# EAGLE schematic module_Rnx_ctrl (EAGLE 6.5.0)

## Sheet 1 of 21
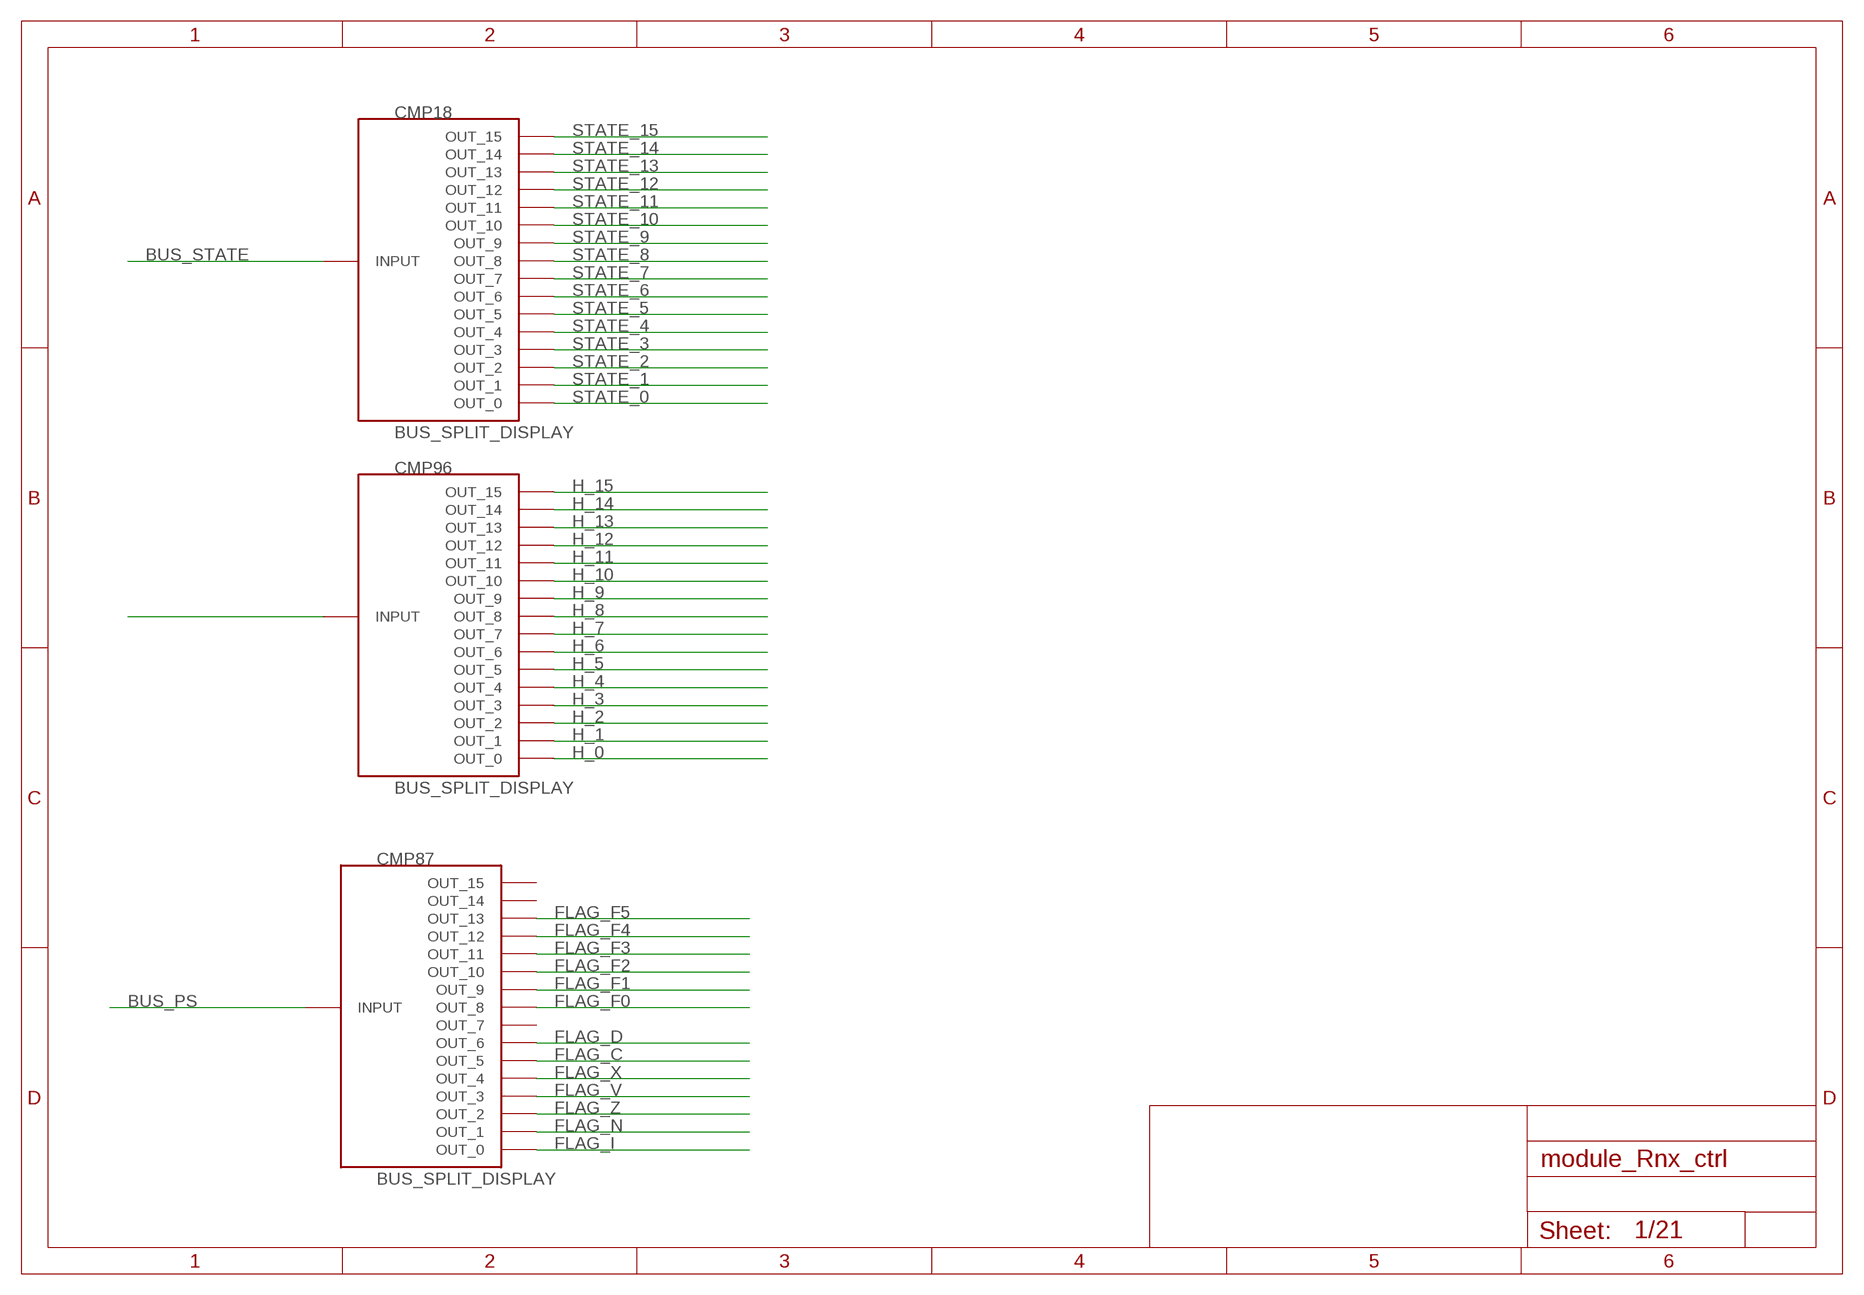
[diagram p0: schematic, sheet 1]

### Parts
CMP18  BUS_SPLIT_DISPLAY  [BUS_SPLIT_DISPLAY]
CMP87  BUS_SPLIT_DISPLAY  [BUS_SPLIT_DISPLAY]
CMP96  BUS_SPLIT_DISPLAY  [BUS_SPLIT_DISPLAY]

### Nets
BUS_H_D1: CMP96.INPUT
BUS_PS: CMP87.INPUT
BUS_STATE: CMP18.INPUT
FLAG_C: CMP87.P$6(OUT_5)
FLAG_D: CMP87.P$7(OUT_6) ; also sheet 8,19
FLAG_F0: CMP87.P$9(OUT_8) ; also sheet 7
FLAG_F1: CMP87.P$10(OUT_9)
FLAG_F2: CMP87.P$11(OUT_10)
FLAG_F3: CMP87.P$12(OUT_11)
FLAG_F4: CMP87.P$13(OUT_12)
FLAG_F5: CMP87.P$14(OUT_13)
FLAG_I: CMP87.P$1(OUT_0)
FLAG_N: CMP87.P$2(OUT_1)
FLAG_V: CMP87.P$4(OUT_3)
FLAG_X: CMP87.P$5(OUT_4)
FLAG_Z: CMP87.P$3(OUT_2)
H_0: CMP96.P$1(OUT_0) ; also sheet 6,7,17
H_1: CMP96.P$2(OUT_1) ; also sheet 6
H_2: CMP96.P$3(OUT_2)
H_3: CMP96.P$4(OUT_3)
H_4: CMP96.P$5(OUT_4)
H_5: CMP96.P$6(OUT_5)
H_6: CMP96.P$7(OUT_6)
H_7: CMP96.P$8(OUT_7)
H_8: CMP96.P$9(OUT_8)
H_9: CMP96.P$10(OUT_9)
H_10: CMP96.P$11(OUT_10)
H_11: CMP96.P$12(OUT_11)
H_12: CMP96.P$13(OUT_12)
H_13: CMP96.P$14(OUT_13)
H_14: CMP96.P$15(OUT_14)
H_15: CMP96.P$16(OUT_15)
STATE_0: CMP18.P$1(OUT_0) ; also sheet 7,9,11,14,15,16,19,20
STATE_1: CMP18.P$2(OUT_1) ; also sheet 11
STATE_2: CMP18.P$3(OUT_2)
STATE_3: CMP18.P$4(OUT_3) ; also sheet 8,12,19,20
STATE_4: CMP18.P$5(OUT_4) ; also sheet 7,11,15
STATE_5: CMP18.P$6(OUT_5) ; also sheet 11
STATE_6: CMP18.P$7(OUT_6) ; also sheet 7,14
STATE_7: CMP18.P$8(OUT_7) ; also sheet 14
STATE_8: CMP18.P$9(OUT_8) ; also sheet 15
STATE_9: CMP18.P$10(OUT_9)
STATE_10: CMP18.P$11(OUT_10) ; also sheet 7,17
STATE_11: CMP18.P$12(OUT_11) ; also sheet 4,9,12,15,20,21
STATE_12: CMP18.P$13(OUT_12) ; also sheet 7,8,12,15
STATE_13: CMP18.P$14(OUT_13) ; also sheet 4,9,19
STATE_14: CMP18.P$15(OUT_14) ; also sheet 15,17
STATE_15: CMP18.P$16(OUT_15) ; also sheet 14
Unconnected: CMP87.P$8(OUT_7) CMP87.P$15(OUT_14) CMP87.P$16(OUT_15)

## Sheet 2 of 21
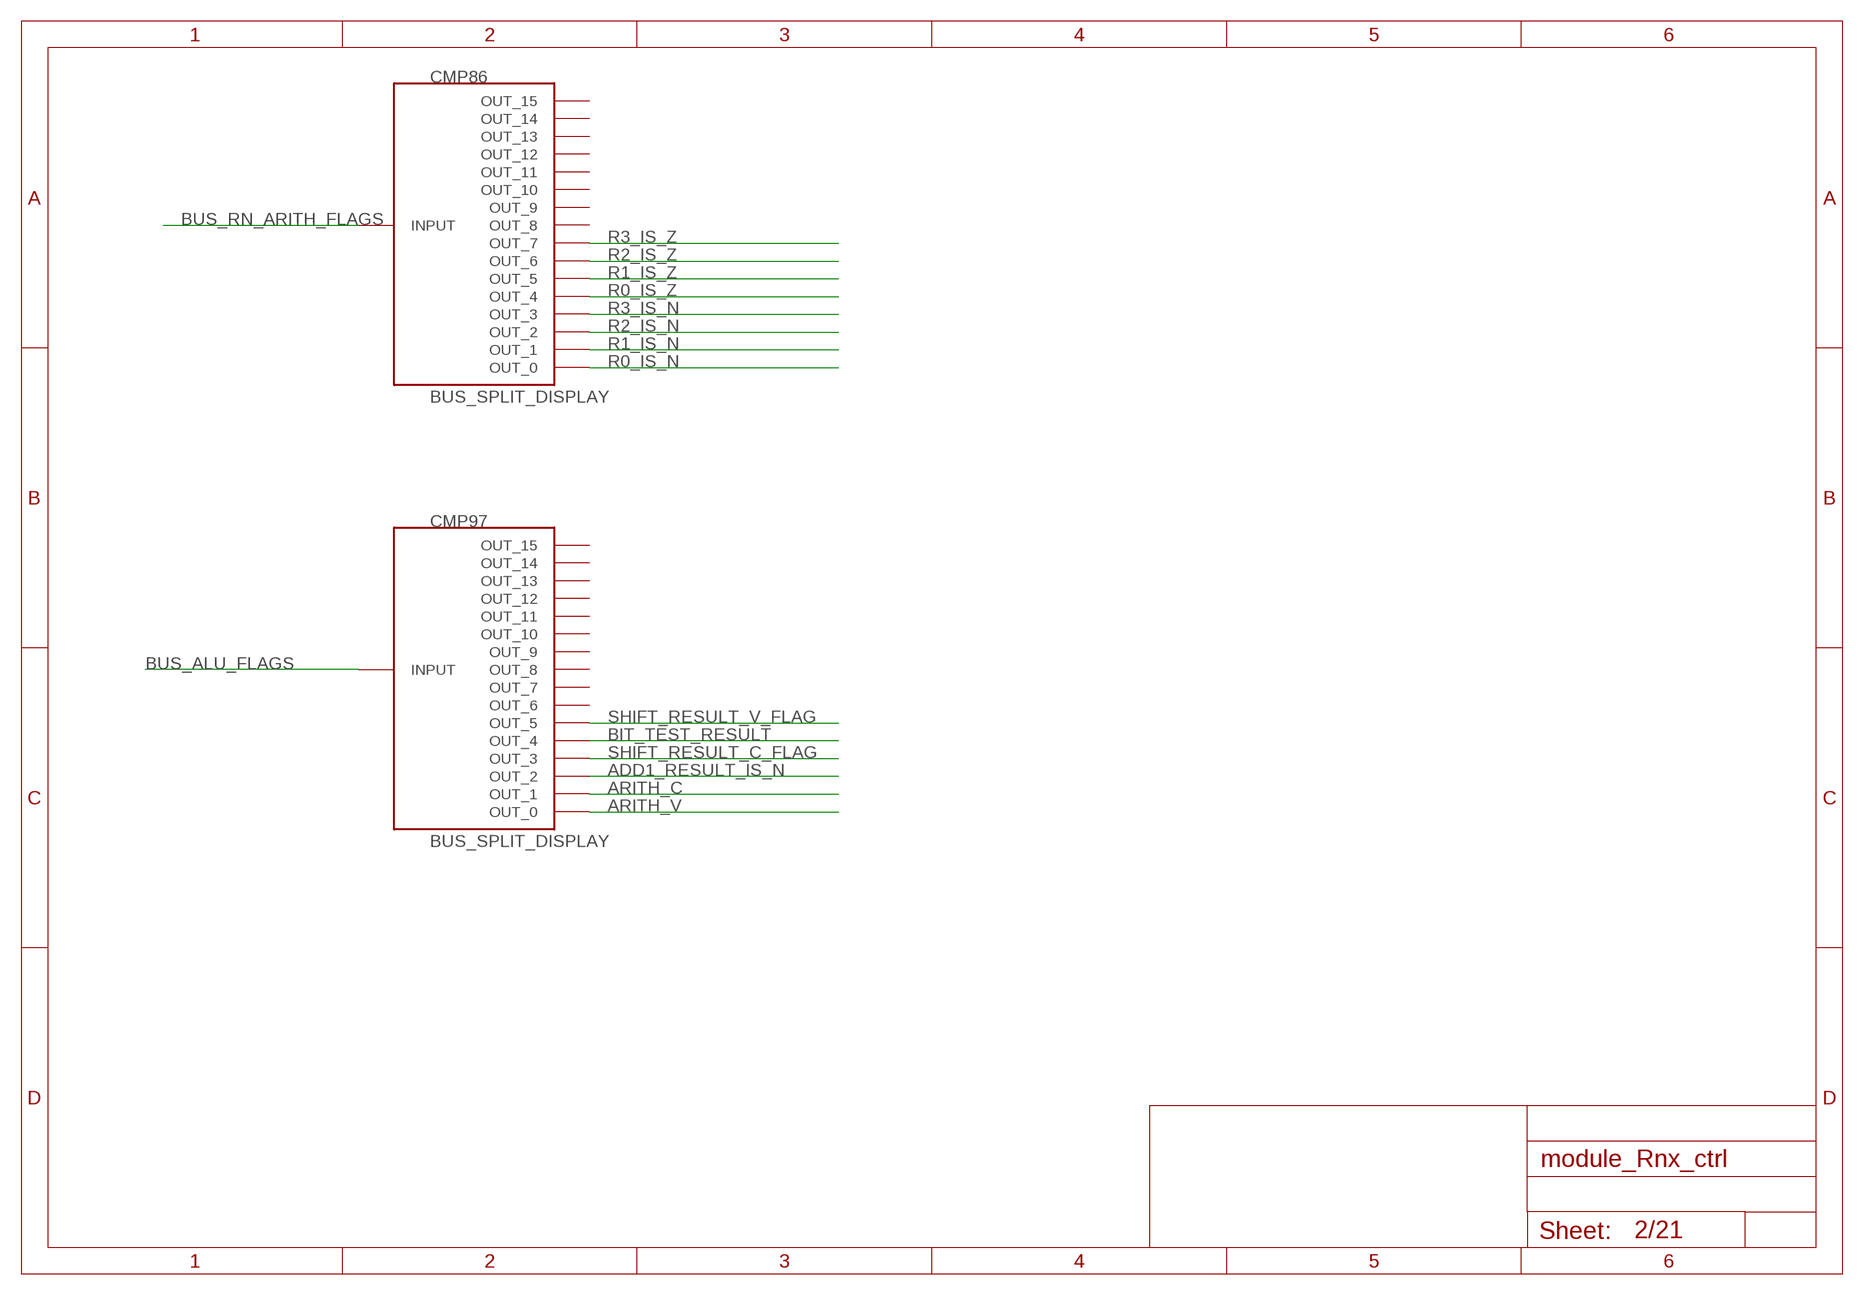
[diagram p1: schematic, sheet 2]

### Parts
CMP86  BUS_SPLIT_DISPLAY  [BUS_SPLIT_DISPLAY]
CMP97  BUS_SPLIT_DISPLAY  [BUS_SPLIT_DISPLAY]

### Nets
ADD1_RESULT_IS_N: CMP97.P$3(OUT_2) ; also sheet 17
ARITH_C: CMP97.P$2(OUT_1) ; also sheet 20,21
ARITH_V: CMP97.P$1(OUT_0)
BIT_TEST_RESULT: CMP97.P$5(OUT_4)
BUS_ALU_FLAGS: CMP97.INPUT
BUS_RN_ARITH_FLAGS: CMP86.INPUT
R0_IS_N: CMP86.P$1(OUT_0)
R0_IS_Z: CMP86.P$5(OUT_4)
R1_IS_N: CMP86.P$2(OUT_1) ; also sheet 8,17
R1_IS_Z: CMP86.P$6(OUT_5)
R2_IS_N: CMP86.P$3(OUT_2)
R2_IS_Z: CMP86.P$7(OUT_6)
R3_IS_N: CMP86.P$4(OUT_3)
R3_IS_Z: CMP86.P$8(OUT_7) ; also sheet 7
SHIFT_RESULT_C_FLAG: CMP97.P$4(OUT_3)
SHIFT_RESULT_V_FLAG: CMP97.P$6(OUT_5)
Unconnected: CMP86.P$9(OUT_8) CMP86.P$10(OUT_9) CMP86.P$11(OUT_10) CMP86.P$12(OUT_11) CMP86.P$13(OUT_12) CMP86.P$14(OUT_13) CMP86.P$15(OUT_14) CMP86.P$16(OUT_15) CMP97.P$7(OUT_6) CMP97.P$8(OUT_7) CMP97.P$9(OUT_8) CMP97.P$10(OUT_9) CMP97.P$11(OUT_10) CMP97.P$12(OUT_11) CMP97.P$13(OUT_12) CMP97.P$14(OUT_13) CMP97.P$15(OUT_14) CMP97.P$16(OUT_15)

## Sheet 3 of 21
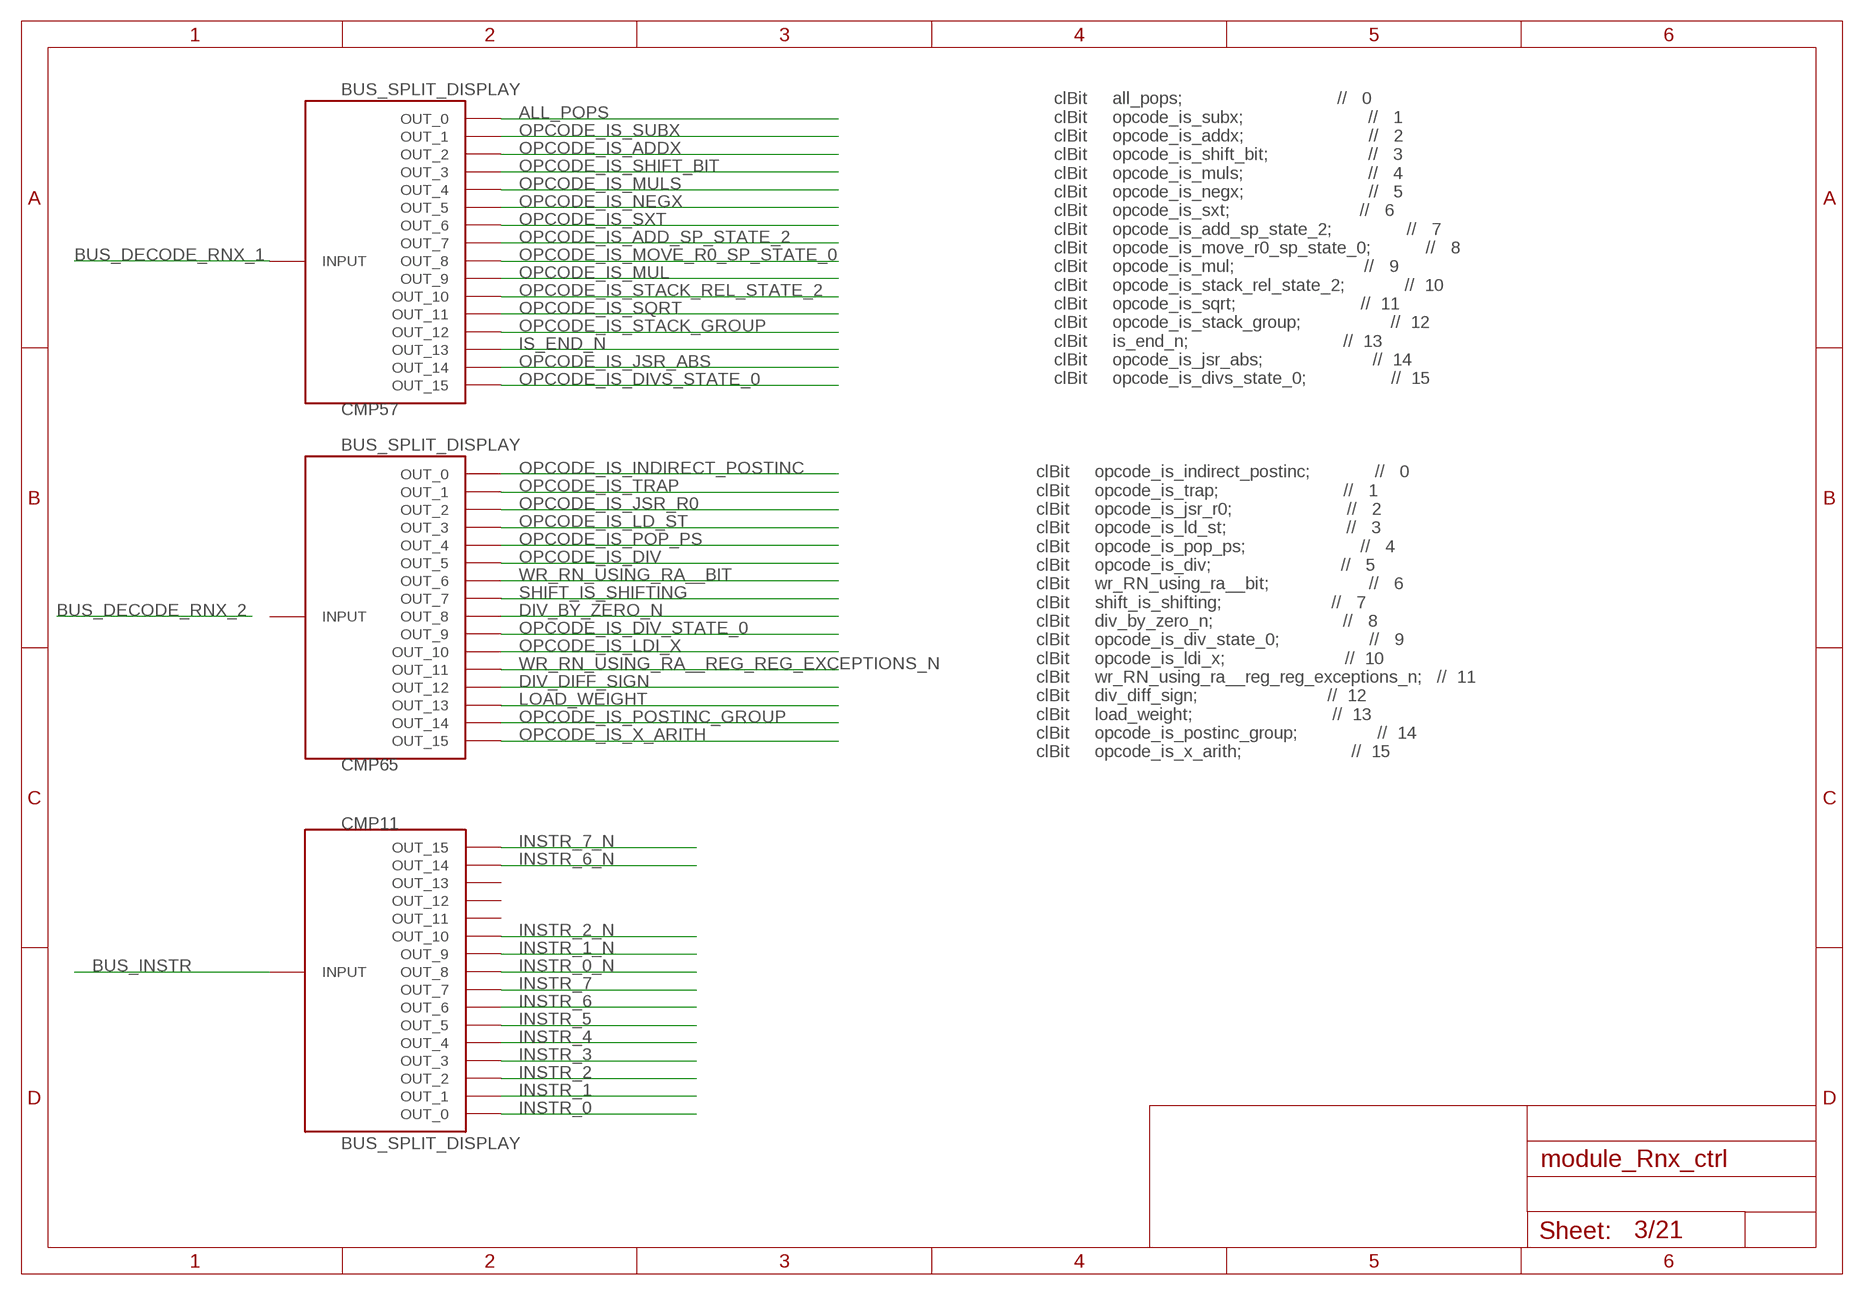
[diagram p2: schematic, sheet 3]

### Parts
CMP11  BUS_SPLIT_DISPLAY  [BUS_SPLIT_DISPLAY]
CMP57  BUS_SPLIT_DISPLAY  [BUS_SPLIT_DISPLAY]
CMP65  BUS_SPLIT_DISPLAY  [BUS_SPLIT_DISPLAY]

### Nets
ALL_POPS: CMP57.P$1(OUT_0) ; also sheet 15
BUS_DECODE_RNX_1: CMP57.INPUT
BUS_INSTR: CMP11.INPUT
DIV_BY_ZERO_N: CMP65.P$9(OUT_8) ; also sheet 19,20
DIV_DIFF_SIGN: CMP65.P$13(OUT_12) ; also sheet 19
INSTR_0: CMP11.P$1(OUT_0) ; also sheet 6,10
INSTR_0_N: CMP11.P$9(OUT_8) ; also sheet 10
INSTR_1: CMP11.P$2(OUT_1) ; also sheet 6,16,20
INSTR_1_N: CMP11.P$10(OUT_9) ; also sheet 15,19
INSTR_2: CMP11.P$3(OUT_2) ; also sheet 6,16
INSTR_2_N: CMP11.P$11(OUT_10) ; also sheet 16
INSTR_3: CMP11.P$4(OUT_3) ; also sheet 6
INSTR_4: CMP11.P$5(OUT_4)
INSTR_5: CMP11.P$6(OUT_5)
INSTR_6: CMP11.P$7(OUT_6)
INSTR_6_N: CMP11.P$15(OUT_14) ; also sheet 14
INSTR_7: CMP11.P$8(OUT_7) ; also sheet 14
INSTR_7_N: CMP11.P$16(OUT_15) ; also sheet 11,16
IS_END_N: CMP57.P$14(OUT_13) ; also sheet 14
LOAD_WEIGHT: CMP65.P$14(OUT_13) ; also sheet 18,19,20
OPCODE_IS_ADD_SP_STATE_2: CMP57.P$8(OUT_7) ; also sheet 14
OPCODE_IS_ADDX: CMP57.P$3(OUT_2) ; also sheet 9,12
OPCODE_IS_DIV: CMP65.P$6(OUT_5) ; also sheet 8,16
OPCODE_IS_DIV_STATE_0: CMP65.P$10(OUT_9) ; also sheet 19,20
OPCODE_IS_DIVS_STATE_0: CMP57.P$16(OUT_15) ; also sheet 8,12
OPCODE_IS_INDIRECT_POSTINC: CMP65.P$1(OUT_0) ; also sheet 10
OPCODE_IS_JSR_ABS: CMP57.P$15(OUT_14) ; also sheet 14
OPCODE_IS_JSR_R0: CMP65.P$3(OUT_2) ; also sheet 14
OPCODE_IS_LD_ST: CMP65.P$4(OUT_3) ; also sheet 11,16
OPCODE_IS_LDI_X: CMP65.P$11(OUT_10) ; also sheet 11
OPCODE_IS_MOVE_R0_SP_STATE_0: CMP57.P$9(OUT_8) ; also sheet 14,18
OPCODE_IS_MUL: CMP57.P$10(OUT_9) ; also sheet 9,16,19,20
OPCODE_IS_MULS: CMP57.P$5(OUT_4) ; also sheet 12
OPCODE_IS_NEGX: CMP57.P$6(OUT_5) ; also sheet 12
OPCODE_IS_POP_PS: CMP65.P$5(OUT_4) ; also sheet 16
OPCODE_IS_POSTINC_GROUP: CMP65.P$15(OUT_14) ; also sheet 16
OPCODE_IS_SHIFT_BIT: CMP57.P$4(OUT_3) ; also sheet 6,12,16
OPCODE_IS_SQRT: CMP57.P$12(OUT_11) ; also sheet 7,9,12,16,20
OPCODE_IS_STACK_GROUP: CMP57.P$13(OUT_12) ; also sheet 14
OPCODE_IS_STACK_REL_STATE_2: CMP57.P$11(OUT_10) ; also sheet 14
OPCODE_IS_SUBX: CMP57.P$2(OUT_1) ; also sheet 9,12
OPCODE_IS_SXT: CMP57.P$7(OUT_6) ; also sheet 4,16
OPCODE_IS_TRAP: CMP65.P$2(OUT_1) ; also sheet 14
OPCODE_IS_X_ARITH: CMP65.P$16(OUT_15) ; also sheet 16,18
SHIFT_IS_SHIFTING: CMP65.P$8(OUT_7) ; also sheet 11
WR_RN_USING_RA__BIT: CMP65.P$7(OUT_6) ; also sheet 11
WR_RN_USING_RA__REG_REG_EXCEPTIONS_N: CMP65.P$12(OUT_11) ; also sheet 11
Unconnected: CMP11.P$12(OUT_11) CMP11.P$13(OUT_12) CMP11.P$14(OUT_13) CMP65.INPUT

### Notes on the sheet
- clBit     all_pops;                               //   0
      clBit     opcode_is_subx;                         //   1
      clBit     opcode_is_addx;                         //   2
      clBit     opcode_is_shift_bit;                    //   3
      clBit     opcode_is_muls;                         //   4
      clBit     opcode_is_negx;                         //   5
      clBit     opcode_is_sxt;                          //   6
      clBit     opcode_is_add_sp_state_2;               //   7
      clBit     opcode_is_move_r0_sp_state_0;           //   8
      clBit     opcode_is_mul;                          //   9
      clBit     opcode_is_stack_rel_state_2;            //  10
      clBit     opcode_is_sqrt;                         //  11
      clBit     opcode_is_stack_group;                  //  12
      clBit     is_end_n;                               //  13
      clBit     opcode_is_jsr_abs;                      //  14
      clBit     opcode_is_divs_state_0;                 //  15
- clBit     opcode_is_indirect_postinc;             //   0
      clBit     opcode_is_trap;                         //   1
      clBit     opcode_is_jsr_r0;                       //   2
      clBit     opcode_is_ld_st;                        //   3
      clBit     opcode_is_pop_ps;                       //   4
      clBit     opcode_is_div;                          //   5
      clBit     wr_RN_using_ra__bit;                    //   6
      clBit     shift_is_shifting;                      //   7
      clBit     div_by_zero_n;                          //   8
      clBit     opcode_is_div_state_0;                  //   9
      clBit     opcode_is_ldi_x;                        //  10
      clBit     wr_RN_using_ra__reg_reg_exceptions_n;   //  11
      clBit     div_diff_sign;                          //  12
      clBit     load_weight;                            //  13
      clBit     opcode_is_postinc_group;                //  14
      clBit     opcode_is_x_arith;                      //  15

## Sheet 4 of 21
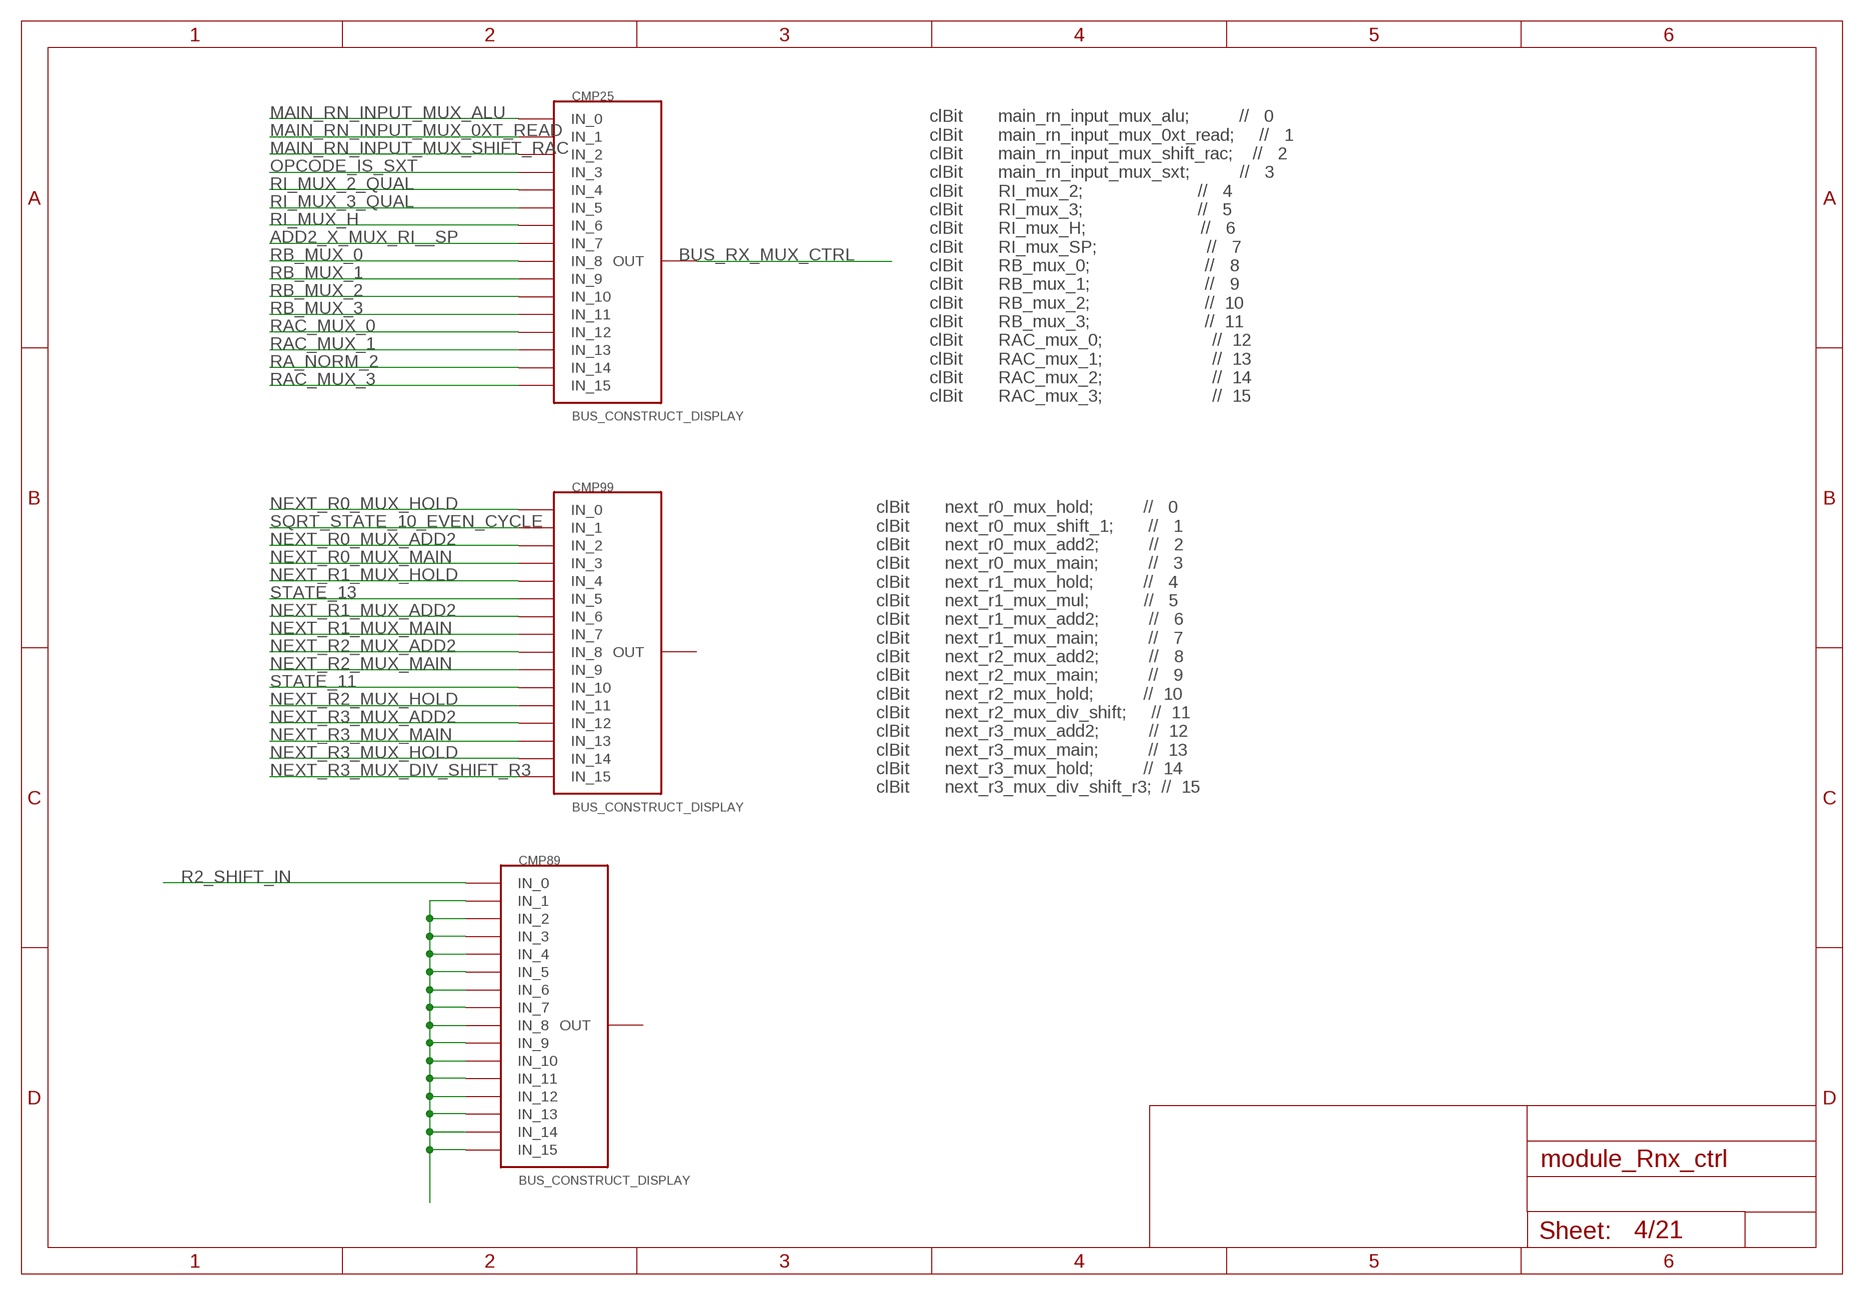
[diagram p3: schematic, sheet 4]

### Parts
CMP25  BUS_CONSTRUCT_DISPLAY  [BUS_SPLIT_DISPLAY]
CMP89  BUS_CONSTRUCT_DISPLAY  [BUS_SPLIT_DISPLAY]
CMP99  BUS_CONSTRUCT_DISPLAY  [BUS_SPLIT_DISPLAY]

### Nets
ADD2_X_MUX_RI__SP: CMP25.P$8(IN_7) ; also sheet 5,14,15
BUS_RX_MUX_CTRL: CMP25.INPUT(OUT)
MAIN_RN_INPUT_MUX_0XT_READ: CMP25.P$2(IN_1) ; also sheet 16
MAIN_RN_INPUT_MUX_ALU: CMP25.P$1(IN_0) ; also sheet 16
MAIN_RN_INPUT_MUX_SHIFT_RAC: CMP25.P$3(IN_2) ; also sheet 16
N$3: CMP89.P$2(IN_1) CMP89.P$3(IN_2) CMP89.P$4(IN_3) CMP89.P$5(IN_4) CMP89.P$6(IN_5) CMP89.P$7(IN_6) CMP89.P$8(IN_7) CMP89.P$9(IN_8) CMP89.P$10(IN_9) CMP89.P$11(IN_10) CMP89.P$12(IN_11) CMP89.P$13(IN_12) CMP89.P$14(IN_13) CMP89.P$15(IN_14) CMP89.P$16(IN_15)
NEXT_R0_MUX_ADD2: CMP99.P$3(IN_2) ; also sheet 18
NEXT_R0_MUX_HOLD: CMP99.P$1(IN_0) ; also sheet 18
NEXT_R0_MUX_MAIN: CMP99.P$4(IN_3) ; also sheet 18
NEXT_R1_MUX_ADD2: CMP99.P$7(IN_6) ; also sheet 18,19
NEXT_R1_MUX_HOLD: CMP99.P$5(IN_4) ; also sheet 19
NEXT_R1_MUX_MAIN: CMP99.P$8(IN_7) ; also sheet 18,19
NEXT_R2_MUX_ADD2: CMP99.P$9(IN_8) ; also sheet 19,20
NEXT_R2_MUX_HOLD: CMP99.P$12(IN_11) ; also sheet 20
NEXT_R2_MUX_MAIN: CMP99.P$10(IN_9) ; also sheet 19,20
NEXT_R3_MUX_ADD2: CMP99.P$13(IN_12) ; also sheet 21
NEXT_R3_MUX_DIV_SHIFT_R3: CMP99.P$16(IN_15) ; also sheet 21
NEXT_R3_MUX_HOLD: CMP99.P$15(IN_14) ; also sheet 21
NEXT_R3_MUX_MAIN: CMP99.P$14(IN_13) ; also sheet 20,21
OPCODE_IS_SXT: CMP25.P$4(IN_3) ; also sheet 3,16
R2_SHIFT_IN: CMP89.P$1(IN_0) ; also sheet 21
RA_NORM_2: CMP25.P$15(IN_14) ; also sheet 6,19
RAC_MUX_0: CMP25.P$13(IN_12) ; also sheet 10,18
RAC_MUX_1: CMP25.P$14(IN_13) ; also sheet 10,18
RAC_MUX_3: CMP25.P$16(IN_15) ; also sheet 10,20
RB_MUX_0: CMP25.P$9(IN_8) ; also sheet 13
RB_MUX_1: CMP25.P$10(IN_9) ; also sheet 13
RB_MUX_2: CMP25.P$11(IN_10) ; also sheet 13
RB_MUX_3: CMP25.P$12(IN_11) ; also sheet 13
RI_MUX_2_QUAL: CMP25.P$5(IN_4) ; also sheet 15
RI_MUX_3_QUAL: CMP25.P$6(IN_5) ; also sheet 16
RI_MUX_H: CMP25.P$7(IN_6) ; also sheet 15
SQRT_STATE_10_EVEN_CYCLE: CMP99.P$2(IN_1) ; also sheet 7,18,21
STATE_11: CMP99.P$11(IN_10) ; also sheet 1,9,12,15,20,21
STATE_13: CMP99.P$6(IN_5) ; also sheet 1,9,19
Unconnected: CMP89.INPUT(OUT) CMP99.INPUT(OUT)

### Notes on the sheet
- clBit       main_rn_input_mux_alu;          //   0
      clBit       main_rn_input_mux_0xt_read;     //   1
      clBit       main_rn_input_mux_shift_rac;    //   2
      clBit       main_rn_input_mux_sxt;          //   3
      clBit       RI_mux_2;                       //   4
      clBit       RI_mux_3;                       //   5
      clBit       RI_mux_H;                       //   6
      clBit       RI_mux_SP;                      //   7
      clBit       RB_mux_0;                       //   8
      clBit       RB_mux_1;                       //   9
      clBit       RB_mux_2;                       //  10
      clBit       RB_mux_3;                       //  11
      clBit       RAC_mux_0;                      //  12
      clBit       RAC_mux_1;                      //  13
      clBit       RAC_mux_2;                      //  14
      clBit       RAC_mux_3;                      //  15
- clBit       next_r0_mux_hold;          //   0
      clBit       next_r0_mux_shift_1;       //   1
      clBit       next_r0_mux_add2;          //   2
      clBit       next_r0_mux_main;          //   3
      clBit       next_r1_mux_hold;          //   4
      clBit       next_r1_mux_mul;           //   5
      clBit       next_r1_mux_add2;          //   6
      clBit       next_r1_mux_main;          //   7
      clBit       next_r2_mux_add2;          //   8
      clBit       next_r2_mux_main;          //   9
      clBit       next_r2_mux_hold;          //  10
      clBit       next_r2_mux_div_shift;     //  11
      clBit       next_r3_mux_add2;          //  12
      clBit       next_r3_mux_main;          //  13
      clBit       next_r3_mux_hold;          //  14
      clBit       next_r3_mux_div_shift_r3;  //  15

## Sheet 5 of 21
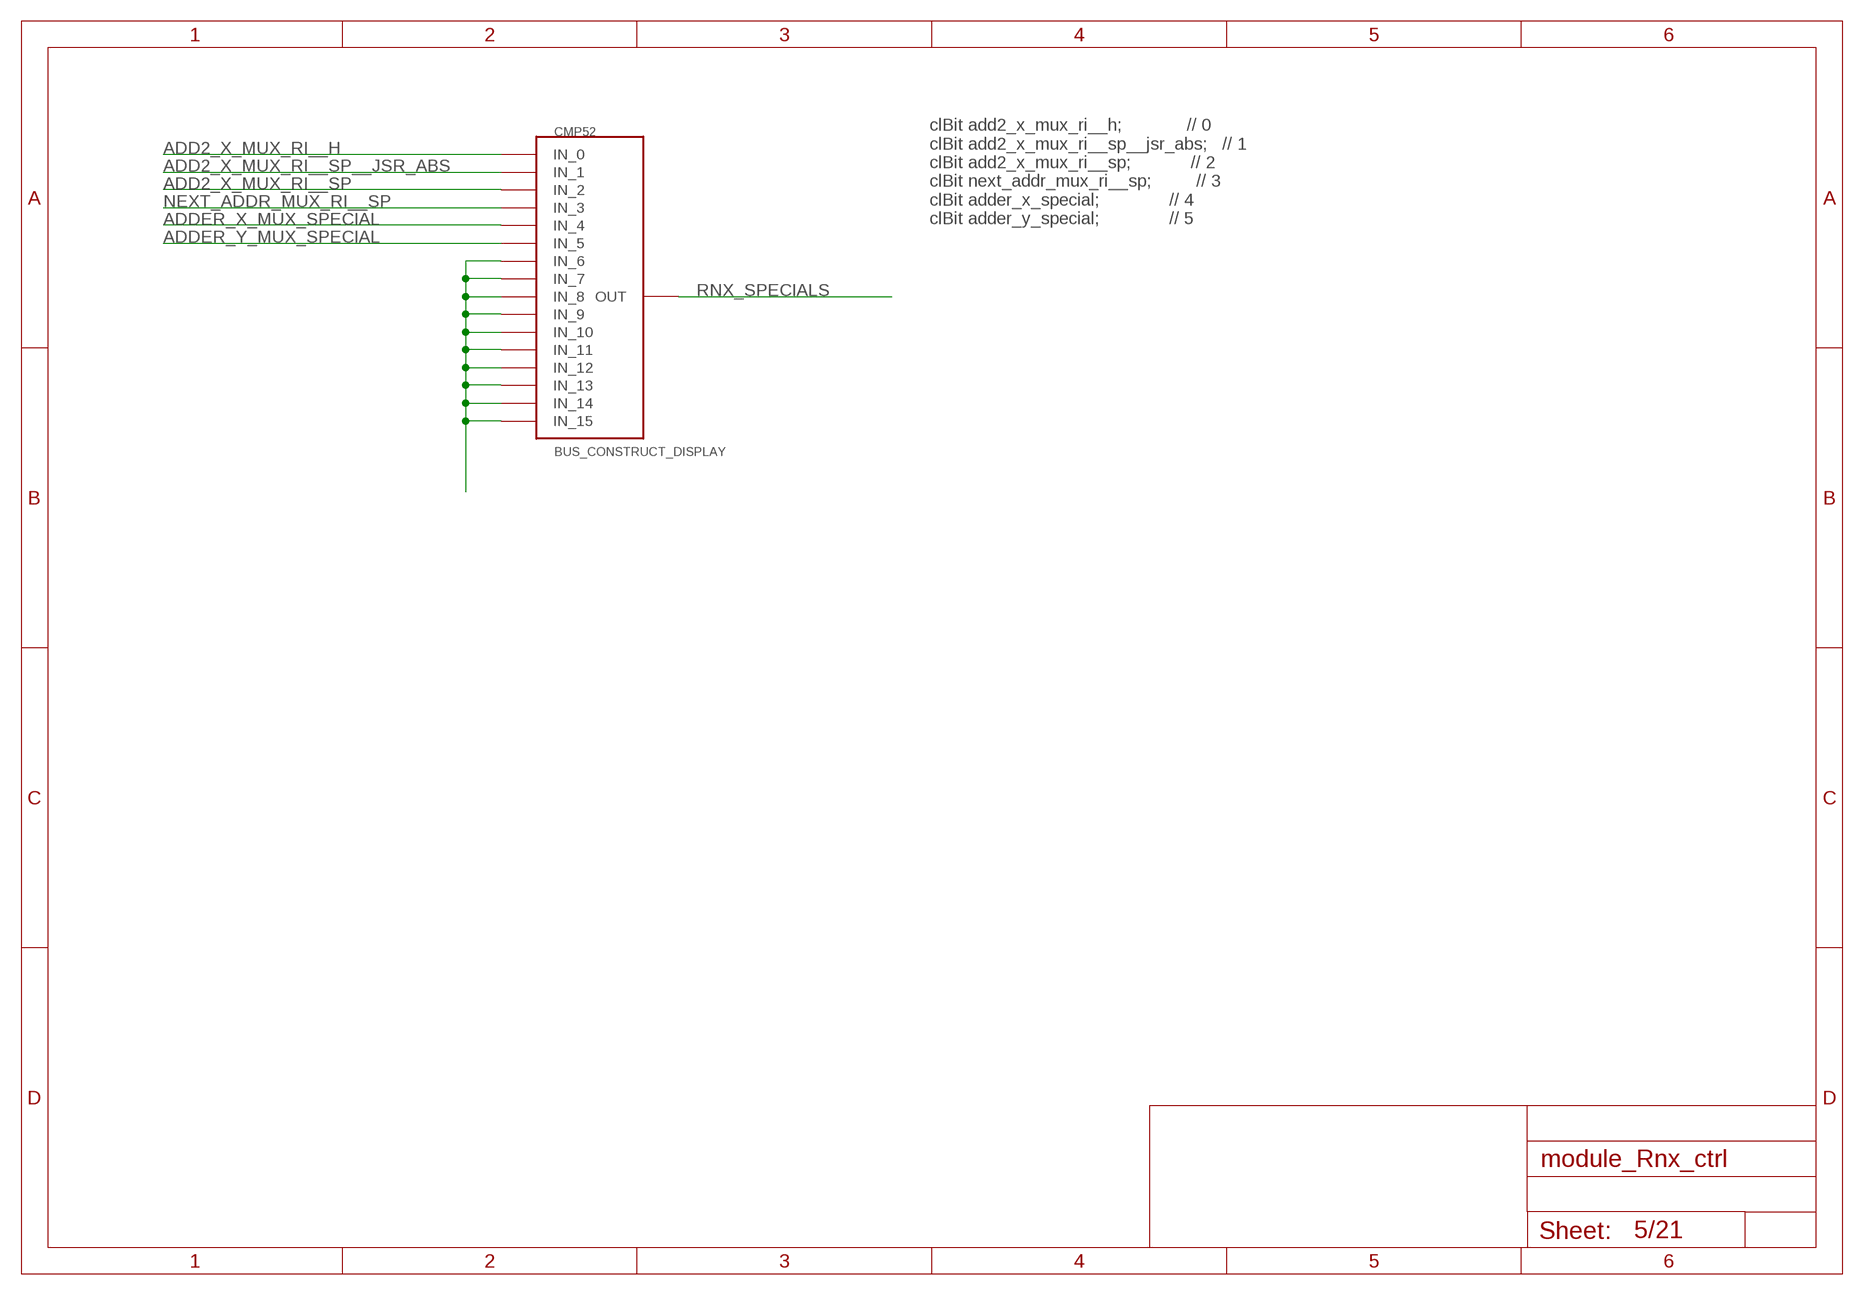
[diagram p4: schematic, sheet 5]

### Parts
CMP52  BUS_CONSTRUCT_DISPLAY  [BUS_SPLIT_DISPLAY]

### Nets
ADD2_X_MUX_RI__H: CMP52.P$1(IN_0) ; also sheet 14,15
ADD2_X_MUX_RI__SP: CMP52.P$3(IN_2) ; also sheet 4,14,15
ADD2_X_MUX_RI__SP__JSR_ABS: CMP52.P$2(IN_1) ; also sheet 14
ADDER_X_MUX_SPECIAL: CMP52.P$5(IN_4) ; also sheet 9,10
ADDER_Y_MUX_SPECIAL: CMP52.P$6(IN_5) ; also sheet 12
N$2: CMP52.P$7(IN_6) CMP52.P$8(IN_7) CMP52.P$9(IN_8) CMP52.P$10(IN_9) CMP52.P$11(IN_10) CMP52.P$12(IN_11) CMP52.P$13(IN_12) CMP52.P$14(IN_13) CMP52.P$15(IN_14) CMP52.P$16(IN_15)
NEXT_ADDR_MUX_RI__SP: CMP52.P$4(IN_3) ; also sheet 15
RNX_SPECIALS: CMP52.INPUT(OUT)

### Notes on the sheet
- clBit add2_x_mux_ri__h;             // 0
      clBit add2_x_mux_ri__sp__jsr_abs;   // 1
      clBit add2_x_mux_ri__sp;            // 2
      clBit next_addr_mux_ri__sp;         // 3
      clBit adder_x_special;              // 4
      clBit adder_y_special;              // 5

## Sheet 6 of 21
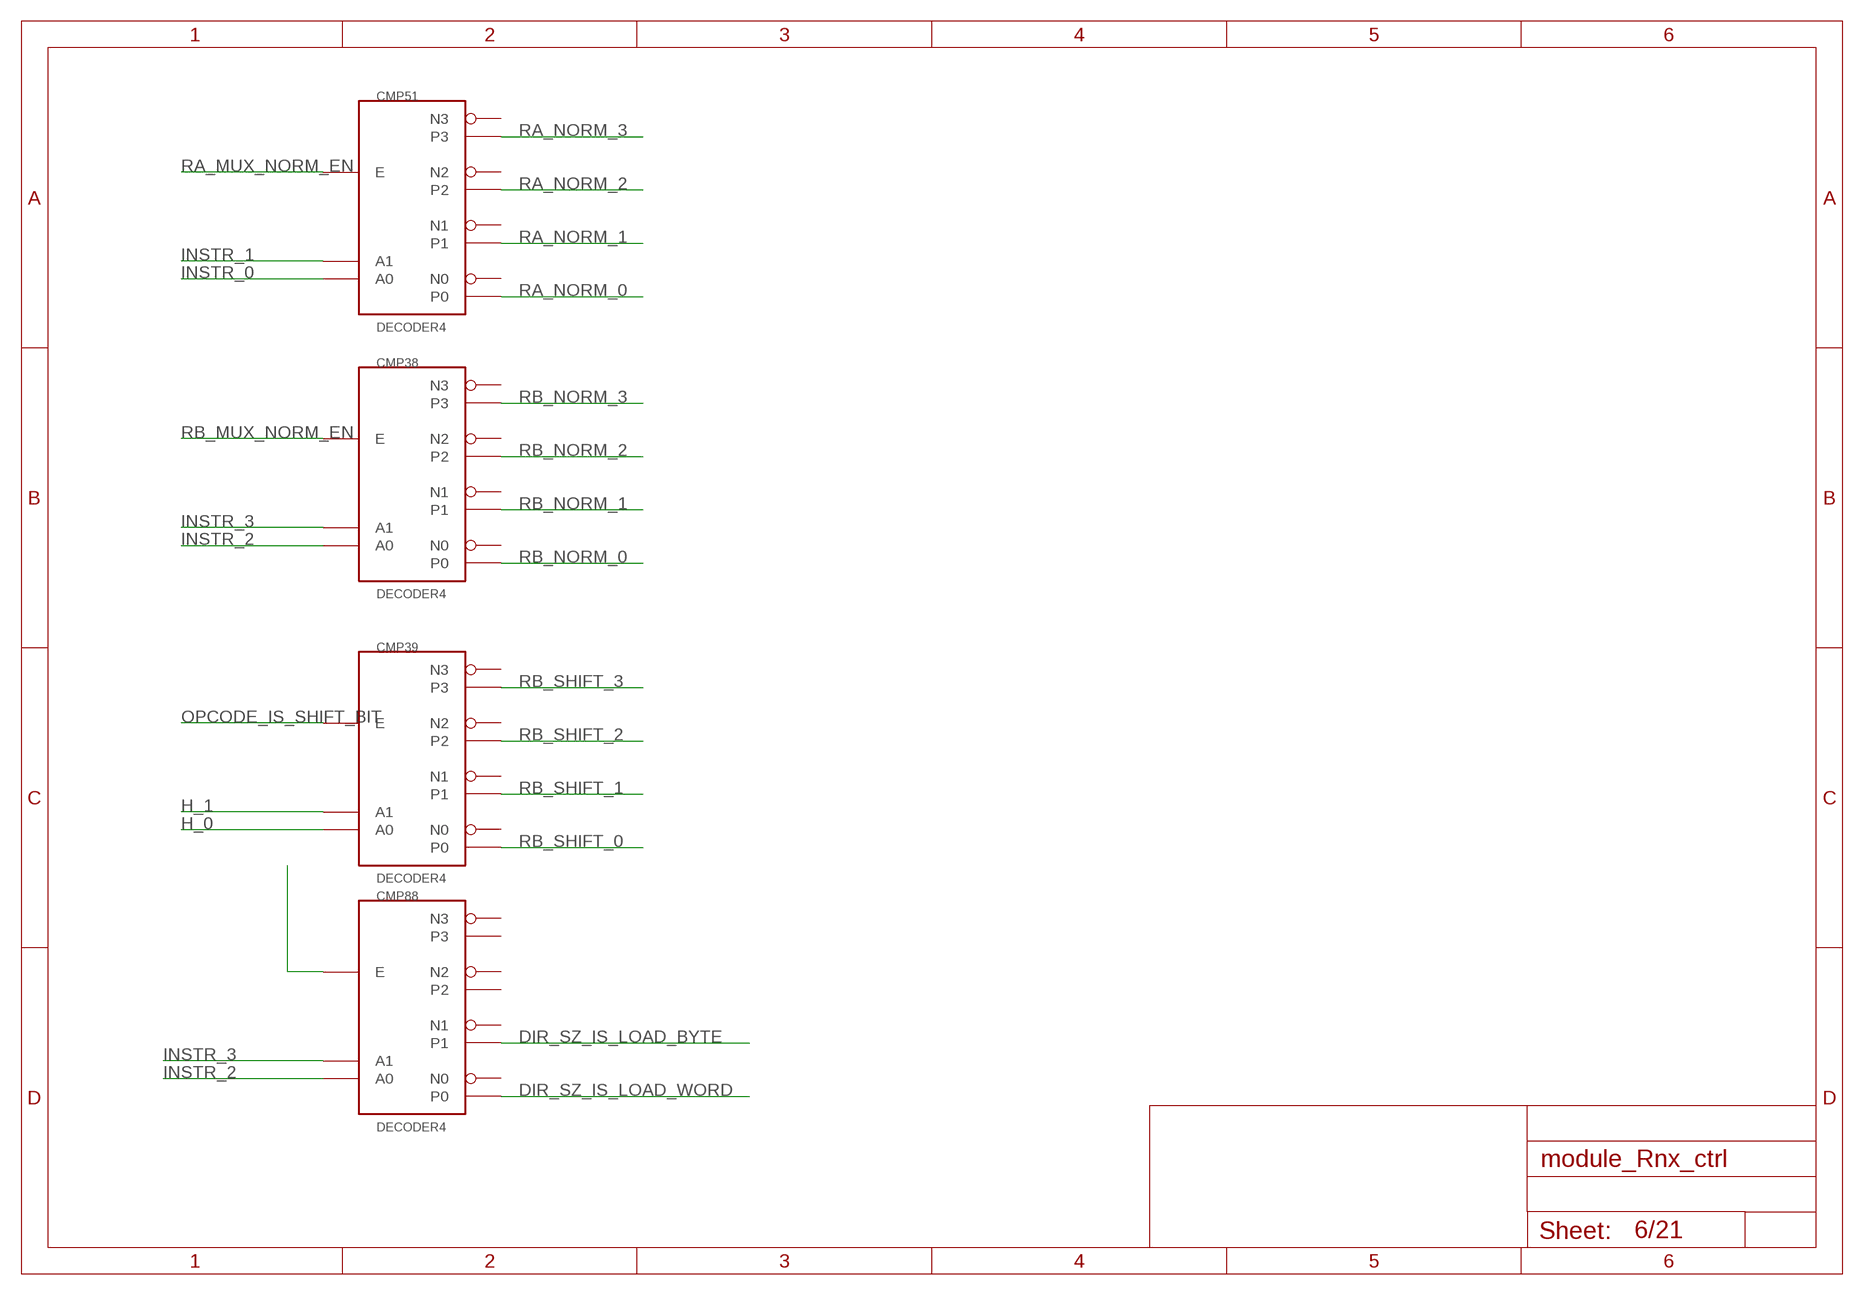
[diagram p5: schematic, sheet 6]

### Parts
CMP38  DECODER4  [DECODER4]
CMP39  DECODER4  [DECODER4]
CMP51  DECODER4  [DECODER4]
CMP88  DECODER4  [DECODER4]

### Nets
DIR_SZ_IS_LOAD_BYTE: CMP88.P1 ; also sheet 16
DIR_SZ_IS_LOAD_WORD: CMP88.P0 ; also sheet 16
H_0: CMP39.A0 ; also sheet 1,7,17
H_1: CMP39.A1 ; also sheet 1
INSTR_0: CMP51.A0 ; also sheet 3,10
INSTR_1: CMP51.A1 ; also sheet 3,16,20
INSTR_2: CMP38.A0 CMP88.A0 ; also sheet 3,16
INSTR_3: CMP38.A1 CMP88.A1 ; also sheet 3
N$1: CMP88.E
OPCODE_IS_SHIFT_BIT: CMP39.E ; also sheet 3,12,16
RA_MUX_NORM_EN: CMP51.E ; also sheet 10
RA_NORM_0: CMP51.P0 ; also sheet 10
RA_NORM_1: CMP51.P1 ; also sheet 10
RA_NORM_2: CMP51.P2 ; also sheet 4,19
RA_NORM_3: CMP51.P3 ; also sheet 10
RB_MUX_NORM_EN: CMP38.E ; also sheet 12
RB_NORM_0: CMP38.P0 ; also sheet 13
RB_NORM_1: CMP38.P1 ; also sheet 13
RB_NORM_2: CMP38.P2 ; also sheet 13
RB_NORM_3: CMP38.P3 ; also sheet 13
RB_SHIFT_0: CMP39.P0 ; also sheet 13
RB_SHIFT_1: CMP39.P1 ; also sheet 13
RB_SHIFT_2: CMP39.P2 ; also sheet 13
RB_SHIFT_3: CMP39.P3 ; also sheet 13
Unconnected: CMP38.N0 CMP38.N1 CMP38.N2 CMP38.N3 CMP39.N0 CMP39.N1 CMP39.N2 CMP39.N3 CMP51.N0 CMP51.N1 CMP51.N2 CMP51.N3 CMP88.N0 CMP88.N1 CMP88.N2 CMP88.N3 CMP88.P2 CMP88.P3

## Sheet 7 of 21
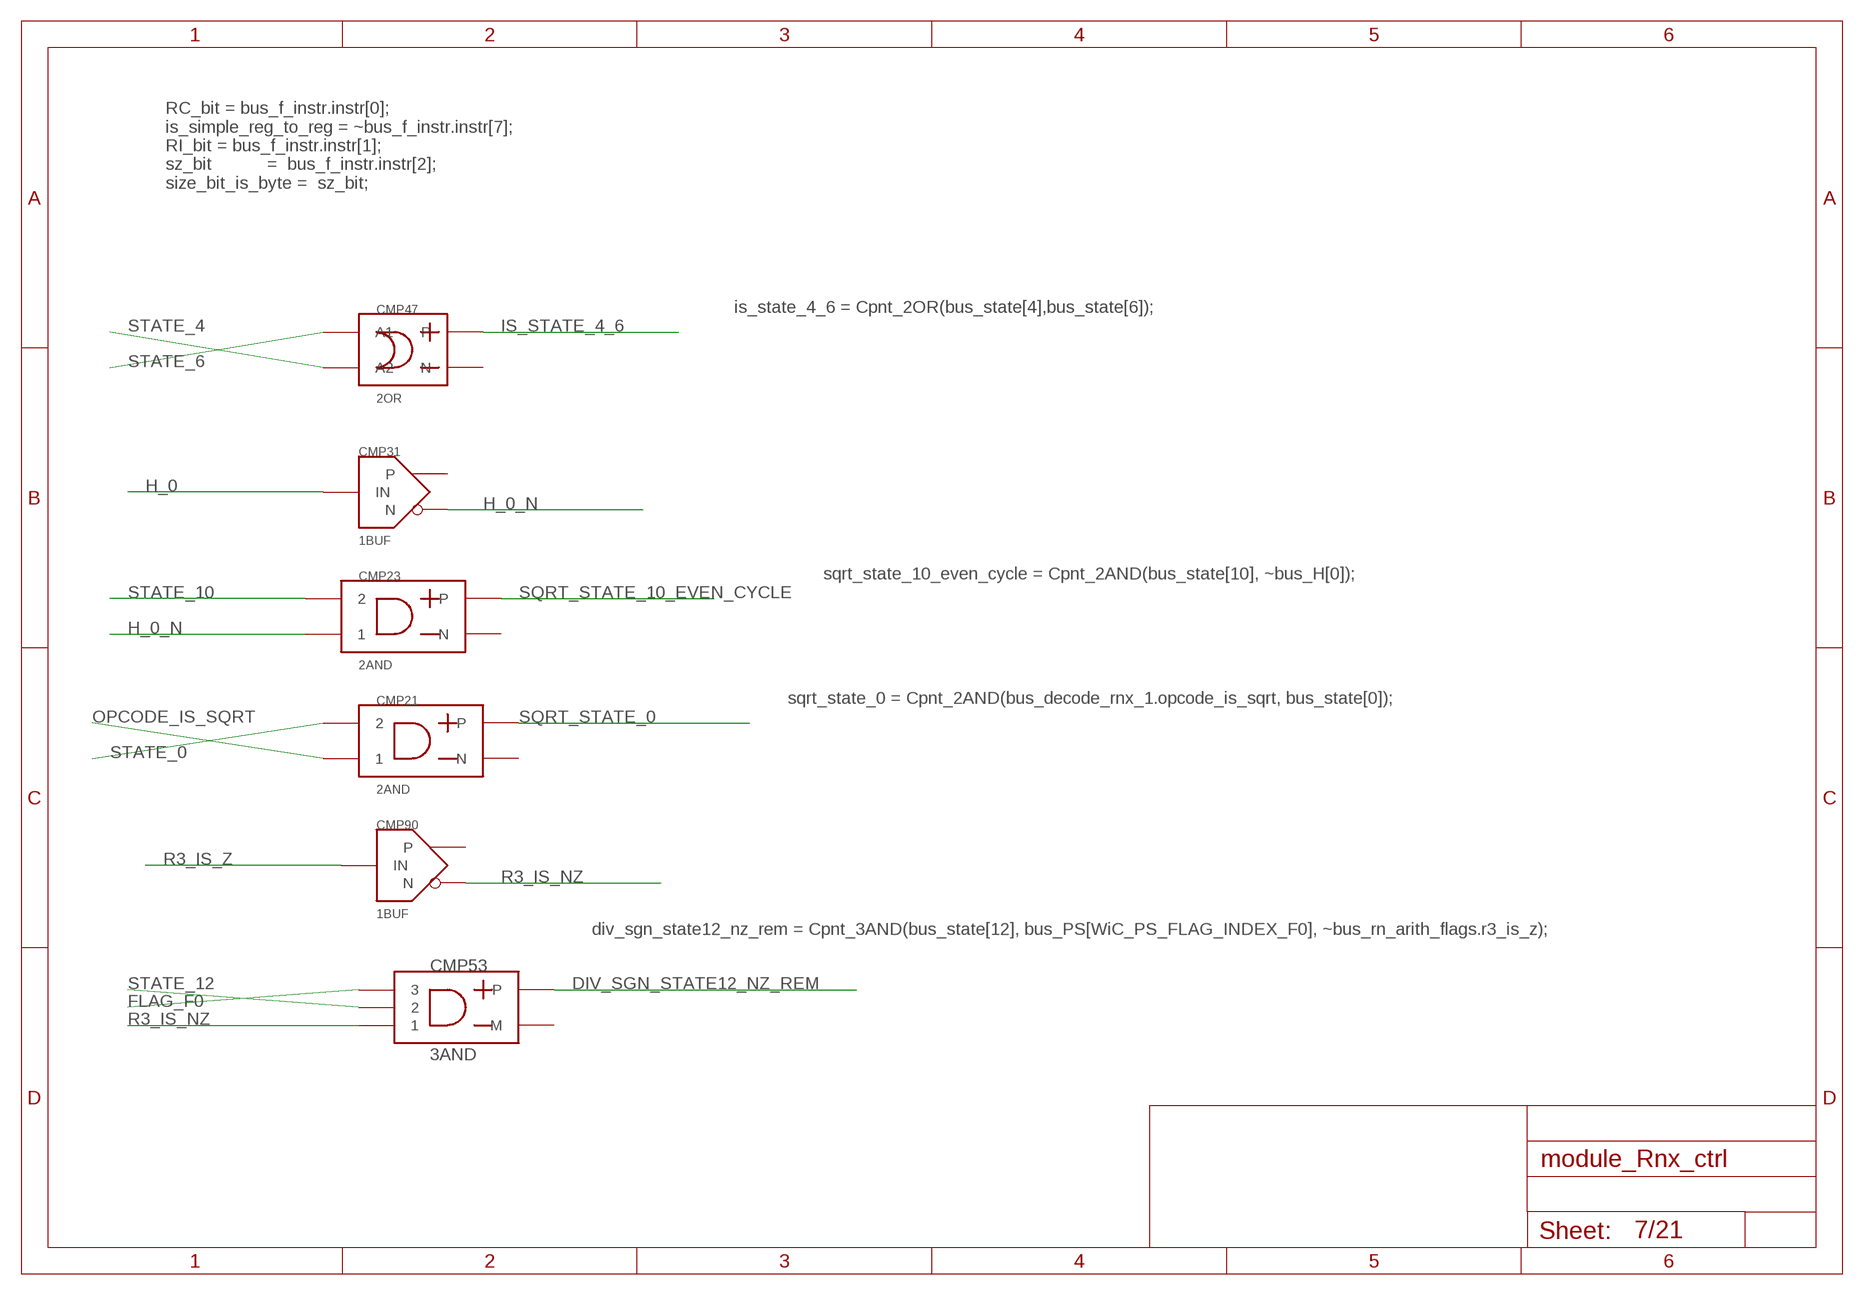
[diagram p6: schematic, sheet 7]

### Parts
CMP21  2AND  [2AND]
CMP23  2AND  [2AND]
CMP31  1BUF  [1BUF]
CMP47  2OR  [2OR]
CMP53  3AND  [3AND]
CMP90  1BUF  [1BUF]

### Nets
DIV_SGN_STATE12_NZ_REM: CMP53.OUT_P(P) ; also sheet 19,20
FLAG_F0: CMP53.P$3 ; also sheet 1
H_0: CMP31.IN ; also sheet 1,6,17
H_0_N: CMP23.P$1 CMP31.N
IS_STATE_4_6: CMP47.OUT_P(P) ; also sheet 14,16
OPCODE_IS_SQRT: CMP21.P$1 ; also sheet 3,9,12,16,20
R3_IS_NZ: CMP53.P$1 CMP90.N
R3_IS_Z: CMP90.IN ; also sheet 2
SQRT_STATE_0: CMP21.OUT_P(P) ; also sheet 18
SQRT_STATE_10_EVEN_CYCLE: CMP23.OUT_P(P) ; also sheet 4,18,21
STATE_0: CMP21.P$2 ; also sheet 1,9,11,14,15,16,19,20
STATE_4: CMP47.P$1(A2) ; also sheet 1,11,15
STATE_6: CMP47.P$2(A1) ; also sheet 1,14
STATE_10: CMP23.P$2 ; also sheet 1,17
STATE_12: CMP53.P$2 ; also sheet 1,8,12,15
Unconnected: CMP21.OUT_M(N) CMP23.OUT_M(N) CMP31.P CMP47.OUT_M(N) CMP53.OUT_M(M) CMP90.P

### Notes on the sheet
- RC_bit = bus_f_instr.instr[0];
      is_simple_reg_to_reg = ~bus_f_instr.instr[7];
      RI_bit = bus_f_instr.instr[1];
      sz_bit           =  bus_f_instr.instr[2];
      size_bit_is_byte =  sz_bit;
- is_state_4_6 = Cpnt_2OR(bus_state[4],bus_state[6]);
- sqrt_state_10_even_cycle = Cpnt_2AND(bus_state[10], ~bus_H[0]);
- sqrt_state_0 = Cpnt_2AND(bus_decode_rnx_1.opcode_is_sqrt, bus_state[0]);
- div_sgn_state12_nz_rem = Cpnt_3AND(bus_state[12], bus_PS[WiC_PS_FLAG_INDEX_F0], ~bus_rn_arith_flags.r3_is_z);

## Sheet 8 of 21
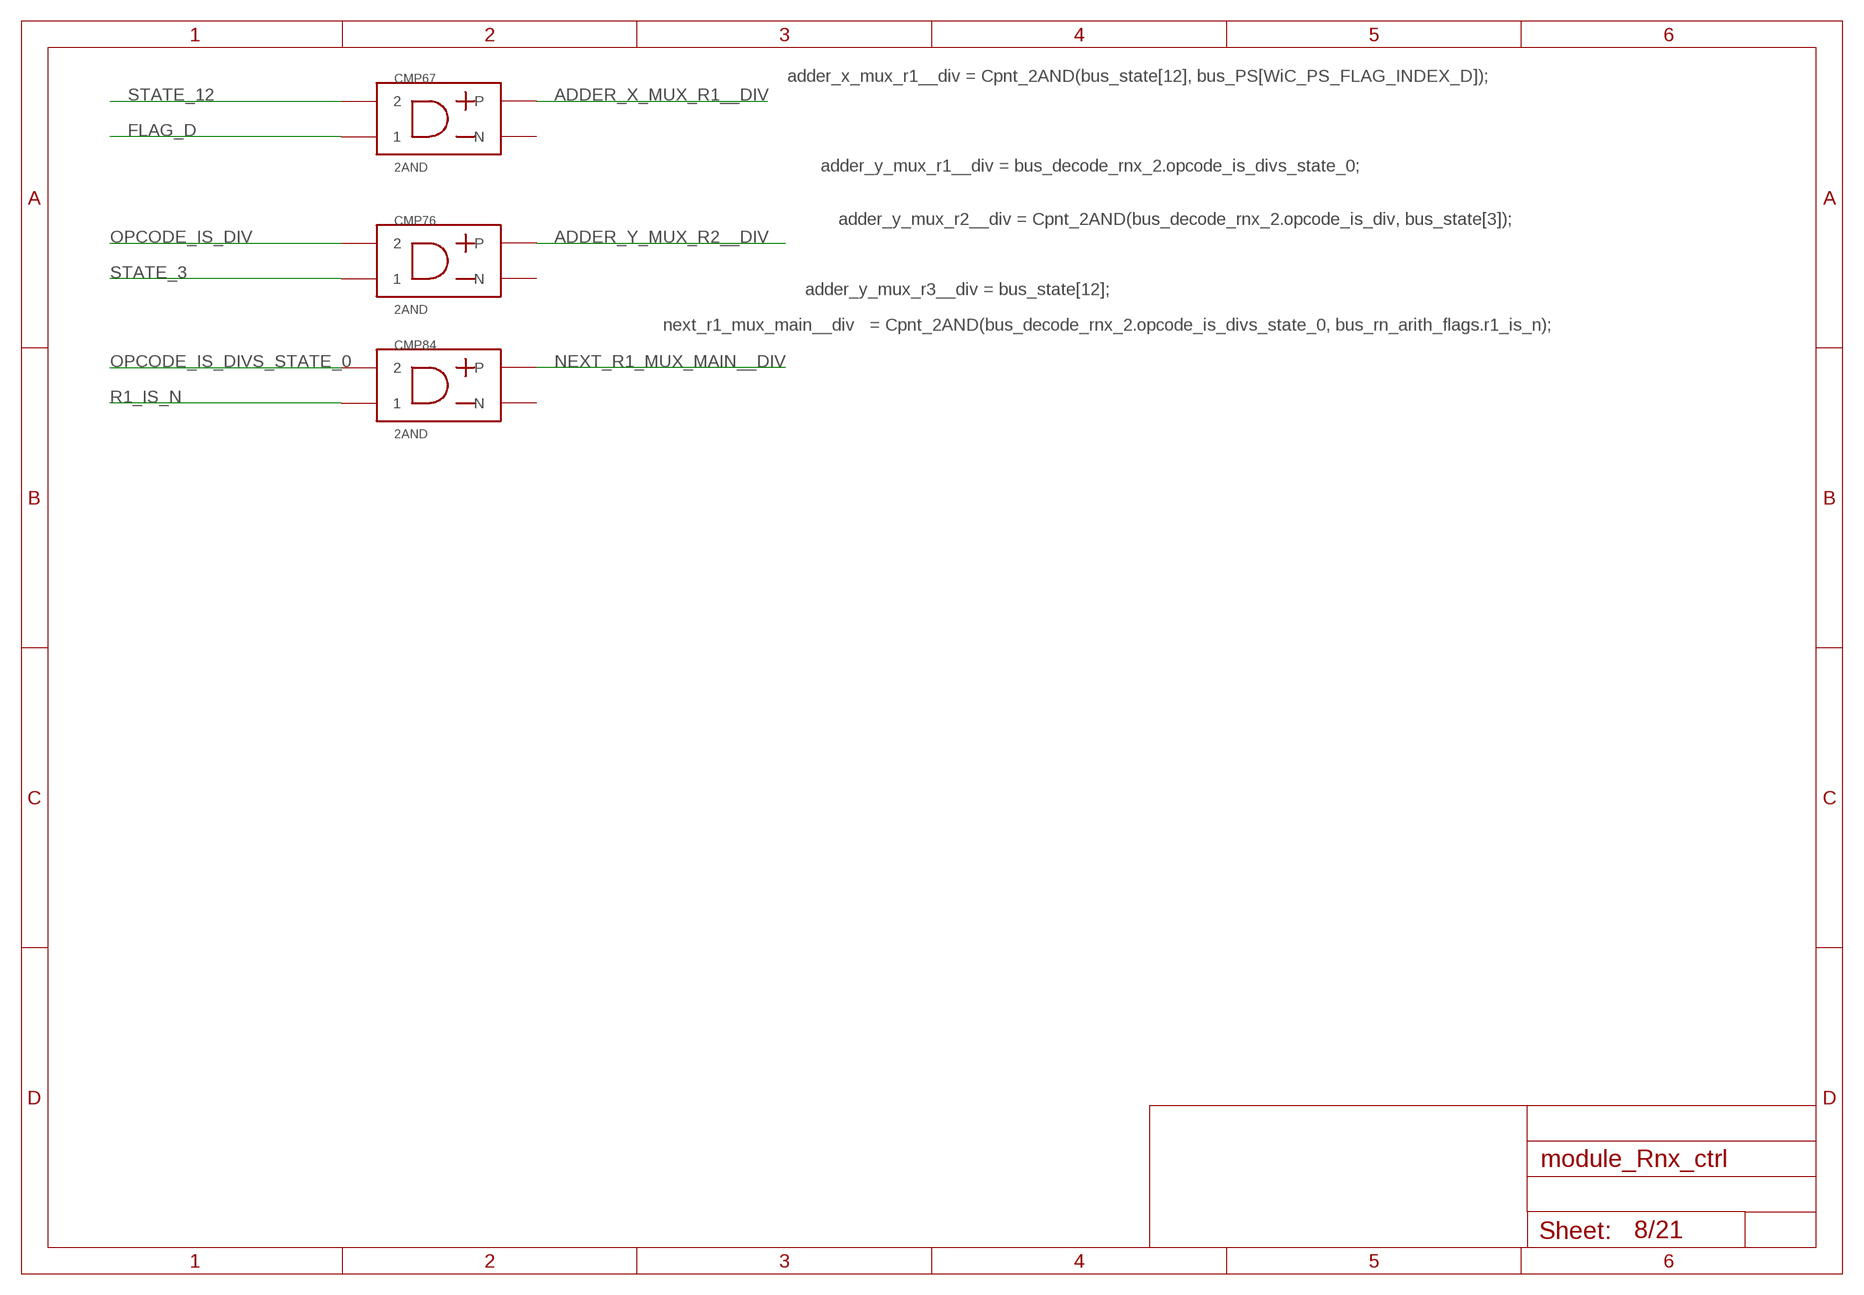
[diagram p7: schematic, sheet 8]

### Parts
CMP67  2AND  [2AND]
CMP76  2AND  [2AND]
CMP84  2AND  [2AND]

### Nets
ADDER_X_MUX_R1__DIV: CMP67.OUT_P(P) ; also sheet 9
ADDER_Y_MUX_R2__DIV: CMP76.OUT_P(P) ; also sheet 12,13
FLAG_D: CMP67.P$1 ; also sheet 1,19
NEXT_R1_MUX_MAIN__DIV: CMP84.OUT_P(P) ; also sheet 18
OPCODE_IS_DIV: CMP76.P$2 ; also sheet 3,16
OPCODE_IS_DIVS_STATE_0: CMP84.P$2 ; also sheet 3,12
R1_IS_N: CMP84.P$1 ; also sheet 2,17
STATE_3: CMP76.P$1 ; also sheet 1,12,19,20
STATE_12: CMP67.P$2 ; also sheet 1,7,12,15
Unconnected: CMP67.OUT_M(N) CMP76.OUT_M(N) CMP84.OUT_M(N)

### Notes on the sheet
- adder_x_mux_r1__div = Cpnt_2AND(bus_state[12], bus_PS[WiC_PS_FLAG_INDEX_D]);
- adder_y_mux_r1__div = bus_decode_rnx_2.opcode_is_divs_state_0;
- adder_y_mux_r2__div = Cpnt_2AND(bus_decode_rnx_2.opcode_is_div, bus_state[3]);
- adder_y_mux_r3__div = bus_state[12];
- next_r1_mux_main__div   = Cpnt_2AND(bus_decode_rnx_2.opcode_is_divs_state_0, bus_rn_arith_flags.r1_is_n);

## Sheet 9 of 21
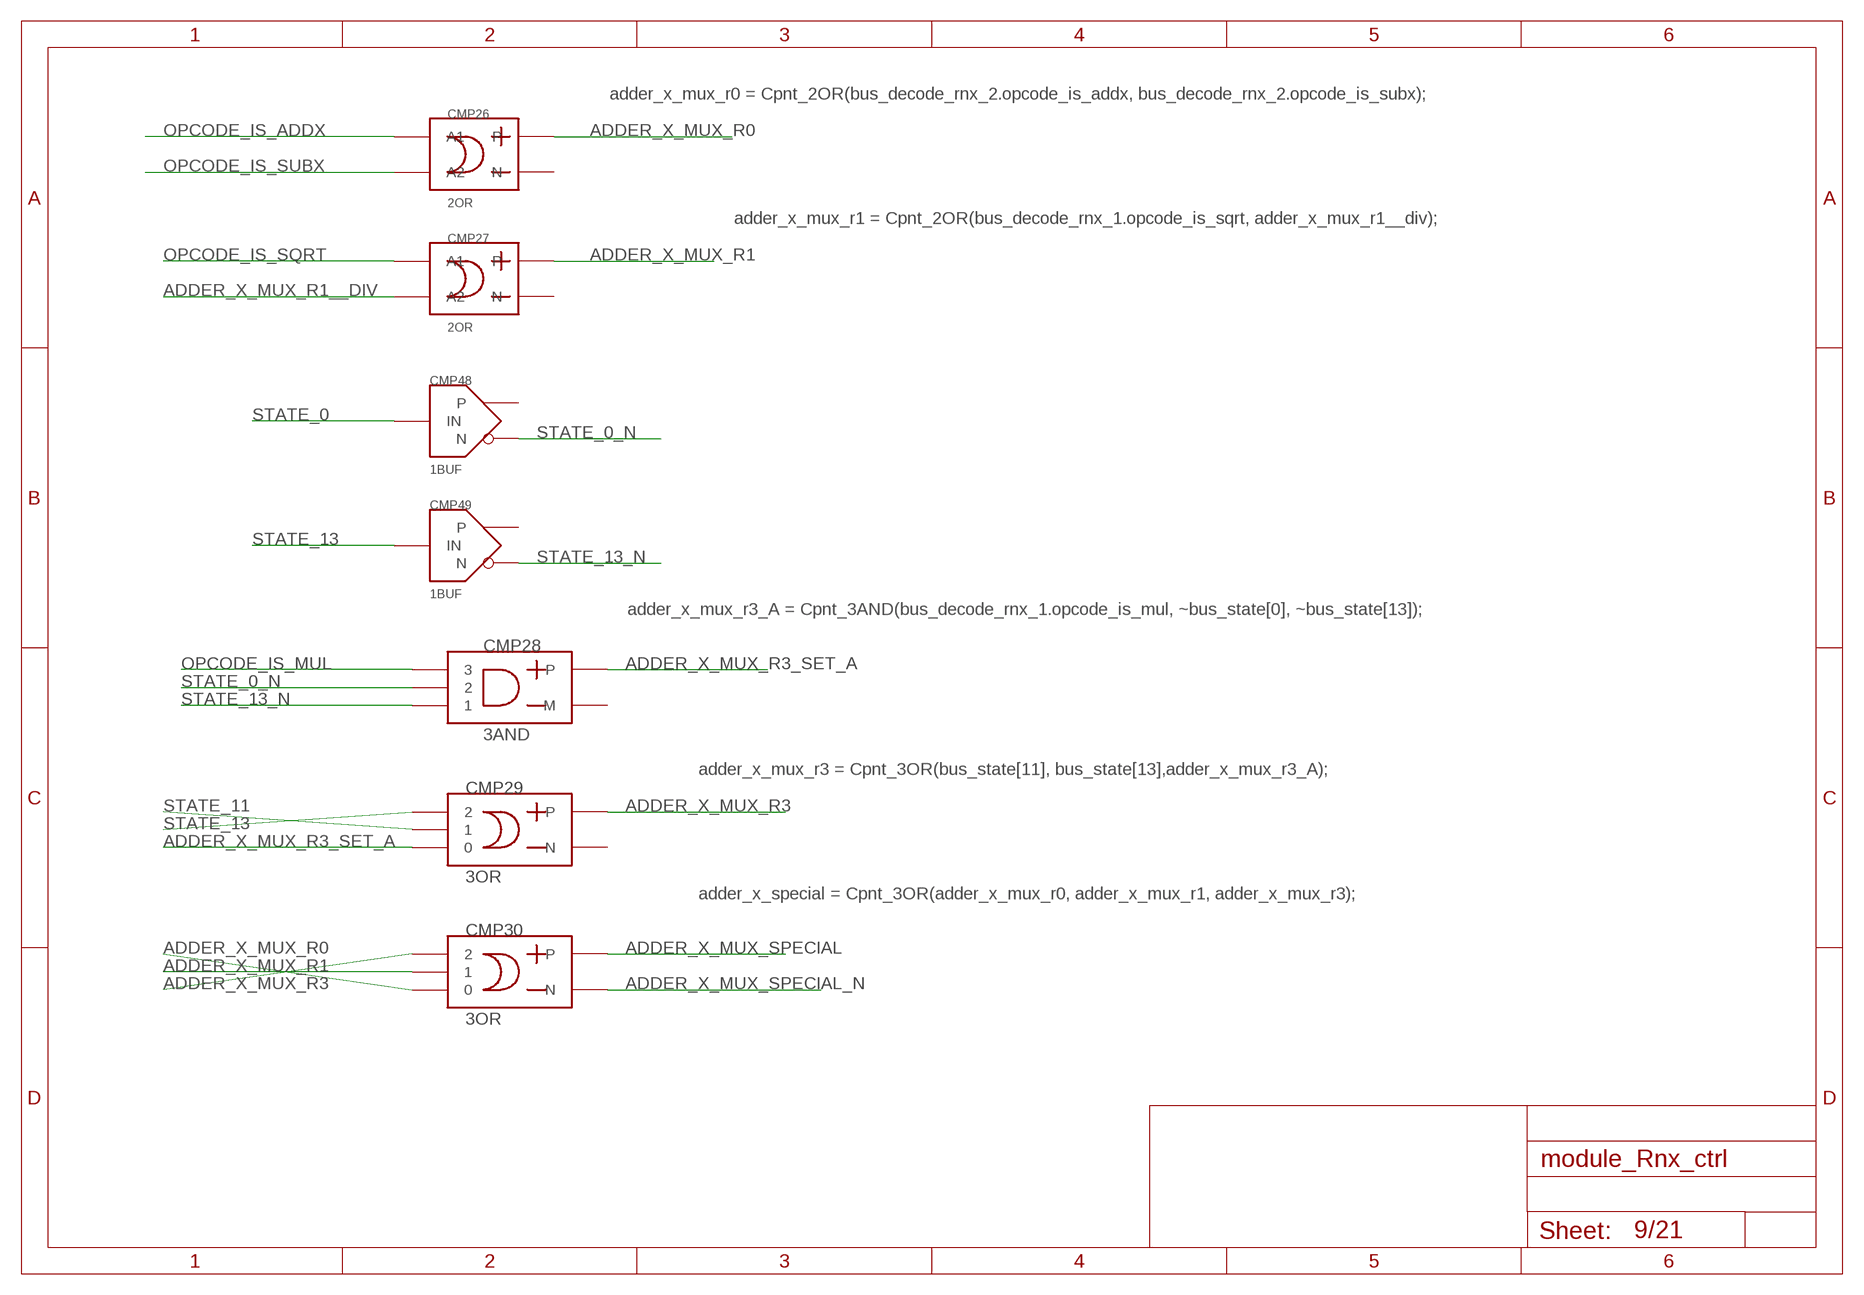
[diagram p8: schematic, sheet 9]

### Parts
CMP26  2OR  [2OR]
CMP27  2OR  [2OR]
CMP28  3AND  [3AND]
CMP29  3OR  [3OR]
CMP30  3OR  [3OR]
CMP48  1BUF  [1BUF]
CMP49  1BUF  [1BUF]

### Nets
ADDER_X_MUX_R0: CMP26.OUT_P(P) CMP30.P$1 ; also sheet 10
ADDER_X_MUX_R1: CMP27.OUT_P(P) CMP30.P$2 ; also sheet 10
ADDER_X_MUX_R1__DIV: CMP27.P$1(A2) ; also sheet 8
ADDER_X_MUX_R3: CMP29.OUT_P(P) CMP30.P$3 ; also sheet 10
ADDER_X_MUX_R3_SET_A: CMP28.OUT_P(P) CMP29.P$1
ADDER_X_MUX_SPECIAL: CMP30.OUT_P(P) ; also sheet 5,10
ADDER_X_MUX_SPECIAL_N: CMP30.OUT_M(N)
OPCODE_IS_ADDX: CMP26.P$2(A1) ; also sheet 3,12
OPCODE_IS_MUL: CMP28.P$3 ; also sheet 3,16,19,20
OPCODE_IS_SQRT: CMP27.P$2(A1) ; also sheet 3,7,12,16,20
OPCODE_IS_SUBX: CMP26.P$1(A2) ; also sheet 3,12
STATE_0: CMP48.IN ; also sheet 1,7,11,14,15,16,19,20
STATE_0_N: CMP28.P$2 CMP48.N ; also sheet 16,20
STATE_11: CMP29.P$2 ; also sheet 1,4,12,15,20,21
STATE_13: CMP29.P$3 CMP49.IN ; also sheet 1,4,19
STATE_13_N: CMP28.P$1 CMP49.N
Unconnected: CMP26.OUT_M(N) CMP27.OUT_M(N) CMP28.OUT_M(M) CMP29.OUT_M(N) CMP48.P CMP49.P

### Notes on the sheet
- adder_x_mux_r0 = Cpnt_2OR(bus_decode_rnx_2.opcode_is_addx, bus_decode_rnx_2.opcode_is_subx);
- adder_x_mux_r1 = Cpnt_2OR(bus_decode_rnx_1.opcode_is_sqrt, adder_x_mux_r1__div);
- adder_x_mux_r3_A = Cpnt_3AND(bus_decode_rnx_1.opcode_is_mul, ~bus_state[0], ~bus_state[13]);
- adder_x_mux_r3 = Cpnt_3OR(bus_state[11], bus_state[13],adder_x_mux_r3_A);
- adder_x_special = Cpnt_3OR(adder_x_mux_r0, adder_x_mux_r1, adder_x_mux_r3);

## Sheet 10 of 21
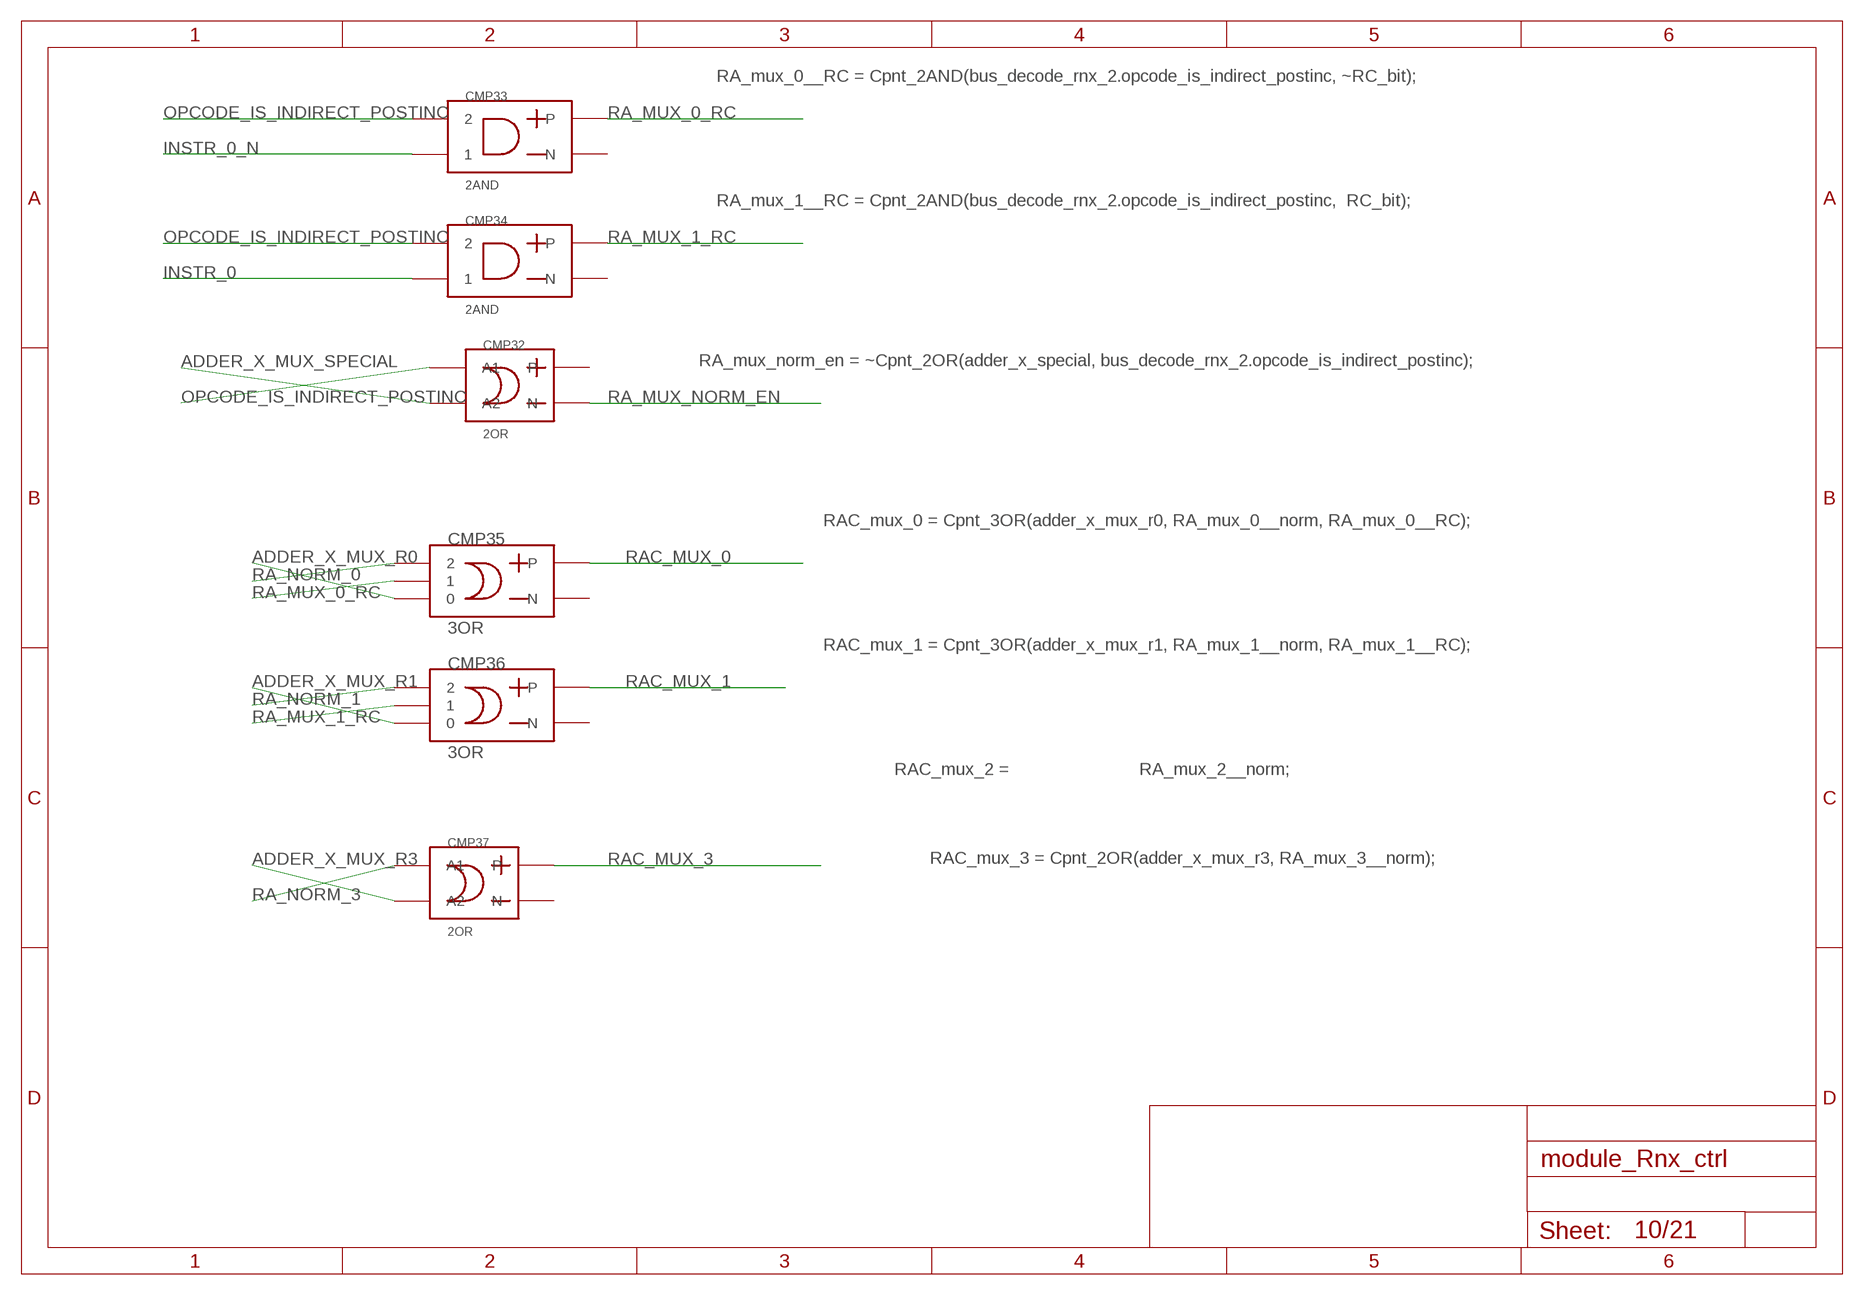
[diagram p9: schematic, sheet 10]

### Parts
CMP32  2OR  [2OR]
CMP33  2AND  [2AND]
CMP34  2AND  [2AND]
CMP35  3OR  [3OR]
CMP36  3OR  [3OR]
CMP37  2OR  [2OR]

### Nets
ADDER_X_MUX_R0: CMP35.P$1 ; also sheet 9
ADDER_X_MUX_R1: CMP36.P$1 ; also sheet 9
ADDER_X_MUX_R3: CMP37.P$1(A2) ; also sheet 9
ADDER_X_MUX_SPECIAL: CMP32.P$1(A2) ; also sheet 5,9
INSTR_0: CMP34.P$1 ; also sheet 3,6
INSTR_0_N: CMP33.P$1 ; also sheet 3
OPCODE_IS_INDIRECT_POSTINC: CMP32.P$2(A1) CMP33.P$2 CMP34.P$2 ; also sheet 3
RA_MUX_0_RC: CMP33.OUT_P(P) CMP35.P$2
RA_MUX_1_RC: CMP34.OUT_P(P) CMP36.P$2
RA_MUX_NORM_EN: CMP32.OUT_M(N) ; also sheet 6
RA_NORM_0: CMP35.P$3 ; also sheet 6
RA_NORM_1: CMP36.P$3 ; also sheet 6
RA_NORM_3: CMP37.P$2(A1) ; also sheet 6
RAC_MUX_0: CMP35.OUT_P(P) ; also sheet 4,18
RAC_MUX_1: CMP36.OUT_P(P) ; also sheet 4,18
RAC_MUX_3: CMP37.OUT_P(P) ; also sheet 4,20
Unconnected: CMP32.OUT_P(P) CMP33.OUT_M(N) CMP34.OUT_M(N) CMP35.OUT_M(N) CMP36.OUT_M(N) CMP37.OUT_M(N)

### Notes on the sheet
- RA_mux_0__RC = Cpnt_2AND(bus_decode_rnx_2.opcode_is_indirect_postinc, ~RC_bit);
- RA_mux_1__RC = Cpnt_2AND(bus_decode_rnx_2.opcode_is_indirect_postinc,  RC_bit);
- RA_mux_norm_en = ~Cpnt_2OR(adder_x_special, bus_decode_rnx_2.opcode_is_indirect_postinc);
- RAC_mux_0 = Cpnt_3OR(adder_x_mux_r0, RA_mux_0__norm, RA_mux_0__RC);
- RAC_mux_1 = Cpnt_3OR(adder_x_mux_r1, RA_mux_1__norm, RA_mux_1__RC);
- RAC_mux_2 =                          RA_mux_2__norm;
- RAC_mux_3 = Cpnt_2OR(adder_x_mux_r3, RA_mux_3__norm);

## Sheet 11 of 21
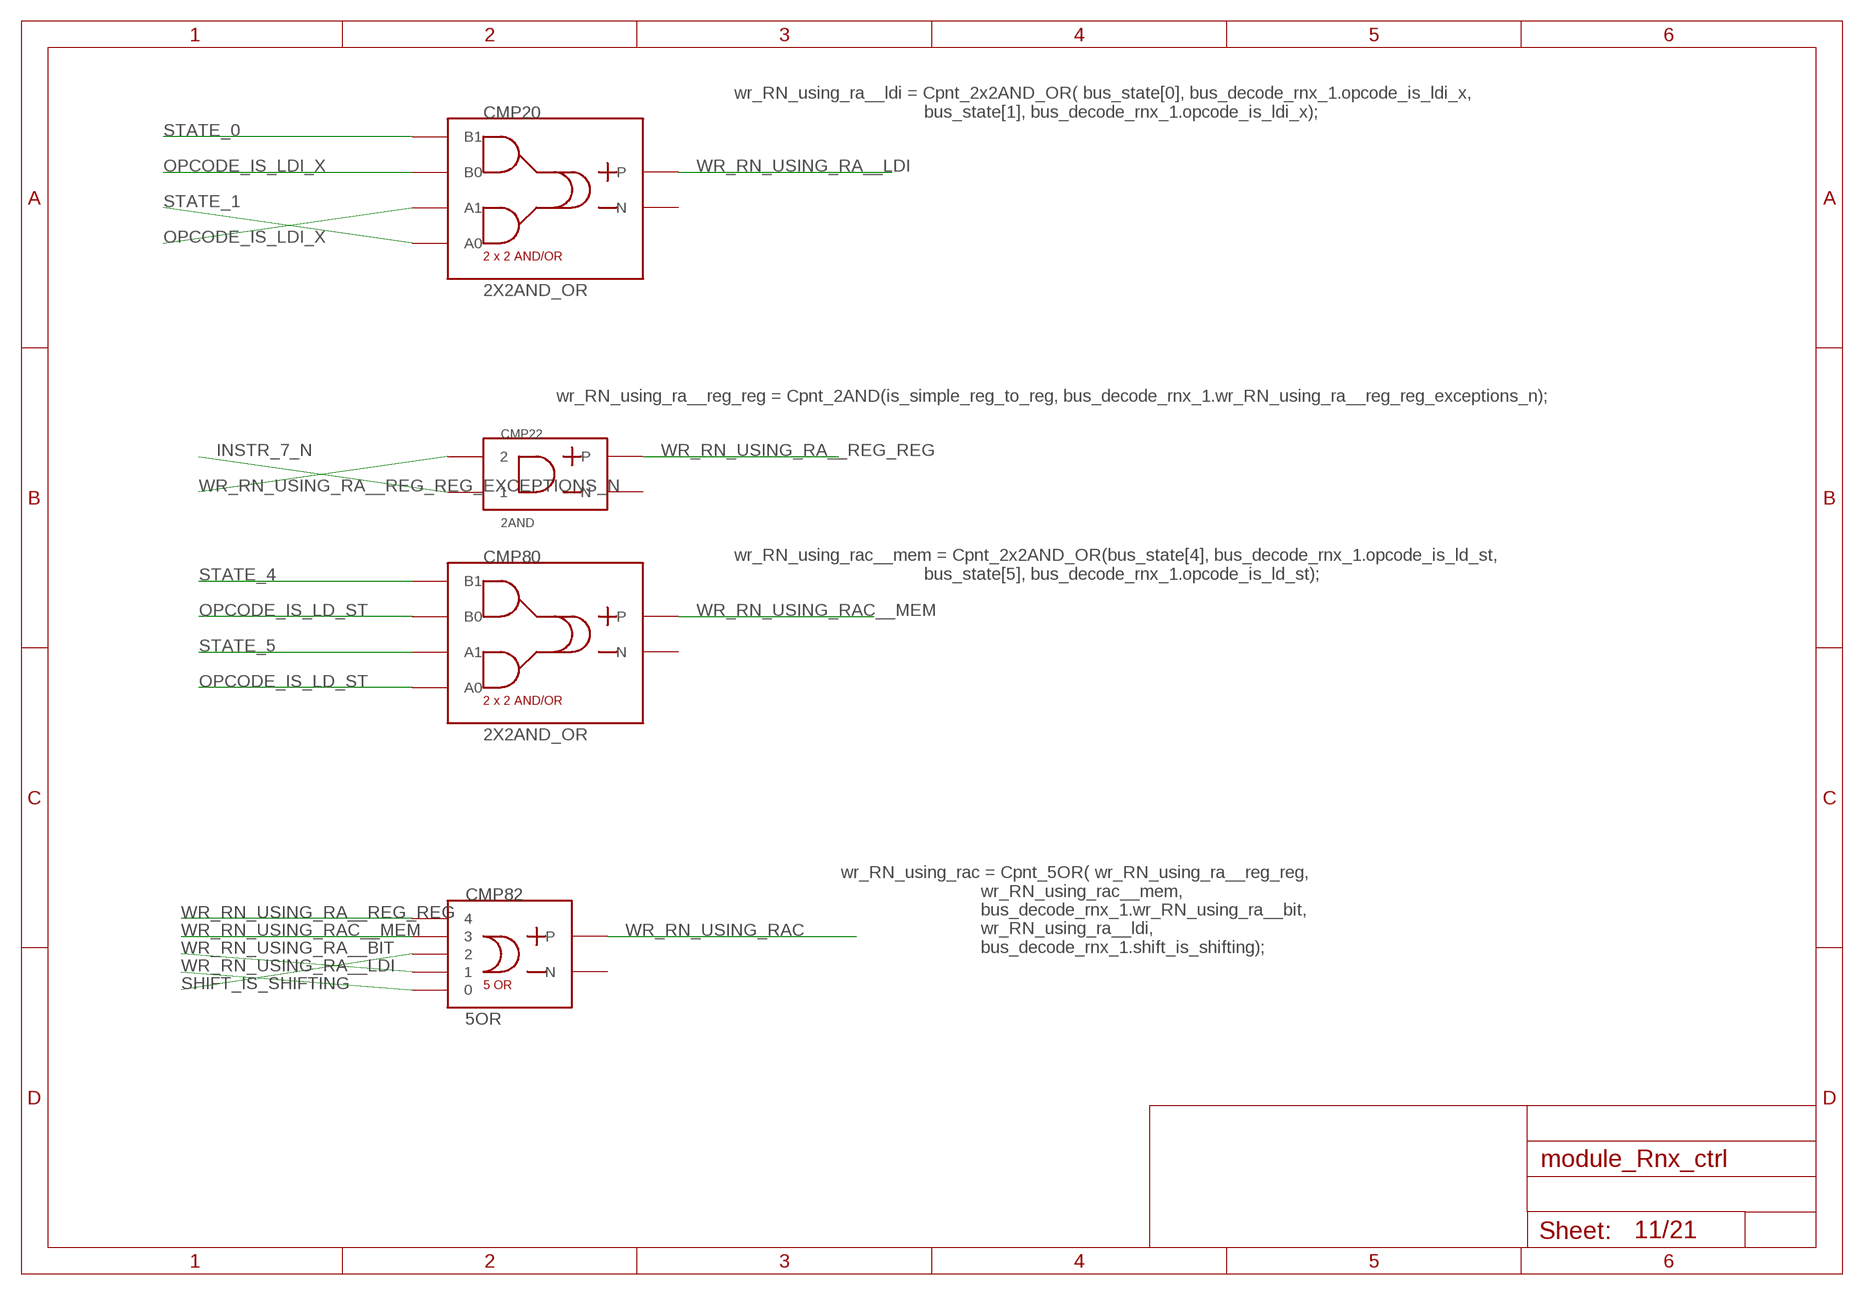
[diagram p10: schematic, sheet 11]

### Parts
CMP20  2X2AND_OR  [2X2AND_OR]
CMP22  2AND  [2AND]
CMP80  2X2AND_OR  [2X2AND_OR]
CMP82  5OR  [5OR]

### Nets
INSTR_7_N: CMP22.P$1 ; also sheet 3,16
OPCODE_IS_LD_ST: CMP80.P$1(A0) CMP80.P$3(B0) ; also sheet 3,16
OPCODE_IS_LDI_X: CMP20.P$2(A1) CMP20.P$3(B0) ; also sheet 3
SHIFT_IS_SHIFTING: CMP82.3 ; also sheet 3
STATE_0: CMP20.P$4(B1) ; also sheet 1,7,9,14,15,16,19,20
STATE_1: CMP20.P$1(A0) ; also sheet 1
STATE_4: CMP80.P$4(B1) ; also sheet 1,7,15
STATE_5: CMP80.P$2(A1) ; also sheet 1
WR_RN_USING_RA__BIT: CMP82.2 ; also sheet 3
WR_RN_USING_RA__LDI: CMP20.OUT_P(P) CMP82.1
WR_RN_USING_RA__REG_REG: CMP22.OUT_P(P) CMP82.5
WR_RN_USING_RA__REG_REG_EXCEPTIONS_N: CMP22.P$2 ; also sheet 3
WR_RN_USING_RAC: CMP82.OUT_P(P) ; also sheet 18,19,20
WR_RN_USING_RAC__MEM: CMP80.OUT_P(P) CMP82.4
Unconnected: CMP20.OUT_M(N) CMP22.OUT_M(N) CMP80.OUT_M(N) CMP82.OUT_M(N)

### Notes on the sheet
- wr_RN_using_ra__ldi = Cpnt_2x2AND_OR( bus_state[0], bus_decode_rnx_1.opcode_is_ldi_x,
                                            bus_state[1], bus_decode_rnx_1.opcode_is_ldi_x);
- wr_RN_using_ra__reg_reg = Cpnt_2AND(is_simple_reg_to_reg, bus_decode_rnx_1.wr_RN_using_ra__reg_reg_exceptions_n);
- wr_RN_using_rac__mem = Cpnt_2x2AND_OR(bus_state[4], bus_decode_rnx_1.opcode_is_ld_st,
                                            bus_state[5], bus_decode_rnx_1.opcode_is_ld_st);
- wr_RN_using_rac = Cpnt_5OR( wr_RN_using_ra__reg_reg,
                                  wr_RN_using_rac__mem, 
                                  bus_decode_rnx_1.wr_RN_using_ra__bit,
                                  wr_RN_using_ra__ldi,
                                  bus_decode_rnx_1.shift_is_shifting);

## Sheet 12 of 21
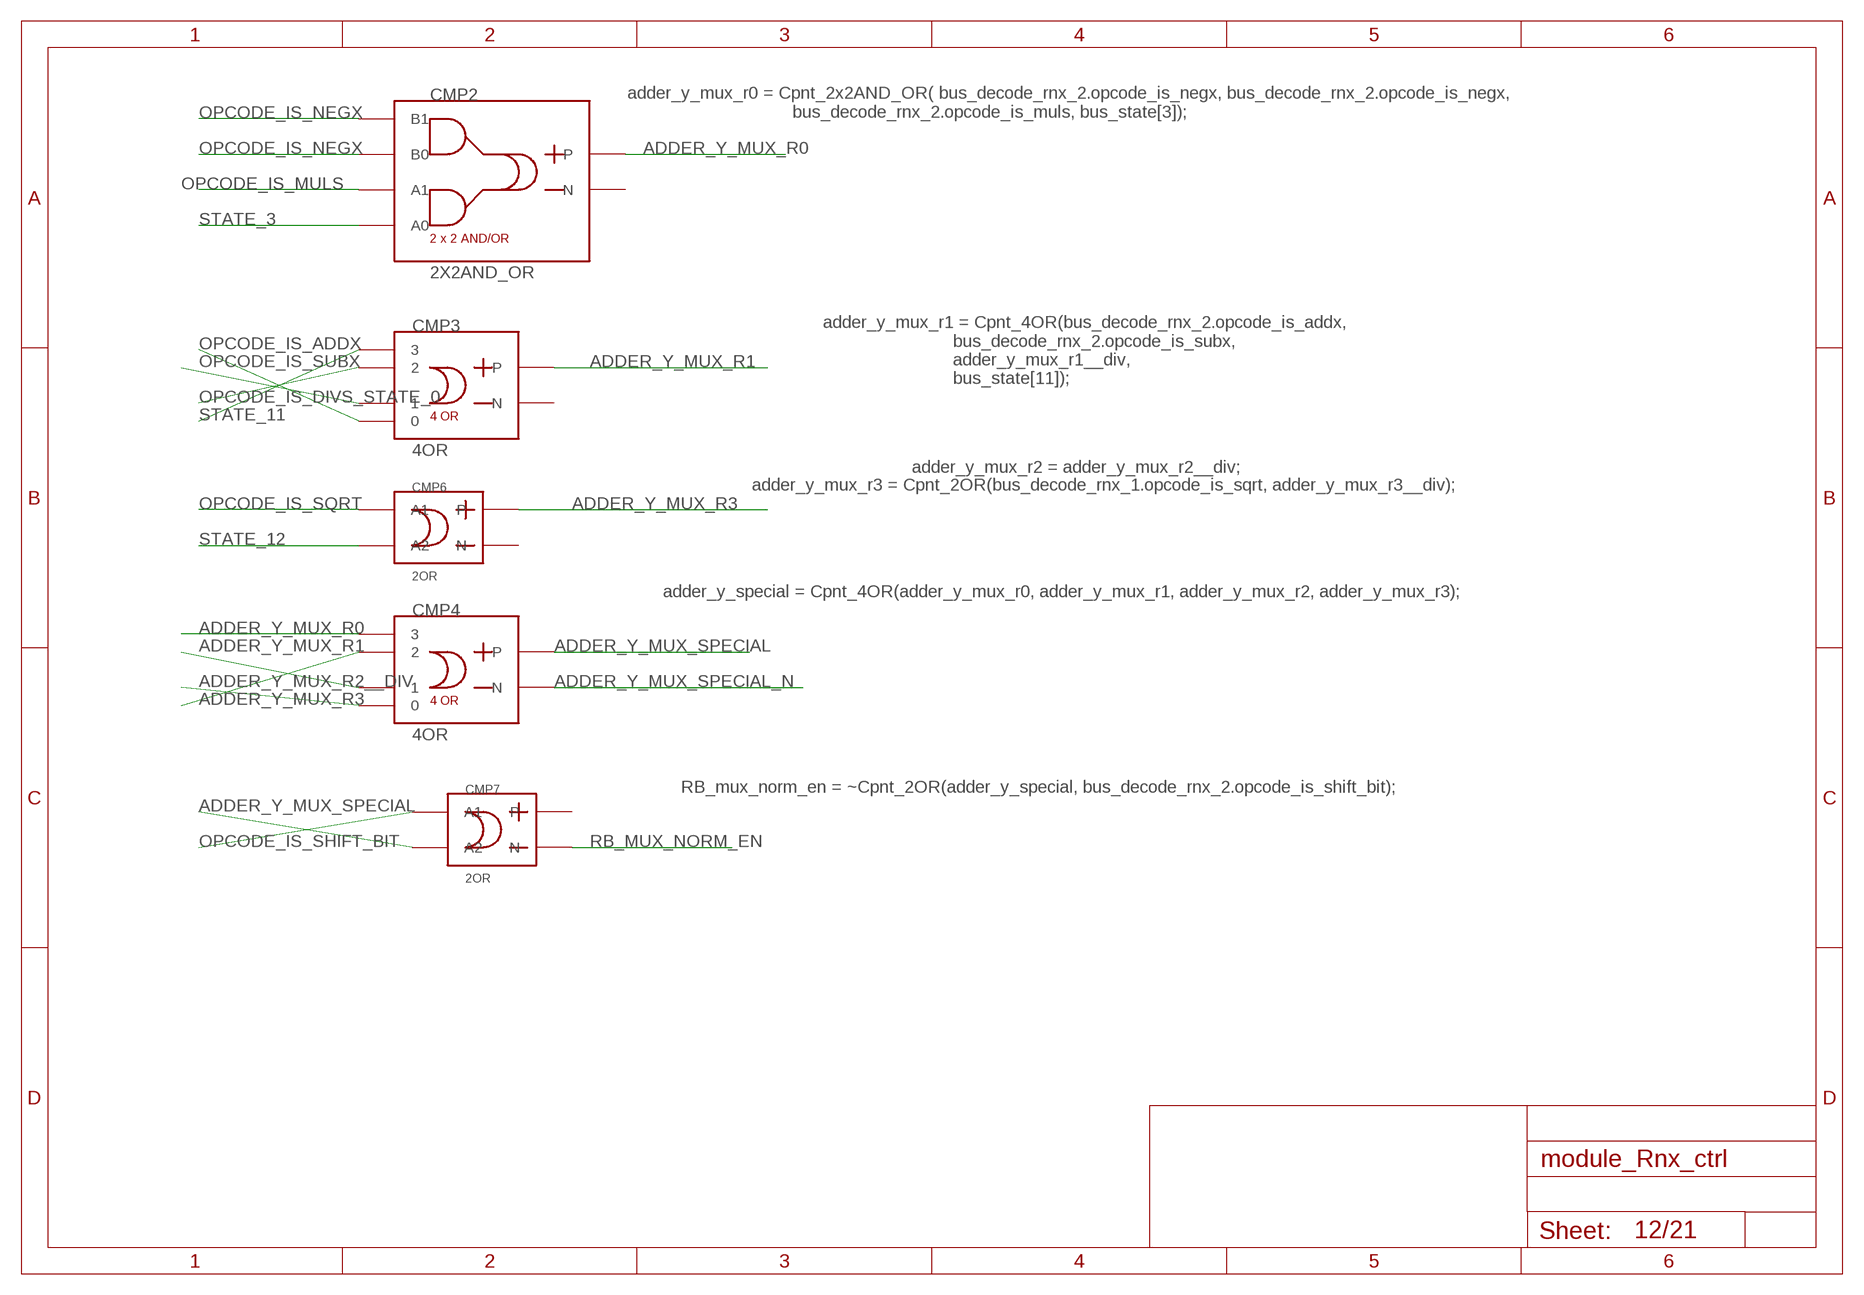
[diagram p11: schematic, sheet 12]

### Parts
CMP2  2X2AND_OR  [2X2AND_OR]
CMP3  4OR  [4OR]
CMP4  4OR  [4OR]
CMP6  2OR  [2OR]
CMP7  2OR  [2OR]

### Nets
ADDER_Y_MUX_R0: CMP2.OUT_P(P) CMP4.4 ; also sheet 13
ADDER_Y_MUX_R1: CMP3.OUT_P(P) CMP4.2 ; also sheet 13
ADDER_Y_MUX_R2__DIV: CMP4.1 ; also sheet 8,13
ADDER_Y_MUX_R3: CMP4.3 CMP6.OUT_P(P) ; also sheet 13
ADDER_Y_MUX_SPECIAL: CMP4.OUT_P(P) CMP7.P$1(A2) ; also sheet 5
ADDER_Y_MUX_SPECIAL_N: CMP4.OUT_M(N)
OPCODE_IS_ADDX: CMP3.1 ; also sheet 3,9
OPCODE_IS_DIVS_STATE_0: CMP3.3 ; also sheet 3,8
OPCODE_IS_MULS: CMP2.P$2(A1) ; also sheet 3
OPCODE_IS_NEGX: CMP2.P$3(B0) CMP2.P$4(B1) ; also sheet 3
OPCODE_IS_SHIFT_BIT: CMP7.P$2(A1) ; also sheet 3,6,16
OPCODE_IS_SQRT: CMP6.P$2(A1) ; also sheet 3,7,9,16,20
OPCODE_IS_SUBX: CMP3.2 ; also sheet 3,9
RB_MUX_NORM_EN: CMP7.OUT_M(N) ; also sheet 6
STATE_3: CMP2.P$1(A0) ; also sheet 1,8,19,20
STATE_11: CMP3.4 ; also sheet 1,4,9,15,20,21
STATE_12: CMP6.P$1(A2) ; also sheet 1,7,8,15
Unconnected: CMP2.OUT_M(N) CMP3.OUT_M(N) CMP6.OUT_M(N) CMP7.OUT_P(P)

### Notes on the sheet
- adder_y_mux_r0 = Cpnt_2x2AND_OR( bus_decode_rnx_2.opcode_is_negx, bus_decode_rnx_2.opcode_is_negx,
                                       bus_decode_rnx_2.opcode_is_muls, bus_state[3]);
- adder_y_mux_r1 = Cpnt_4OR(bus_decode_rnx_2.opcode_is_addx,
                                bus_decode_rnx_2.opcode_is_subx,
                                adder_y_mux_r1__div,
                                bus_state[11]);
- adder_y_mux_r2 = adder_y_mux_r2__div;
- adder_y_mux_r3 = Cpnt_2OR(bus_decode_rnx_1.opcode_is_sqrt, adder_y_mux_r3__div);
- adder_y_special = Cpnt_4OR(adder_y_mux_r0, adder_y_mux_r1, adder_y_mux_r2, adder_y_mux_r3);
- RB_mux_norm_en = ~Cpnt_2OR(adder_y_special, bus_decode_rnx_2.opcode_is_shift_bit);

## Sheet 13 of 21
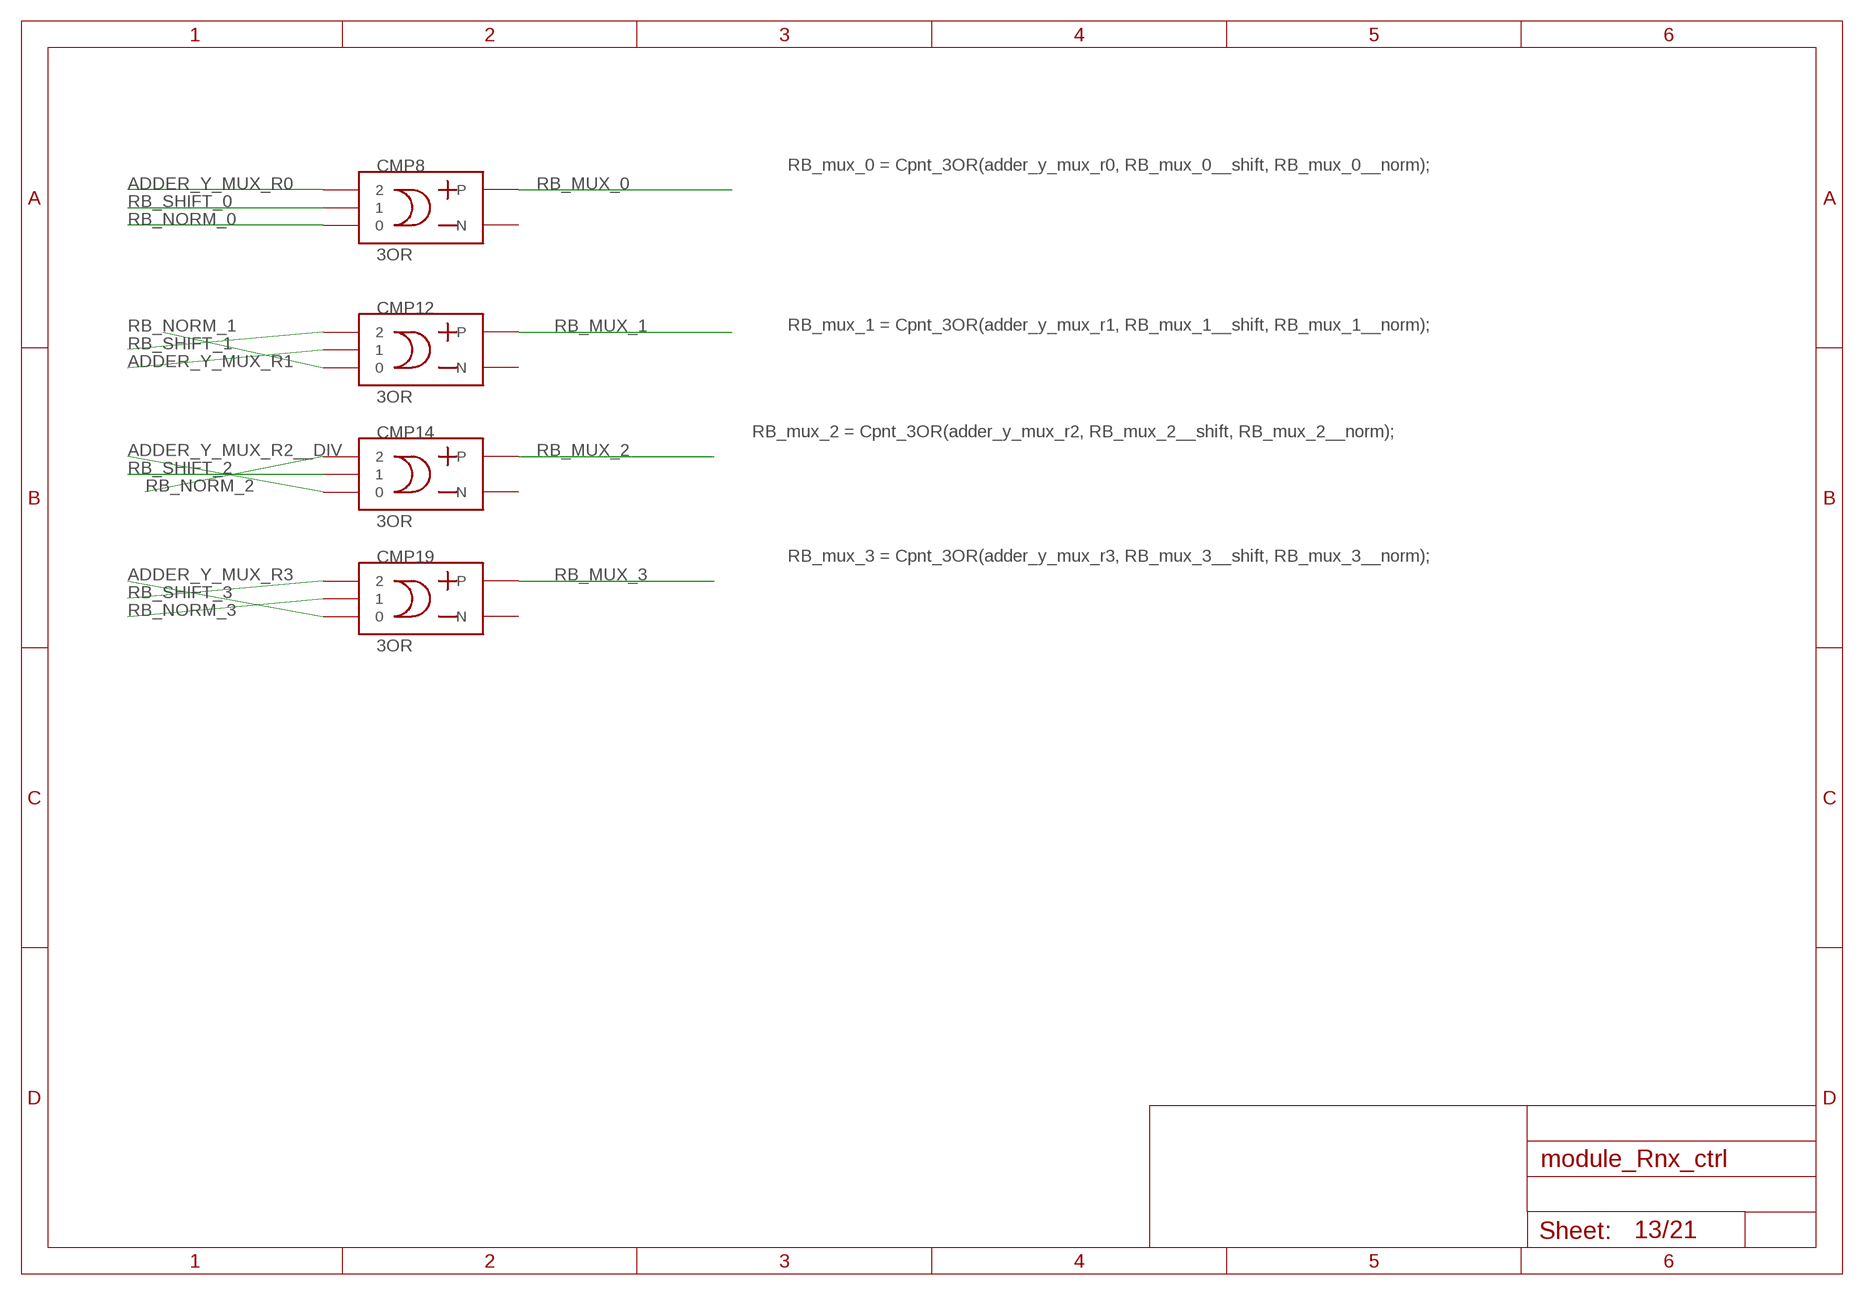
[diagram p12: schematic, sheet 13]

### Parts
CMP8  3OR  [3OR]
CMP12  3OR  [3OR]
CMP14  3OR  [3OR]
CMP19  3OR  [3OR]

### Nets
ADDER_Y_MUX_R0: CMP8.P$3 ; also sheet 12
ADDER_Y_MUX_R1: CMP12.P$2 ; also sheet 12
ADDER_Y_MUX_R2__DIV: CMP14.P$1 ; also sheet 8,12
ADDER_Y_MUX_R3: CMP19.P$1 ; also sheet 12
RB_MUX_0: CMP8.OUT_P(P) ; also sheet 4
RB_MUX_1: CMP12.OUT_P(P) ; also sheet 4
RB_MUX_2: CMP14.OUT_P(P) ; also sheet 4
RB_MUX_3: CMP19.OUT_P(P) ; also sheet 4
RB_NORM_0: CMP8.P$1 ; also sheet 6
RB_NORM_1: CMP12.P$1 ; also sheet 6
RB_NORM_2: CMP14.P$3 ; also sheet 6
RB_NORM_3: CMP19.P$2 ; also sheet 6
RB_SHIFT_0: CMP8.P$2 ; also sheet 6
RB_SHIFT_1: CMP12.P$3 ; also sheet 6
RB_SHIFT_2: CMP14.P$2 ; also sheet 6
RB_SHIFT_3: CMP19.P$3 ; also sheet 6
Unconnected: CMP8.OUT_M(N) CMP12.OUT_M(N) CMP14.OUT_M(N) CMP19.OUT_M(N)

### Notes on the sheet
- RB_mux_0 = Cpnt_3OR(adder_y_mux_r0, RB_mux_0__shift, RB_mux_0__norm);
- RB_mux_1 = Cpnt_3OR(adder_y_mux_r1, RB_mux_1__shift, RB_mux_1__norm);
- RB_mux_2 = Cpnt_3OR(adder_y_mux_r2, RB_mux_2__shift, RB_mux_2__norm);
- RB_mux_3 = Cpnt_3OR(adder_y_mux_r3, RB_mux_3__shift, RB_mux_3__norm);

## Sheet 14 of 21
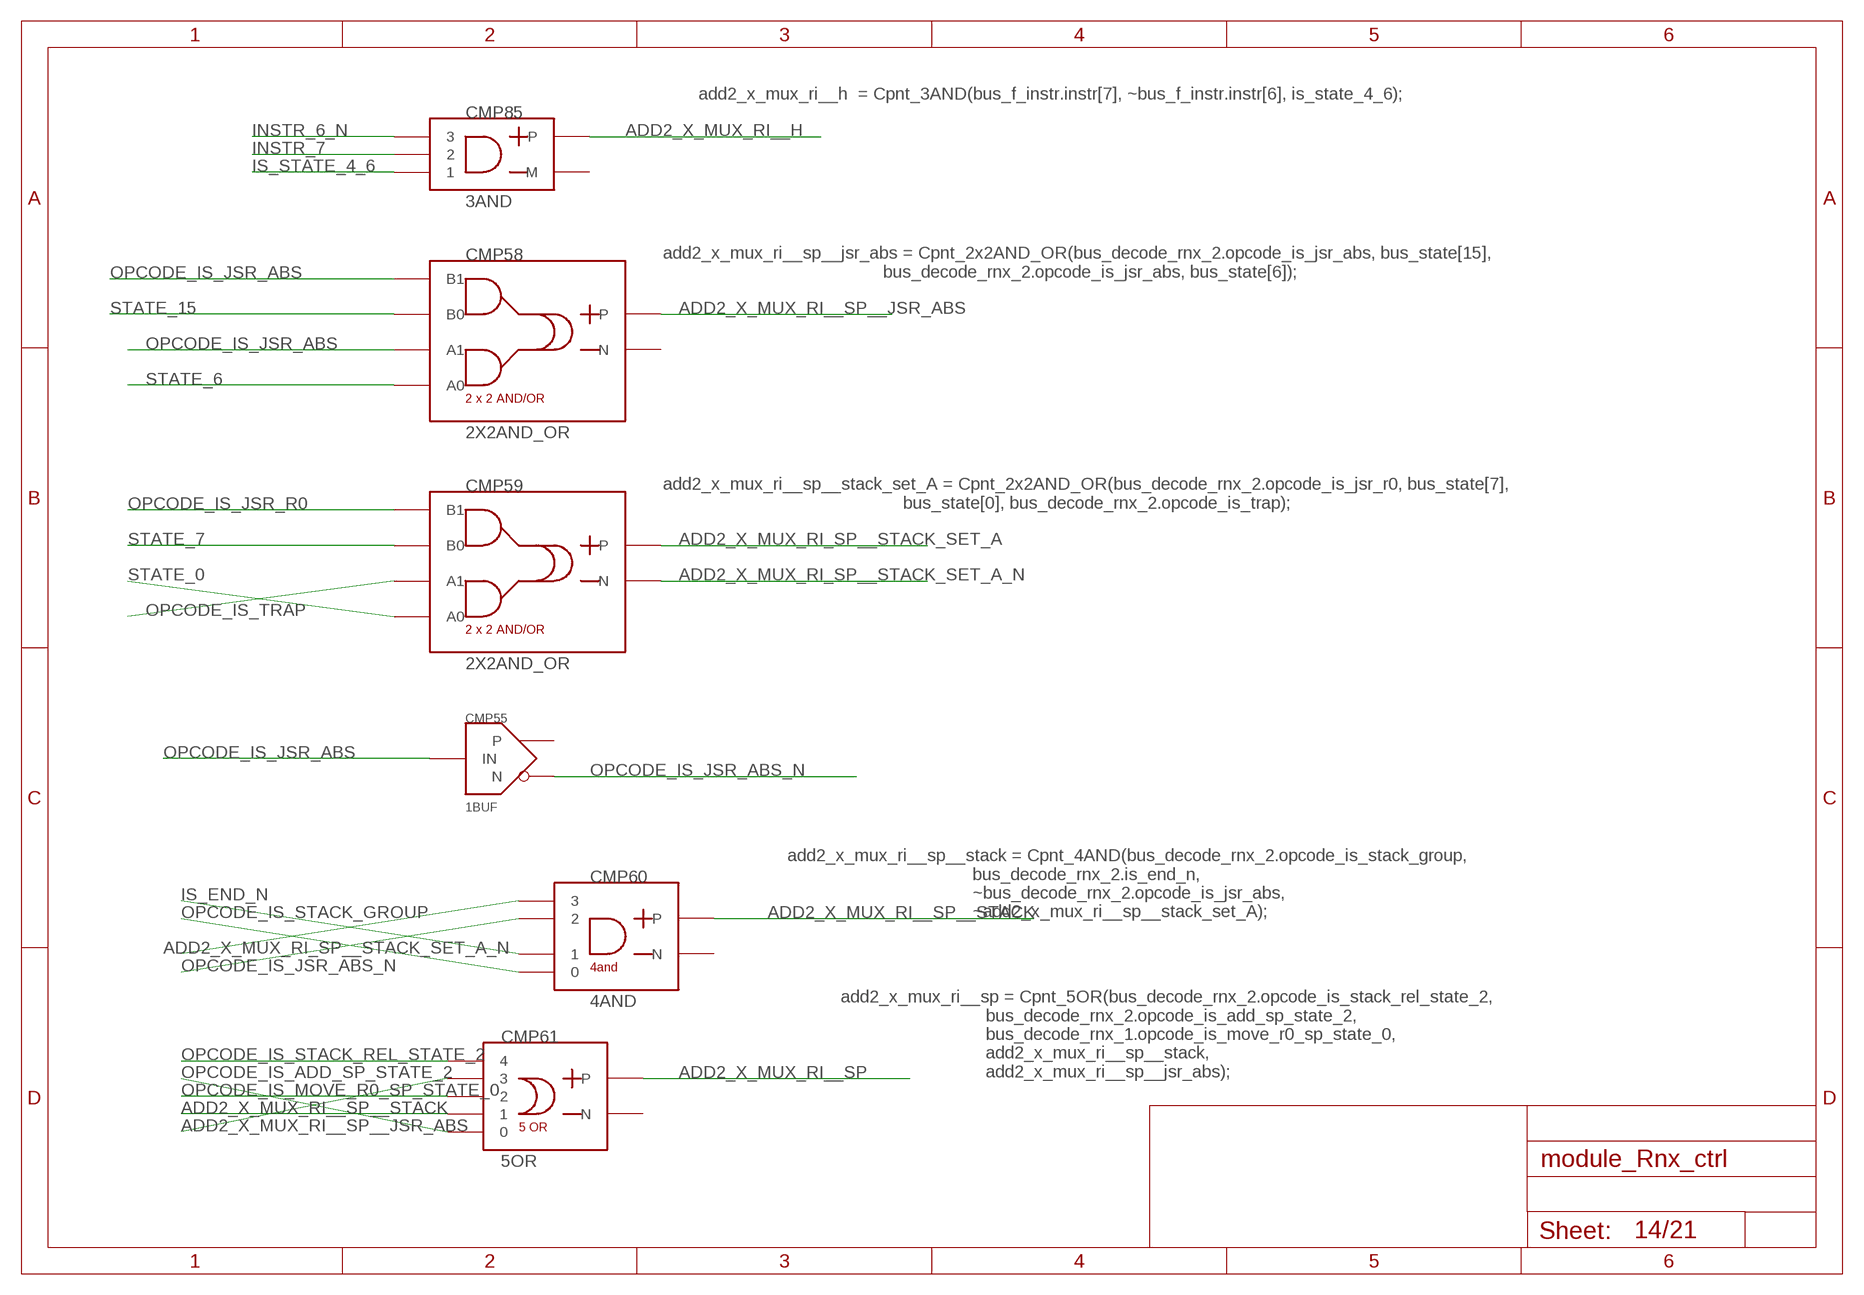
[diagram p13: schematic, sheet 14]

### Parts
CMP55  1BUF  [1BUF]
CMP58  2X2AND_OR  [2X2AND_OR]
CMP59  2X2AND_OR  [2X2AND_OR]
CMP60  4AND  [4AND]
CMP61  5OR  [5OR]
CMP85  3AND  [3AND]

### Nets
ADD2_X_MUX_RI__H: CMP85.OUT_P(P) ; also sheet 5,15
ADD2_X_MUX_RI__SP: CMP61.OUT_P(P) ; also sheet 4,5,15
ADD2_X_MUX_RI__SP__JSR_ABS: CMP58.OUT_P(P) CMP61.4 ; also sheet 5
ADD2_X_MUX_RI__SP__STACK: CMP60.OUT_P(P) CMP61.5
ADD2_X_MUX_RI_SP__STACK_SET_A: CMP59.OUT_P(P)
ADD2_X_MUX_RI_SP__STACK_SET_A_N: CMP59.OUT_M(N) CMP60.P$4
INSTR_6_N: CMP85.P$3 ; also sheet 3
INSTR_7: CMP85.P$2 ; also sheet 3
IS_END_N: CMP60.P$2 ; also sheet 3
IS_STATE_4_6: CMP85.P$1 ; also sheet 7,16
OPCODE_IS_ADD_SP_STATE_2: CMP61.1 ; also sheet 3
OPCODE_IS_JSR_ABS: CMP55.IN CMP58.P$2(A1) CMP58.P$4(B1) ; also sheet 3
OPCODE_IS_JSR_ABS_N: CMP55.N CMP60.P$3
OPCODE_IS_JSR_R0: CMP59.P$4(B1) ; also sheet 3
OPCODE_IS_MOVE_R0_SP_STATE_0: CMP61.2 ; also sheet 3,18
OPCODE_IS_STACK_GROUP: CMP60.P$1 ; also sheet 3
OPCODE_IS_STACK_REL_STATE_2: CMP61.3 ; also sheet 3
OPCODE_IS_TRAP: CMP59.P$2(A1) ; also sheet 3
STATE_0: CMP59.P$1(A0) ; also sheet 1,7,9,11,15,16,19,20
STATE_6: CMP58.P$1(A0) ; also sheet 1,7
STATE_7: CMP59.P$3(B0) ; also sheet 1
STATE_15: CMP58.P$3(B0) ; also sheet 1
Unconnected: CMP55.P CMP58.OUT_M(N) CMP60.OUT_M(N) CMP61.OUT_M(N) CMP85.OUT_M(M)

### Notes on the sheet
- add2_x_mux_ri__h  = Cpnt_3AND(bus_f_instr.instr[7], ~bus_f_instr.instr[6], is_state_4_6);
- add2_x_mux_ri__sp__jsr_abs = Cpnt_2x2AND_OR(bus_decode_rnx_2.opcode_is_jsr_abs, bus_state[15],
                                                  bus_decode_rnx_2.opcode_is_jsr_abs, bus_state[6]);
- add2_x_mux_ri__sp__stack_set_A = Cpnt_2x2AND_OR(bus_decode_rnx_2.opcode_is_jsr_r0, bus_state[7],
                                                      bus_state[0], bus_decode_rnx_2.opcode_is_trap);
- add2_x_mux_ri__sp__stack = Cpnt_4AND(bus_decode_rnx_2.opcode_is_stack_group,
                                           bus_decode_rnx_2.is_end_n,
                                           ~bus_decode_rnx_2.opcode_is_jsr_abs,
                                           ~add2_x_mux_ri__sp__stack_set_A);
- add2_x_mux_ri__sp = Cpnt_5OR(bus_decode_rnx_2.opcode_is_stack_rel_state_2,
                                   bus_decode_rnx_2.opcode_is_add_sp_state_2,
                                   bus_decode_rnx_1.opcode_is_move_r0_sp_state_0,
                                   add2_x_mux_ri__sp__stack,
                                   add2_x_mux_ri__sp__jsr_abs);

## Sheet 15 of 21
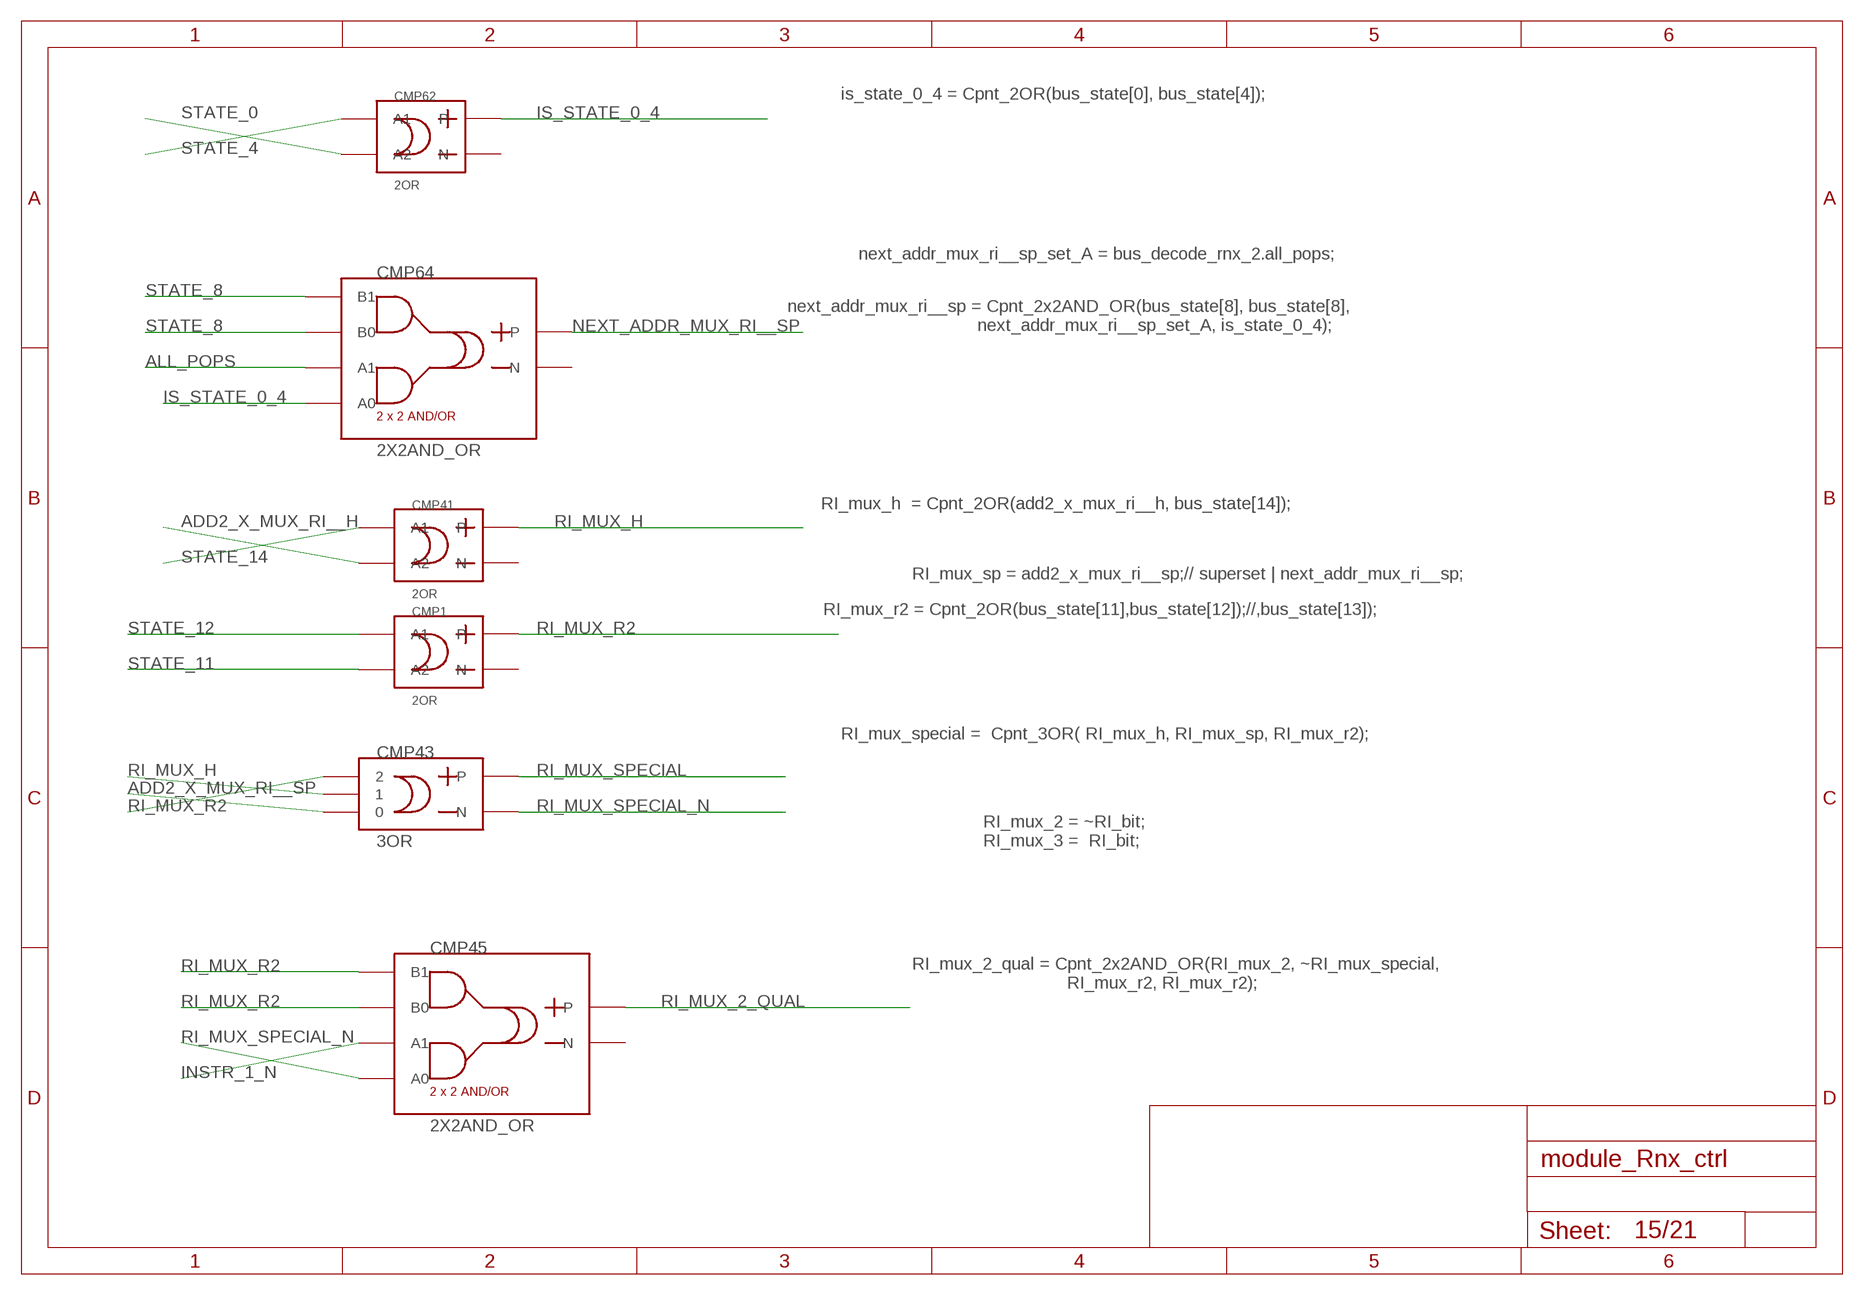
[diagram p14: schematic, sheet 15]

### Parts
CMP1  2OR  [2OR]
CMP41  2OR  [2OR]
CMP43  3OR  [3OR]
CMP45  2X2AND_OR  [2X2AND_OR]
CMP62  2OR  [2OR]
CMP64  2X2AND_OR  [2X2AND_OR]

### Nets
ADD2_X_MUX_RI__H: CMP41.P$1(A2) ; also sheet 5,14
ADD2_X_MUX_RI__SP: CMP43.P$1 ; also sheet 4,5,14
ALL_POPS: CMP64.P$2(A1) ; also sheet 3
INSTR_1_N: CMP45.P$2(A1) ; also sheet 3,19
IS_STATE_0_4: CMP62.OUT_P(P) CMP64.P$1(A0)
NEXT_ADDR_MUX_RI__SP: CMP64.OUT_P(P) ; also sheet 5
RI_MUX_2_QUAL: CMP45.OUT_P(P) ; also sheet 4
RI_MUX_H: CMP41.OUT_P(P) CMP43.P$2 ; also sheet 4
RI_MUX_R2: CMP1.OUT_P(P) CMP43.P$3 CMP45.P$3(B0) CMP45.P$4(B1)
RI_MUX_SPECIAL: CMP43.OUT_P(P)
RI_MUX_SPECIAL_N: CMP43.OUT_M(N) CMP45.P$1(A0) ; also sheet 16
STATE_0: CMP62.P$1(A2) ; also sheet 1,7,9,11,14,16,19,20
STATE_4: CMP62.P$2(A1) ; also sheet 1,7,11
STATE_8: CMP64.P$3(B0) CMP64.P$4(B1) ; also sheet 1
STATE_11: CMP1.P$1(A2) ; also sheet 1,4,9,12,20,21
STATE_12: CMP1.P$2(A1) ; also sheet 1,7,8,12
STATE_14: CMP41.P$2(A1) ; also sheet 1,17
Unconnected: CMP1.OUT_M(N) CMP41.OUT_M(N) CMP45.OUT_M(N) CMP62.OUT_M(N) CMP64.OUT_M(N)

### Notes on the sheet
- is_state_0_4 = Cpnt_2OR(bus_state[0], bus_state[4]);
- next_addr_mux_ri__sp_set_A = bus_decode_rnx_2.all_pops;
- next_addr_mux_ri__sp = Cpnt_2x2AND_OR(bus_state[8], bus_state[8],
                                            next_addr_mux_ri__sp_set_A, is_state_0_4);
- RI_mux_h  = Cpnt_2OR(add2_x_mux_ri__h, bus_state[14]);
- RI_mux_sp = add2_x_mux_ri__sp;// superset | next_addr_mux_ri__sp;
- RI_mux_r2 = Cpnt_2OR(bus_state[11],bus_state[12]);//,bus_state[13]);
- RI_mux_special =  Cpnt_3OR( RI_mux_h, RI_mux_sp, RI_mux_r2);
- RI_mux_2 = ~RI_bit;
      RI_mux_3 =  RI_bit;
- RI_mux_2_qual = Cpnt_2x2AND_OR(RI_mux_2, ~RI_mux_special,
                                     RI_mux_r2, RI_mux_r2);

## Sheet 16 of 21
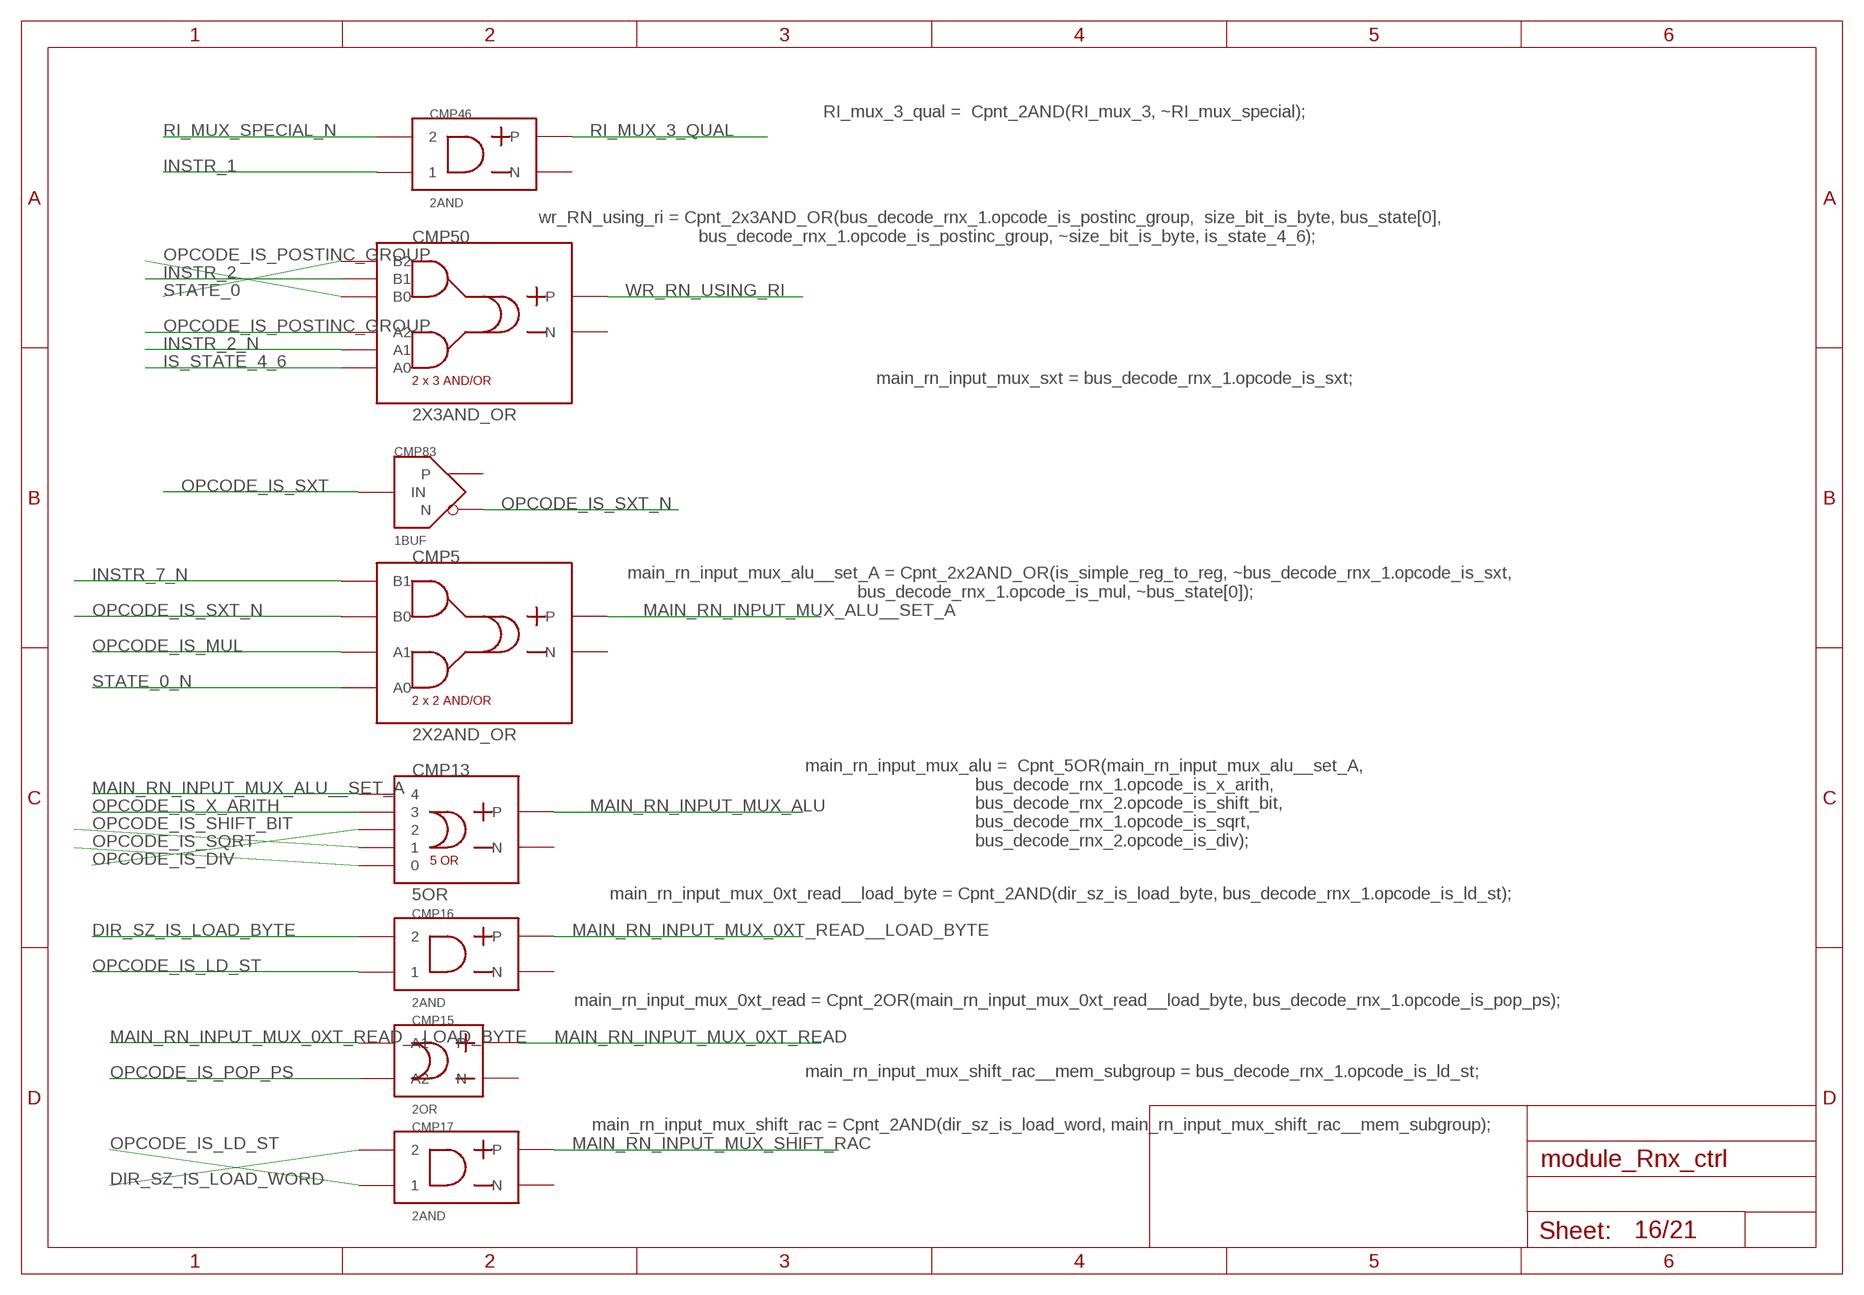
[diagram p15: schematic, sheet 16]

### Parts
CMP5  2X2AND_OR  [2X2AND_OR]
CMP13  5OR  [5OR]
CMP15  2OR  [2OR]
CMP16  2AND  [2AND]
CMP17  2AND  [2AND]
CMP46  2AND  [2AND]
CMP50  2X3AND_OR  [2X3AND_OR]
CMP83  1BUF  [1BUF]

### Nets
DIR_SZ_IS_LOAD_BYTE: CMP16.P$2 ; also sheet 6
DIR_SZ_IS_LOAD_WORD: CMP17.P$2 ; also sheet 6
INSTR_1: CMP46.P$1 ; also sheet 3,6,20
INSTR_2: CMP50.P$5(B1) ; also sheet 3,6
INSTR_2_N: CMP50.P$2(A1) ; also sheet 3
INSTR_7_N: CMP5.P$4(B1) ; also sheet 3,11
IS_STATE_4_6: CMP50.P$1(A0) ; also sheet 7,14
MAIN_RN_INPUT_MUX_0XT_READ: CMP15.OUT_P(P) ; also sheet 4
MAIN_RN_INPUT_MUX_0XT_READ__LOAD_BYTE: CMP15.P$2(A1) CMP16.OUT_P(P)
MAIN_RN_INPUT_MUX_ALU: CMP13.OUT_P(P) ; also sheet 4
MAIN_RN_INPUT_MUX_ALU__SET_A: CMP5.OUT_P(P) CMP13.5
MAIN_RN_INPUT_MUX_SHIFT_RAC: CMP17.OUT_P(P) ; also sheet 4
OPCODE_IS_DIV: CMP13.3 ; also sheet 3,8
OPCODE_IS_LD_ST: CMP16.P$1 CMP17.P$1 ; also sheet 3,11
OPCODE_IS_MUL: CMP5.P$2(A1) ; also sheet 3,9,19,20
OPCODE_IS_POP_PS: CMP15.P$1(A2) ; also sheet 3
OPCODE_IS_POSTINC_GROUP: CMP50.P$3(A2) CMP50.P$4(B0) ; also sheet 3
OPCODE_IS_SHIFT_BIT: CMP13.2 ; also sheet 3,6,12
OPCODE_IS_SQRT: CMP13.1 ; also sheet 3,7,9,12,20
OPCODE_IS_SXT: CMP83.IN ; also sheet 3,4
OPCODE_IS_SXT_N: CMP5.P$3(B0) CMP83.N
OPCODE_IS_X_ARITH: CMP13.4 ; also sheet 3,18
RI_MUX_3_QUAL: CMP46.OUT_P(P) ; also sheet 4
RI_MUX_SPECIAL_N: CMP46.P$2 ; also sheet 15
STATE_0: CMP50.P$6(B2) ; also sheet 1,7,9,11,14,15,19,20
STATE_0_N: CMP5.P$1(A0) ; also sheet 9,20
WR_RN_USING_RI: CMP50.OUT_P(P) ; also sheet 19,20
Unconnected: CMP5.OUT_M(N) CMP13.OUT_M(N) CMP15.OUT_M(N) CMP16.OUT_M(N) CMP17.OUT_M(N) CMP46.OUT_M(N) CMP50.OUT_M(N) CMP83.P

### Notes on the sheet
- RI_mux_3_qual =  Cpnt_2AND(RI_mux_3, ~RI_mux_special);
- wr_RN_using_ri = Cpnt_2x3AND_OR(bus_decode_rnx_1.opcode_is_postinc_group,  size_bit_is_byte, bus_state[0],
                                      bus_decode_rnx_1.opcode_is_postinc_group, ~size_bit_is_byte, is_state_4_6);
- main_rn_input_mux_sxt = bus_decode_rnx_1.opcode_is_sxt;
- main_rn_input_mux_alu__set_A = Cpnt_2x2AND_OR(is_simple_reg_to_reg, ~bus_decode_rnx_1.opcode_is_sxt,
                                                    bus_decode_rnx_1.opcode_is_mul, ~bus_state[0]);
- main_rn_input_mux_alu =  Cpnt_5OR(main_rn_input_mux_alu__set_A,
                                        bus_decode_rnx_1.opcode_is_x_arith,
                                        bus_decode_rnx_2.opcode_is_shift_bit,
                                        bus_decode_rnx_1.opcode_is_sqrt,
                                        bus_decode_rnx_2.opcode_is_div);
- main_rn_input_mux_0xt_read__load_byte = Cpnt_2AND(dir_sz_is_load_byte, bus_decode_rnx_1.opcode_is_ld_st);
- main_rn_input_mux_0xt_read = Cpnt_2OR(main_rn_input_mux_0xt_read__load_byte, bus_decode_rnx_1.opcode_is_pop_ps);
- main_rn_input_mux_shift_rac__mem_subgroup = bus_decode_rnx_1.opcode_is_ld_st;
- main_rn_input_mux_shift_rac = Cpnt_2AND(dir_sz_is_load_word, main_rn_input_mux_shift_rac__mem_subgroup);

## Sheet 17 of 21
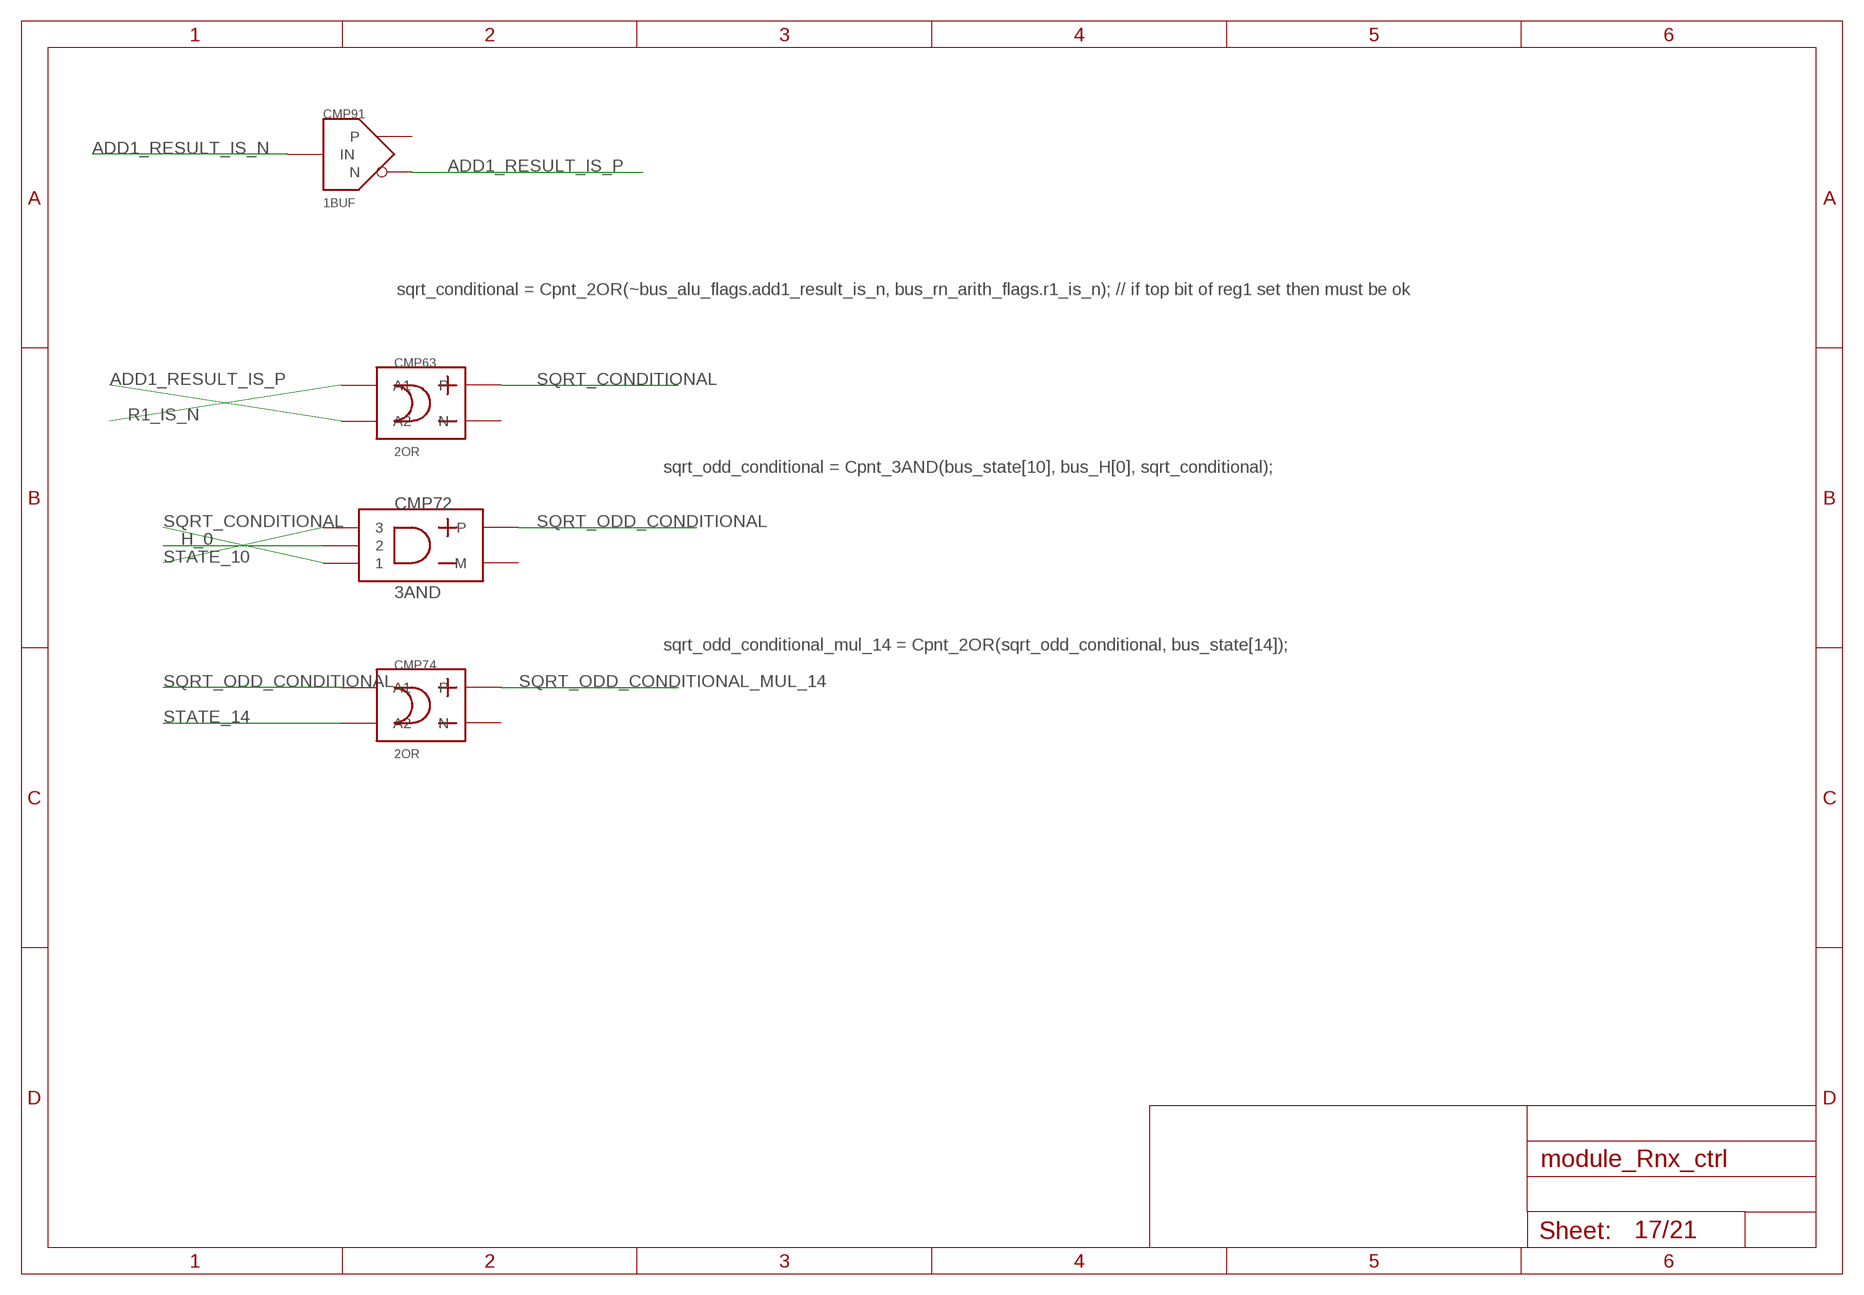
[diagram p16: schematic, sheet 17]

### Parts
CMP63  2OR  [2OR]
CMP72  3AND  [3AND]
CMP74  2OR  [2OR]
CMP91  1BUF  [1BUF]

### Nets
ADD1_RESULT_IS_N: CMP91.IN ; also sheet 2
ADD1_RESULT_IS_P: CMP63.P$1(A2) CMP91.N
H_0: CMP72.P$2 ; also sheet 1,6,7
R1_IS_N: CMP63.P$2(A1) ; also sheet 2,8
SQRT_CONDITIONAL: CMP63.OUT_P(P) CMP72.P$1
SQRT_ODD_CONDITIONAL: CMP72.OUT_P(P) CMP74.P$2(A1) ; also sheet 18
SQRT_ODD_CONDITIONAL_MUL_14: CMP74.OUT_P(P) ; also sheet 18
STATE_10: CMP72.P$3 ; also sheet 1,7
STATE_14: CMP74.P$1(A2) ; also sheet 1,15
Unconnected: CMP63.OUT_M(N) CMP72.OUT_M(M) CMP74.OUT_M(N) CMP91.P

### Notes on the sheet
- sqrt_conditional = Cpnt_2OR(~bus_alu_flags.add1_result_is_n, bus_rn_arith_flags.r1_is_n); // if top bit of reg1 set then must be ok
- sqrt_odd_conditional = Cpnt_3AND(bus_state[10], bus_H[0], sqrt_conditional);
- sqrt_odd_conditional_mul_14 = Cpnt_2OR(sqrt_odd_conditional, bus_state[14]);

## Sheet 18 of 21
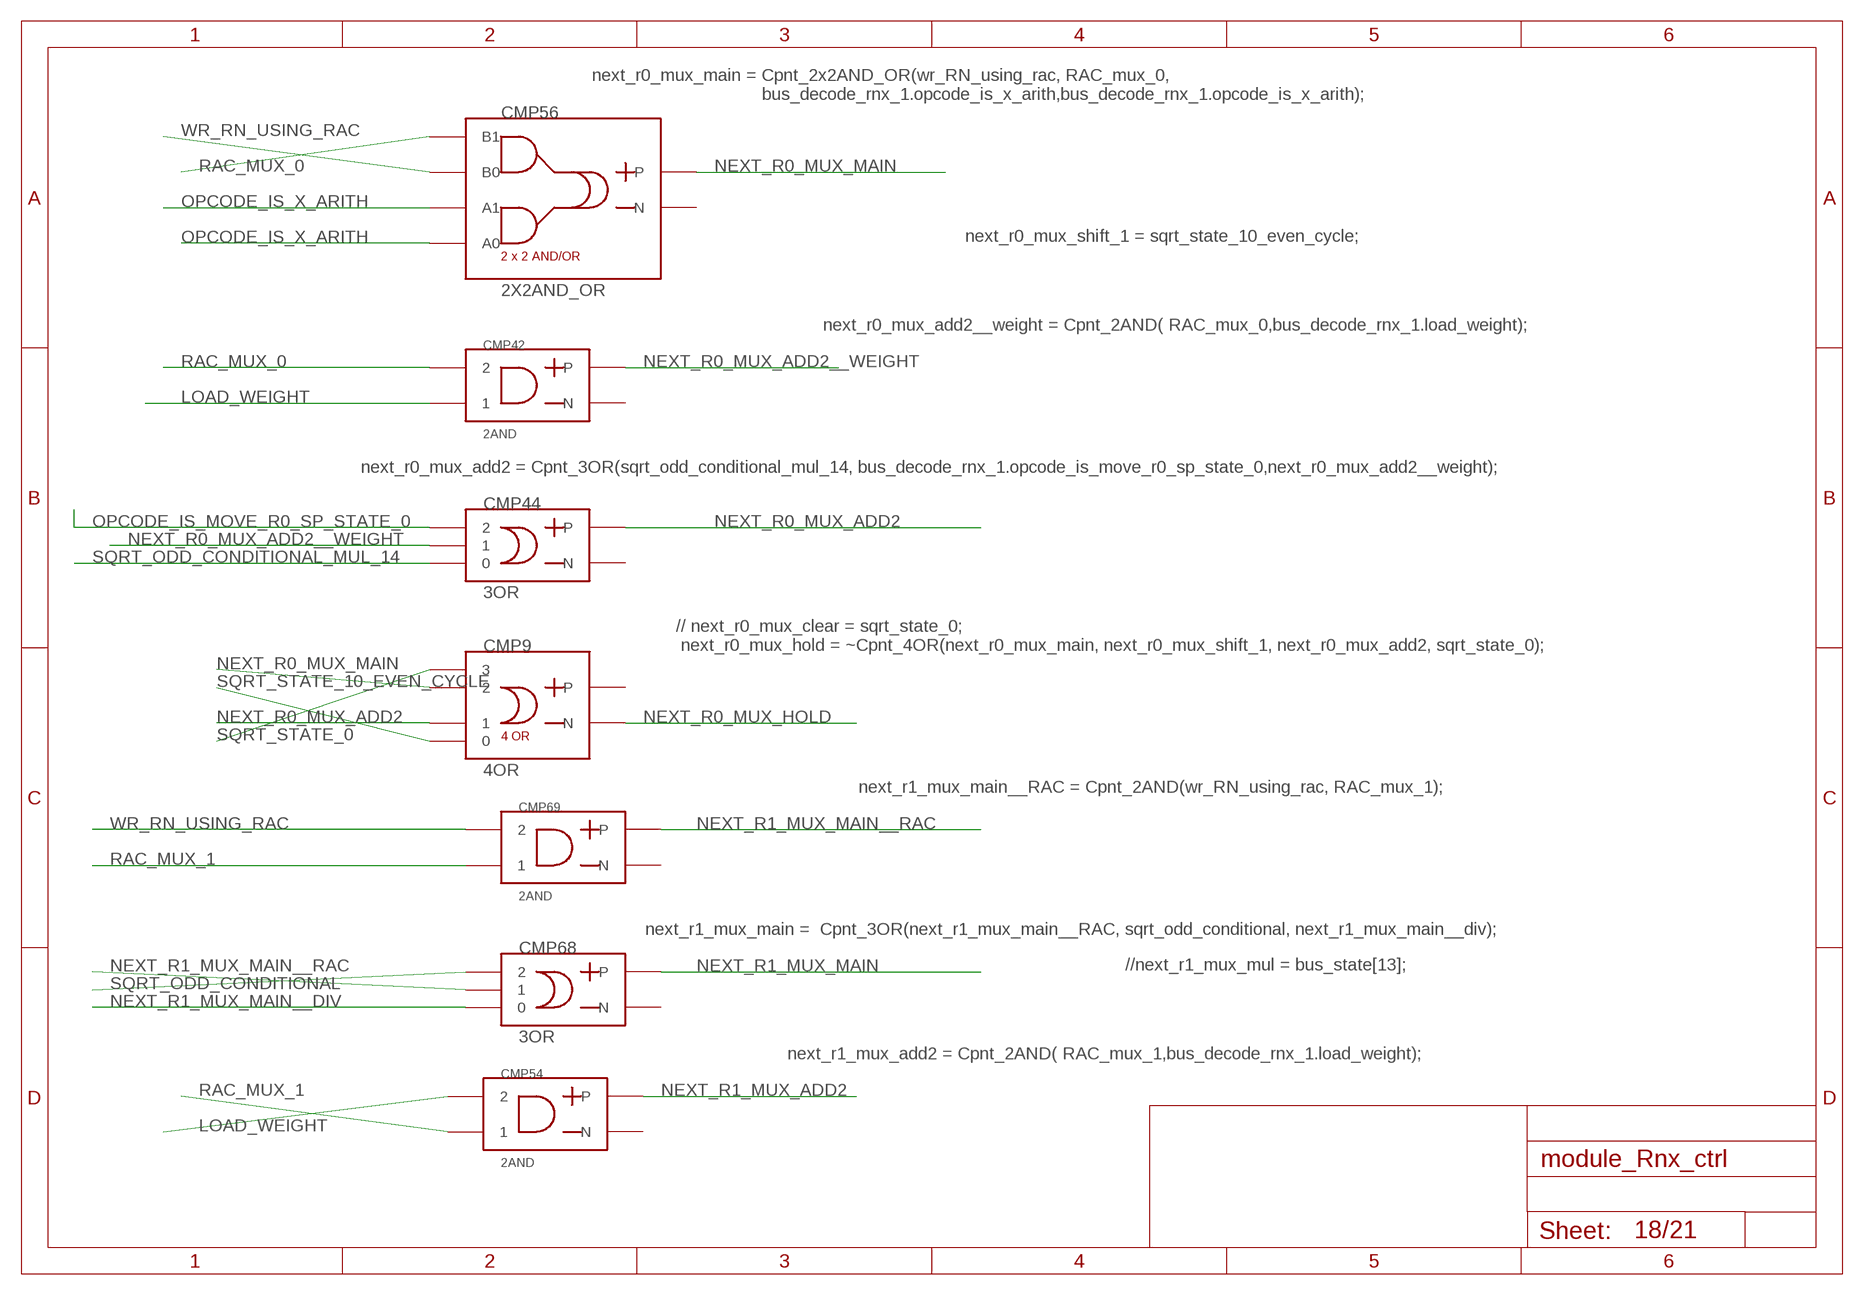
[diagram p17: schematic, sheet 18]

### Parts
CMP9  4OR  [4OR]
CMP42  2AND  [2AND]
CMP44  3OR  [3OR]
CMP54  2AND  [2AND]
CMP56  2X2AND_OR  [2X2AND_OR]
CMP68  3OR  [3OR]
CMP69  2AND  [2AND]

### Nets
LOAD_WEIGHT: CMP42.P$1 CMP54.P$2 ; also sheet 3,19,20
NEXT_R0_MUX_ADD2: CMP9.2 CMP44.OUT_P(P) ; also sheet 4
NEXT_R0_MUX_ADD2__WEIGHT: CMP42.OUT_P(P) CMP44.P$2
NEXT_R0_MUX_HOLD: CMP9.OUT_M(N) ; also sheet 4
NEXT_R0_MUX_MAIN: CMP9.3 CMP56.OUT_P(P) ; also sheet 4
NEXT_R1_MUX_ADD2: CMP54.OUT_P(P) ; also sheet 4,19
NEXT_R1_MUX_MAIN: CMP68.OUT_P(P) ; also sheet 4,19
NEXT_R1_MUX_MAIN__DIV: CMP68.P$1 ; also sheet 8
NEXT_R1_MUX_MAIN__RAC: CMP68.P$2 CMP69.OUT_P(P)
OPCODE_IS_MOVE_R0_SP_STATE_0: CMP44.P$3 ; also sheet 3,14
OPCODE_IS_X_ARITH: CMP56.P$1(A0) CMP56.P$2(A1) ; also sheet 3,16
RAC_MUX_0: CMP42.P$2 CMP56.P$4(B1) ; also sheet 4,10
RAC_MUX_1: CMP54.P$1 CMP69.P$1 ; also sheet 4,10
SQRT_ODD_CONDITIONAL: CMP68.P$3 ; also sheet 17
SQRT_ODD_CONDITIONAL_MUL_14: CMP44.P$1 ; also sheet 17
SQRT_STATE_0: CMP9.4 ; also sheet 7
SQRT_STATE_10_EVEN_CYCLE: CMP9.1 ; also sheet 4,7,21
WR_RN_USING_RAC: CMP56.P$3(B0) CMP69.P$2 ; also sheet 11,19,20
Unconnected: CMP9.OUT_P(P) CMP42.OUT_M(N) CMP44.OUT_M(N) CMP54.OUT_M(N) CMP56.OUT_M(N) CMP68.OUT_M(N) CMP69.OUT_M(N)

### Notes on the sheet
- next_r0_mux_main = Cpnt_2x2AND_OR(wr_RN_using_rac, RAC_mux_0,
                                        bus_decode_rnx_1.opcode_is_x_arith,bus_decode_rnx_1.opcode_is_x_arith);
- next_r0_mux_shift_1 = sqrt_state_10_even_cycle;
- next_r0_mux_add2__weight = Cpnt_2AND( RAC_mux_0,bus_decode_rnx_1.load_weight);
- next_r0_mux_add2 = Cpnt_3OR(sqrt_odd_conditional_mul_14, bus_decode_rnx_1.opcode_is_move_r0_sp_state_0,next_r0_mux_add2__weight);
- // next_r0_mux_clear = sqrt_state_0;
      next_r0_mux_hold = ~Cpnt_4OR(next_r0_mux_main, next_r0_mux_shift_1, next_r0_mux_add2, sqrt_state_0);
- next_r1_mux_main__RAC = Cpnt_2AND(wr_RN_using_rac, RAC_mux_1);
- next_r1_mux_main =  Cpnt_3OR(next_r1_mux_main__RAC, sqrt_odd_conditional, next_r1_mux_main__div);
- //next_r1_mux_mul = bus_state[13];
- next_r1_mux_add2 = Cpnt_2AND( RAC_mux_1,bus_decode_rnx_1.load_weight);

## Sheet 19 of 21
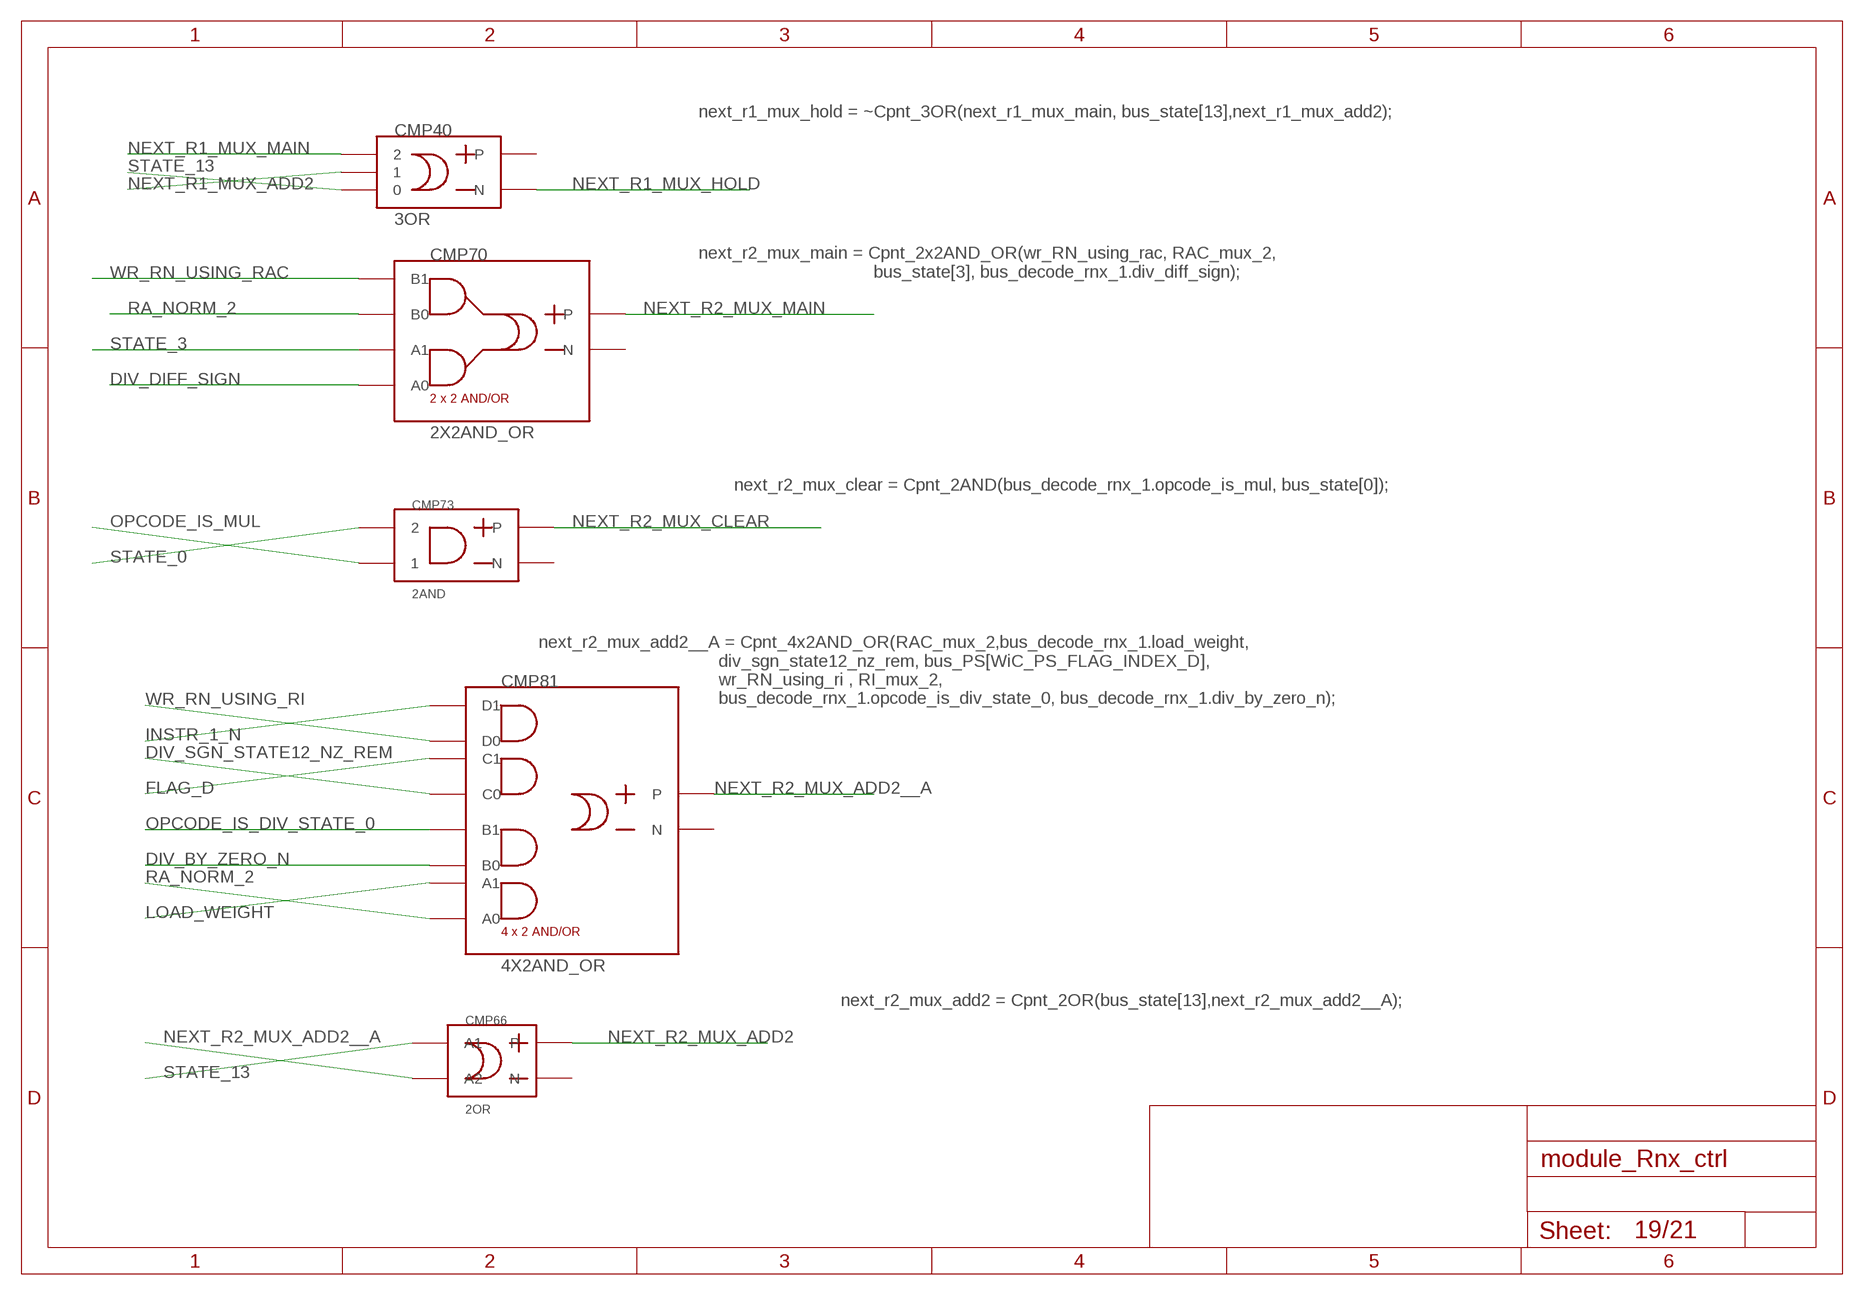
[diagram p18: schematic, sheet 19]

### Parts
CMP40  3OR  [3OR]
CMP66  2OR  [2OR]
CMP70  2X2AND_OR  [2X2AND_OR]
CMP73  2AND  [2AND]
CMP81  4X2AND_OR  [4X2AND_OR]

### Nets
DIV_BY_ZERO_N: CMP81.P$3(B0) ; also sheet 3,20
DIV_DIFF_SIGN: CMP70.P$1(A0) ; also sheet 3
DIV_SGN_STATE12_NZ_REM: CMP81.P$5(C0) ; also sheet 7,20
FLAG_D: CMP81.P$6(C1) ; also sheet 1,8
INSTR_1_N: CMP81.P$8(D1) ; also sheet 3,15
LOAD_WEIGHT: CMP81.P$2(A1) ; also sheet 3,18,20
NEXT_R1_MUX_ADD2: CMP40.P$2 ; also sheet 4,18
NEXT_R1_MUX_HOLD: CMP40.OUT_M(N) ; also sheet 4
NEXT_R1_MUX_MAIN: CMP40.P$3 ; also sheet 4,18
NEXT_R2_MUX_ADD2: CMP66.OUT_P(P) ; also sheet 4,20
NEXT_R2_MUX_ADD2__A: CMP66.P$1(A2) CMP81.OUT_P(P)
NEXT_R2_MUX_CLEAR: CMP73.OUT_P(P) ; also sheet 20
NEXT_R2_MUX_MAIN: CMP70.OUT_P(P) ; also sheet 4,20
OPCODE_IS_DIV_STATE_0: CMP81.P$4(B1) ; also sheet 3,20
OPCODE_IS_MUL: CMP73.P$1 ; also sheet 3,9,16,20
RA_NORM_2: CMP70.P$3(B0) CMP81.P$1(A0) ; also sheet 4,6
STATE_0: CMP73.P$2 ; also sheet 1,7,9,11,14,15,16,20
STATE_3: CMP70.P$2(A1) ; also sheet 1,8,12,20
STATE_13: CMP40.P$1 CMP66.P$2(A1) ; also sheet 1,4,9
WR_RN_USING_RAC: CMP70.P$4(B1) ; also sheet 11,18,20
WR_RN_USING_RI: CMP81.P$7(D0) ; also sheet 16,20
Unconnected: CMP40.OUT_P(P) CMP66.OUT_M(N) CMP70.OUT_M(N) CMP73.OUT_M(N) CMP81.OUT_M(N)

### Notes on the sheet
- next_r1_mux_hold = ~Cpnt_3OR(next_r1_mux_main, bus_state[13],next_r1_mux_add2);
- next_r2_mux_main = Cpnt_2x2AND_OR(wr_RN_using_rac, RAC_mux_2,
                                         bus_state[3], bus_decode_rnx_1.div_diff_sign);
- next_r2_mux_clear = Cpnt_2AND(bus_decode_rnx_1.opcode_is_mul, bus_state[0]);
- next_r2_mux_add2__A = Cpnt_4x2AND_OR(RAC_mux_2,bus_decode_rnx_1.load_weight,
                                          div_sgn_state12_nz_rem, bus_PS[WiC_PS_FLAG_INDEX_D],
                                          wr_RN_using_ri , RI_mux_2,
                                          bus_decode_rnx_1.opcode_is_div_state_0, bus_decode_rnx_1.div_by_zero_n);
- next_r2_mux_add2 = Cpnt_2OR(bus_state[13],next_r2_mux_add2__A);

## Sheet 20 of 21
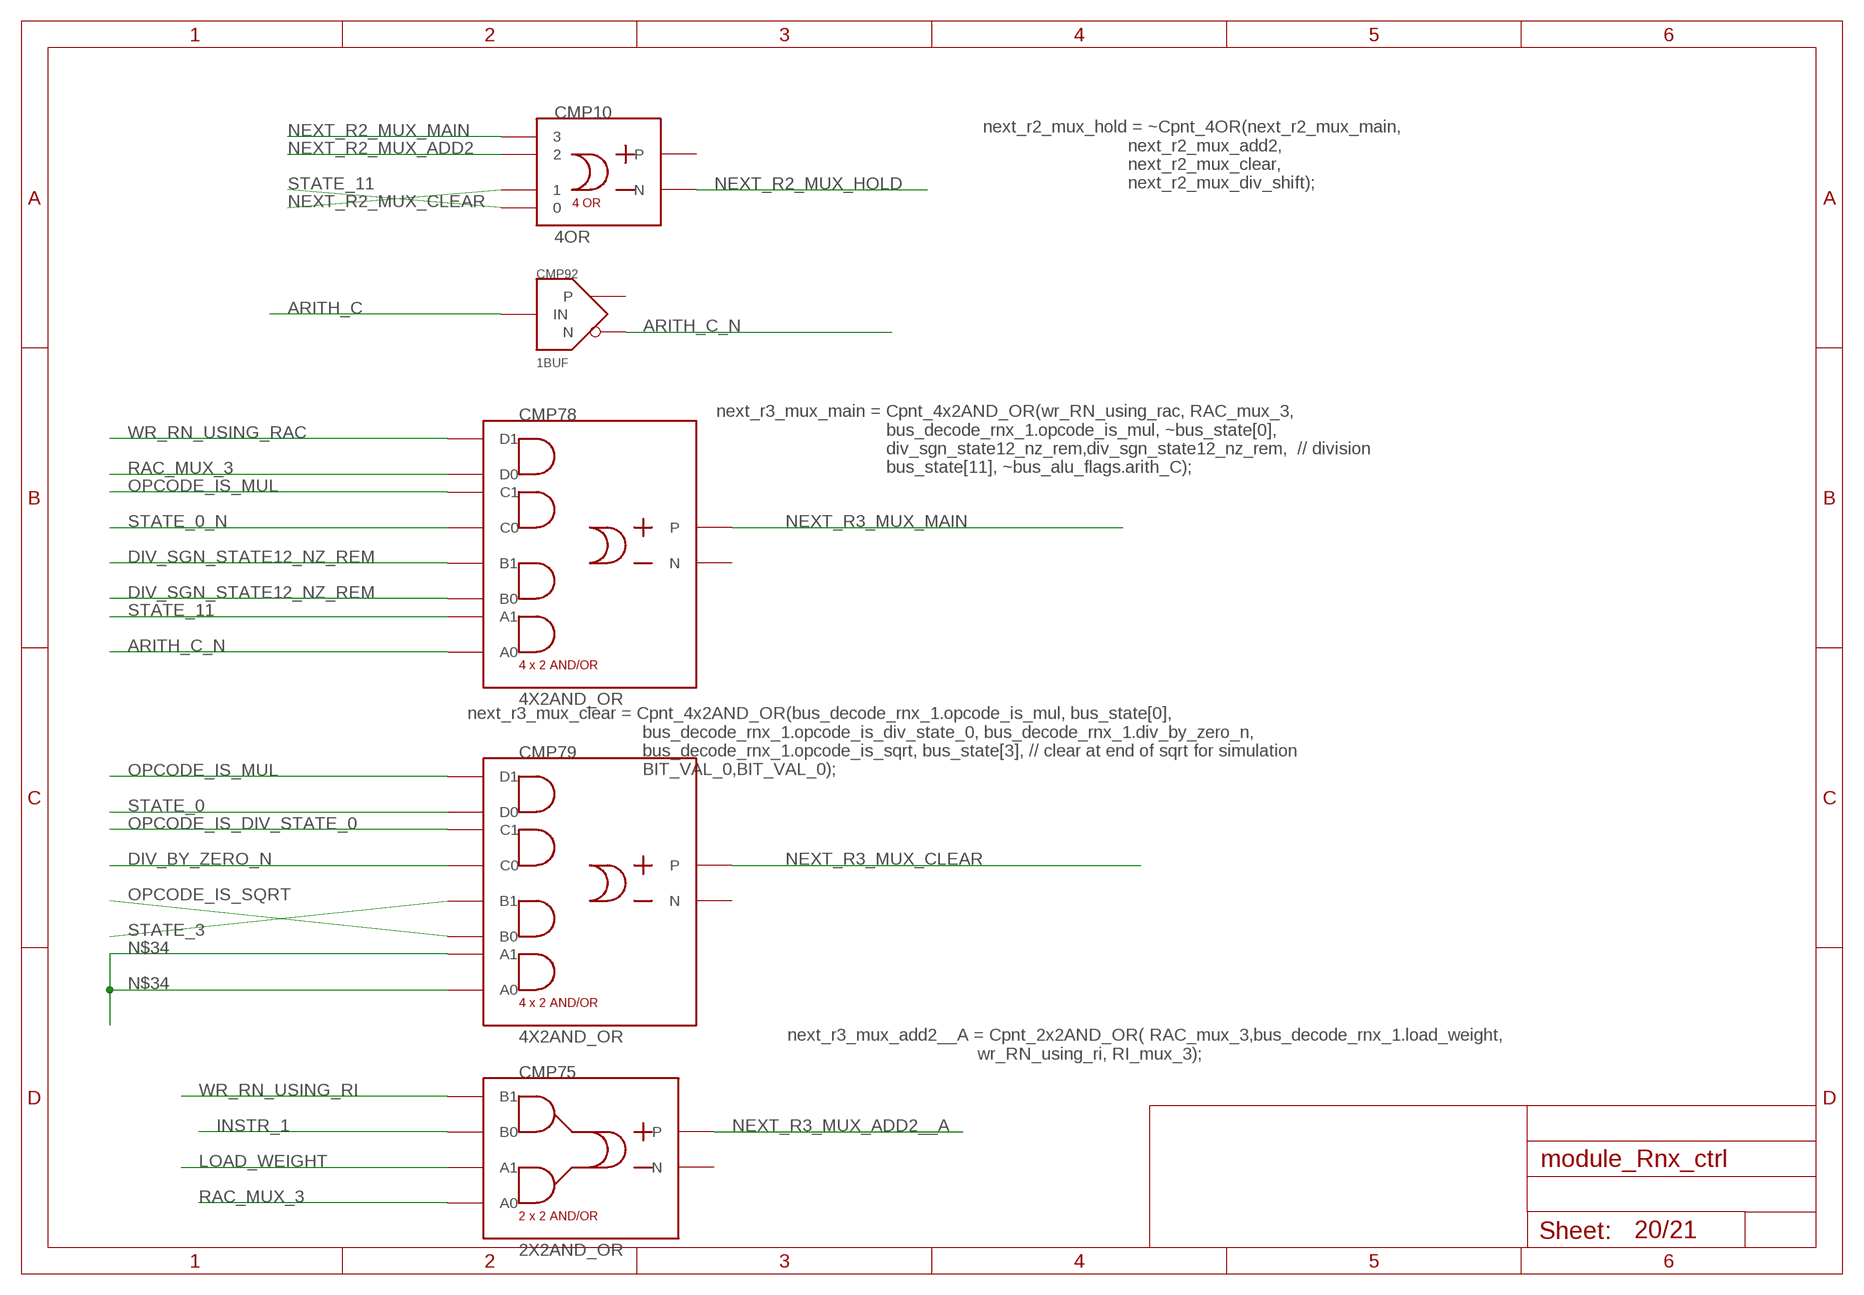
[diagram p19: schematic, sheet 20]

### Parts
CMP10  4OR  [4OR]
CMP75  2X2AND_OR  [2X2AND_OR]
CMP78  4X2AND_OR  [4X2AND_OR]
CMP79  4X2AND_OR  [4X2AND_OR]
CMP92  1BUF  [1BUF]

### Nets
ARITH_C: CMP92.IN ; also sheet 2,21
ARITH_C_N: CMP78.P$1(A0) CMP92.N ; also sheet 21
DIV_BY_ZERO_N: CMP79.P$5(C0) ; also sheet 3,19
DIV_SGN_STATE12_NZ_REM: CMP78.P$3(B0) CMP78.P$4(B1) ; also sheet 7,19
INSTR_1: CMP75.P$3(B0) ; also sheet 3,6,16
LOAD_WEIGHT: CMP75.P$2(A1) ; also sheet 3,18,19
N$34: CMP79.P$1(A0) CMP79.P$2(A1)
NEXT_R2_MUX_ADD2: CMP10.3 ; also sheet 4,19
NEXT_R2_MUX_CLEAR: CMP10.2 ; also sheet 19
NEXT_R2_MUX_HOLD: CMP10.OUT_M(N) ; also sheet 4
NEXT_R2_MUX_MAIN: CMP10.4 ; also sheet 4,19
NEXT_R3_MUX_ADD2__A: CMP75.OUT_P(P) ; also sheet 21
NEXT_R3_MUX_CLEAR: CMP79.OUT_P(P) ; also sheet 21
NEXT_R3_MUX_MAIN: CMP78.OUT_P(P) ; also sheet 4,21
OPCODE_IS_DIV_STATE_0: CMP79.P$6(C1) ; also sheet 3,19
OPCODE_IS_MUL: CMP78.P$6(C1) CMP79.P$8(D1) ; also sheet 3,9,16,19
OPCODE_IS_SQRT: CMP79.P$3(B0) ; also sheet 3,7,9,12,16
RAC_MUX_3: CMP75.P$1(A0) CMP78.P$7(D0) ; also sheet 4,10
STATE_0: CMP79.P$7(D0) ; also sheet 1,7,9,11,14,15,16,19
STATE_0_N: CMP78.P$5(C0) ; also sheet 9,16
STATE_3: CMP79.P$4(B1) ; also sheet 1,8,12,19
STATE_11: CMP10.1 CMP78.P$2(A1) ; also sheet 1,4,9,12,15,21
WR_RN_USING_RAC: CMP78.P$8(D1) ; also sheet 11,18,19
WR_RN_USING_RI: CMP75.P$4(B1) ; also sheet 16,19
Unconnected: CMP10.OUT_P(P) CMP75.OUT_M(N) CMP78.OUT_M(N) CMP79.OUT_M(N) CMP92.P

### Notes on the sheet
- next_r2_mux_hold = ~Cpnt_4OR(next_r2_mux_main,
                                   next_r2_mux_add2,
                                   next_r2_mux_clear,
                                   next_r2_mux_div_shift);
- next_r3_mux_main = Cpnt_4x2AND_OR(wr_RN_using_rac, RAC_mux_3,
                                        bus_decode_rnx_1.opcode_is_mul, ~bus_state[0],
                                        div_sgn_state12_nz_rem,div_sgn_state12_nz_rem,  // division
                                        bus_state[11], ~bus_alu_flags.arith_C);
- next_r3_mux_clear = Cpnt_4x2AND_OR(bus_decode_rnx_1.opcode_is_mul, bus_state[0], 
                                         bus_decode_rnx_1.opcode_is_div_state_0, bus_decode_rnx_1.div_by_zero_n,
                                         bus_decode_rnx_1.opcode_is_sqrt, bus_state[3], // clear at end of sqrt for simulation
                                         BIT_VAL_0,BIT_VAL_0);
- next_r3_mux_add2__A = Cpnt_2x2AND_OR( RAC_mux_3,bus_decode_rnx_1.load_weight,
                                            wr_RN_using_ri, RI_mux_3);

## Sheet 21 of 21
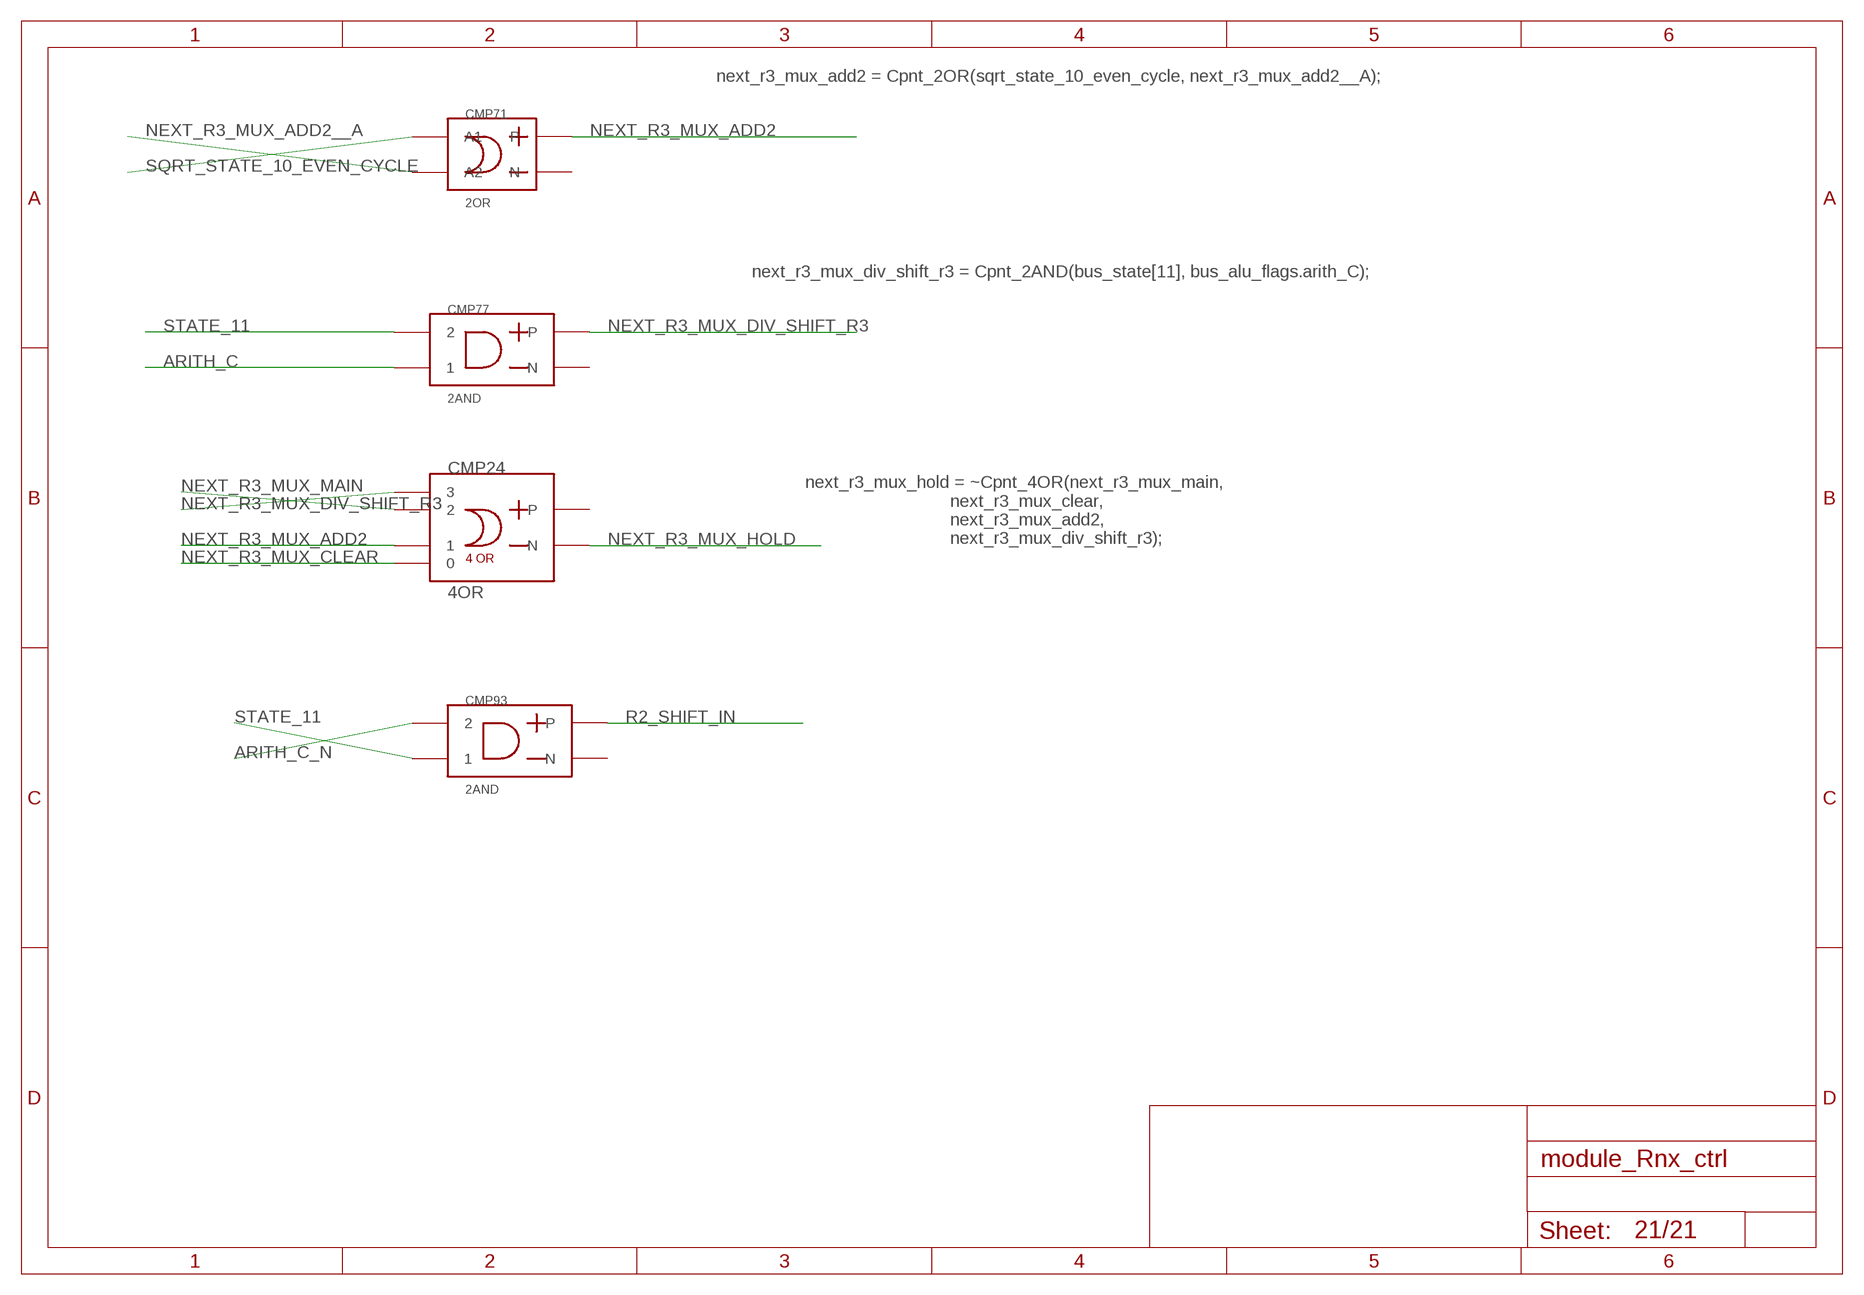
[diagram p20: schematic, sheet 21]

### Parts
CMP24  4OR  [4OR]
CMP71  2OR  [2OR]
CMP77  2AND  [2AND]
CMP93  2AND  [2AND]

### Nets
ARITH_C: CMP77.P$1 ; also sheet 2,20
ARITH_C_N: CMP93.P$2 ; also sheet 20
NEXT_R3_MUX_ADD2: CMP24.2 CMP71.OUT_P(P) ; also sheet 4
NEXT_R3_MUX_ADD2__A: CMP71.P$1(A2) ; also sheet 20
NEXT_R3_MUX_CLEAR: CMP24.1 ; also sheet 20
NEXT_R3_MUX_DIV_SHIFT_R3: CMP24.4 CMP77.OUT_P(P) ; also sheet 4
NEXT_R3_MUX_HOLD: CMP24.OUT_M(N) ; also sheet 4
NEXT_R3_MUX_MAIN: CMP24.3 ; also sheet 4,20
R2_SHIFT_IN: CMP93.OUT_P(P) ; also sheet 4
SQRT_STATE_10_EVEN_CYCLE: CMP71.P$2(A1) ; also sheet 4,7,18
STATE_11: CMP77.P$2 CMP93.P$1 ; also sheet 1,4,9,12,15,20
Unconnected: CMP24.OUT_P(P) CMP71.OUT_M(N) CMP77.OUT_M(N) CMP93.OUT_M(N)

### Notes on the sheet
- next_r3_mux_add2 = Cpnt_2OR(sqrt_state_10_even_cycle, next_r3_mux_add2__A);
- next_r3_mux_div_shift_r3 = Cpnt_2AND(bus_state[11], bus_alu_flags.arith_C);
- next_r3_mux_hold = ~Cpnt_4OR(next_r3_mux_main,
                                   next_r3_mux_clear,
                                   next_r3_mux_add2,
                                   next_r3_mux_div_shift_r3);

## Library data of the parts
CMP1 CMP6 CMP7 CMP15 CMP26 CMP27 CMP32 CMP37 CMP41 CMP47 CMP62 CMP63 CMP66 CMP71 CMP74 = modules:2OR
CMP2 CMP5 CMP20 CMP45 CMP56 CMP58 CMP59 CMP64 CMP70 CMP75 CMP80 = modules:2X2AND_OR
CMP3 CMP4 CMP9 CMP10 CMP24 = modules:4OR
CMP8 CMP12 CMP14 CMP19 CMP29 CMP30 CMP35 CMP36 CMP40 CMP43 CMP44 CMP68 = modules:3OR
CMP11 CMP18 CMP57 CMP65 CMP86 CMP87 CMP96 CMP97 = modules:BUS_SPLIT_DISPLAY
CMP13 CMP61 CMP82 = modules:5OR
CMP16 CMP17 CMP21-CMP23 CMP33 CMP34 CMP42 CMP46 CMP54 CMP67 CMP69 CMP73 CMP76 CMP77 CMP84 CMP93 = modules:2AND
CMP25 CMP52 CMP89 CMP99 = modules:BUS_CONSTRUCT_DISPLAY
CMP28 CMP53 CMP72 CMP85 = modules:3AND
CMP31 CMP48 CMP49 CMP55 CMP83 CMP90-CMP92 = modules:1BUF
CMP38 CMP39 CMP51 CMP88 = modules:DECODER4
CMP50 = modules:2X3AND_OR
CMP60 = modules:4AND
CMP78 CMP79 CMP81 = modules:4X2AND_OR